# EAGLE schematic main (EAGLE 8.0.0), part 1 of 4

## Sheet 1 of 48: Booth Encoder 0, 1
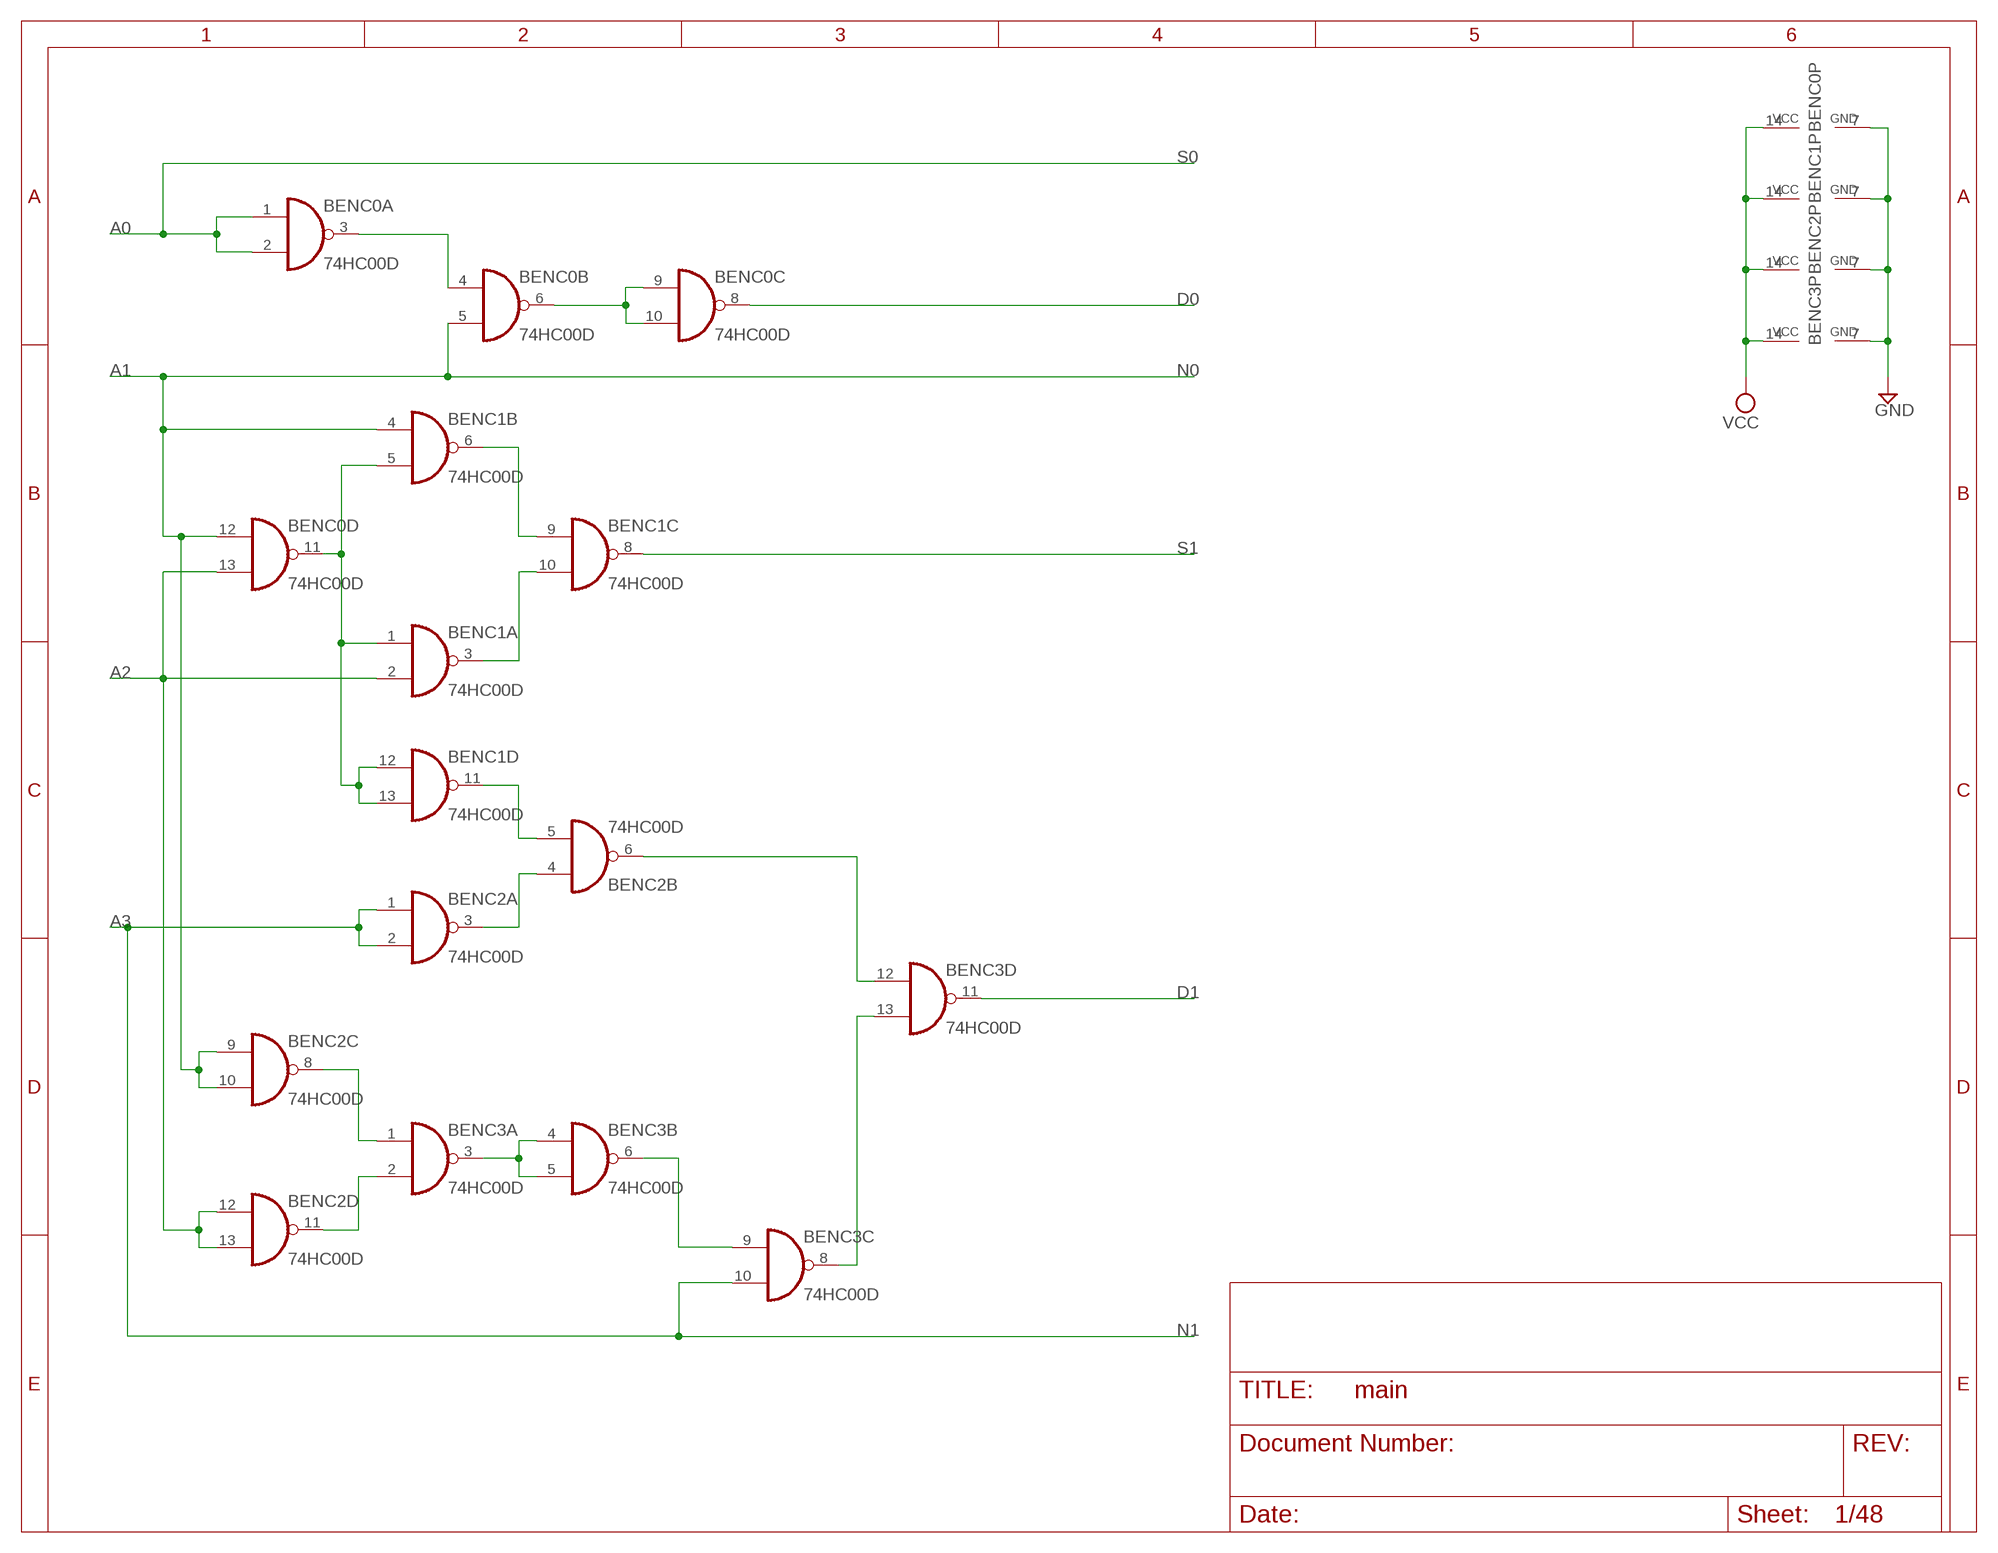
[diagram p0: schematic, sheet 1]

### Parts
BENC0  74HC00D  [SO14]
BENC1  74HC00D  [SO14]
BENC2  74HC00D  [SO14]
BENC3  74HC00D  [SO14]

### Nets
A0: BENC0.1(A:I0) BENC0.2(A:I1) ; also sheet 3,4,11,24,25,26,30,34,41
A1: BENC0.5(B:I1) BENC0.12(D:I0) BENC1.4(B:I0) BENC2.9(C:I0) BENC2.10(C:I1) ; also sheet 3,4,11,19,24,25,26,30,34,41
A2: BENC0.13(D:I1) BENC1.2(A:I1) BENC2.12(D:I0) BENC2.13(D:I1) ; also sheet 24,25,26,30,34,41
A3: BENC2.1(A:I0) BENC2.2(A:I1) BENC3.10(C:I1) ; also sheet 2,5,6,11,22,24,25,26,30,34,41
D0: BENC0.8(C:O) ; also sheet 3,4
D1: BENC3.11(D:O) ; also sheet 5,6
GND: BENC0.7(P:GND) BENC1.7(P:GND) BENC2.7(P:GND) BENC3.7(P:GND) ; also sheet 2,3,4,5,6,7,8,9,10,11,12,13,14,15,16,17,18,19,20,21,22,23,24,25,26,27,28,29,30,31,32,33,34,37,38,39,40,41,42,43,44,45,46,47
N$1: BENC0.3(A:O) BENC0.4(B:I0)
N$2: BENC0.6(B:O) BENC0.9(C:I0) BENC0.10(C:I1)
N$3: BENC2.6(B:O) BENC3.12(D:I0)
N$5: BENC1.3(A:O) BENC1.10(C:I1)
N$6: BENC1.6(B:O) BENC1.9(C:I0)
N$8: BENC3.8(C:O) BENC3.13(D:I1)
N$11: BENC2.3(A:O) BENC2.4(B:I0)
N$12: BENC1.11(D:O) BENC2.5(B:I1)
N$14: BENC2.11(D:O) BENC3.2(A:I1)
N$15: BENC2.8(C:O) BENC3.1(A:I0)
N$16: BENC3.3(A:O) BENC3.4(B:I0) BENC3.5(B:I1)
N$17: BENC3.6(B:O) BENC3.9(C:I0)
N$19: BENC0.11(D:O) BENC1.1(A:I0) BENC1.5(B:I1) BENC1.12(D:I0) BENC1.13(D:I1)
S1: BENC1.8(C:O) ; also sheet 5,6,11
VCC: BENC0.14(P:VCC) BENC1.14(P:VCC) BENC2.14(P:VCC) BENC3.14(P:VCC) ; also sheet 2,3,4,5,6,7,8,9,10,11,12,13,14,15,16,17,18,19,20,21,22,23,24,25,26,27,28,29,30,31,32,33,34,37,38,39,40,41,42,43,44,45,46,47

### Notes on the sheet
- S0
- N0
- N1

## Sheet 2 of 48: Booth Encoder 2, 3
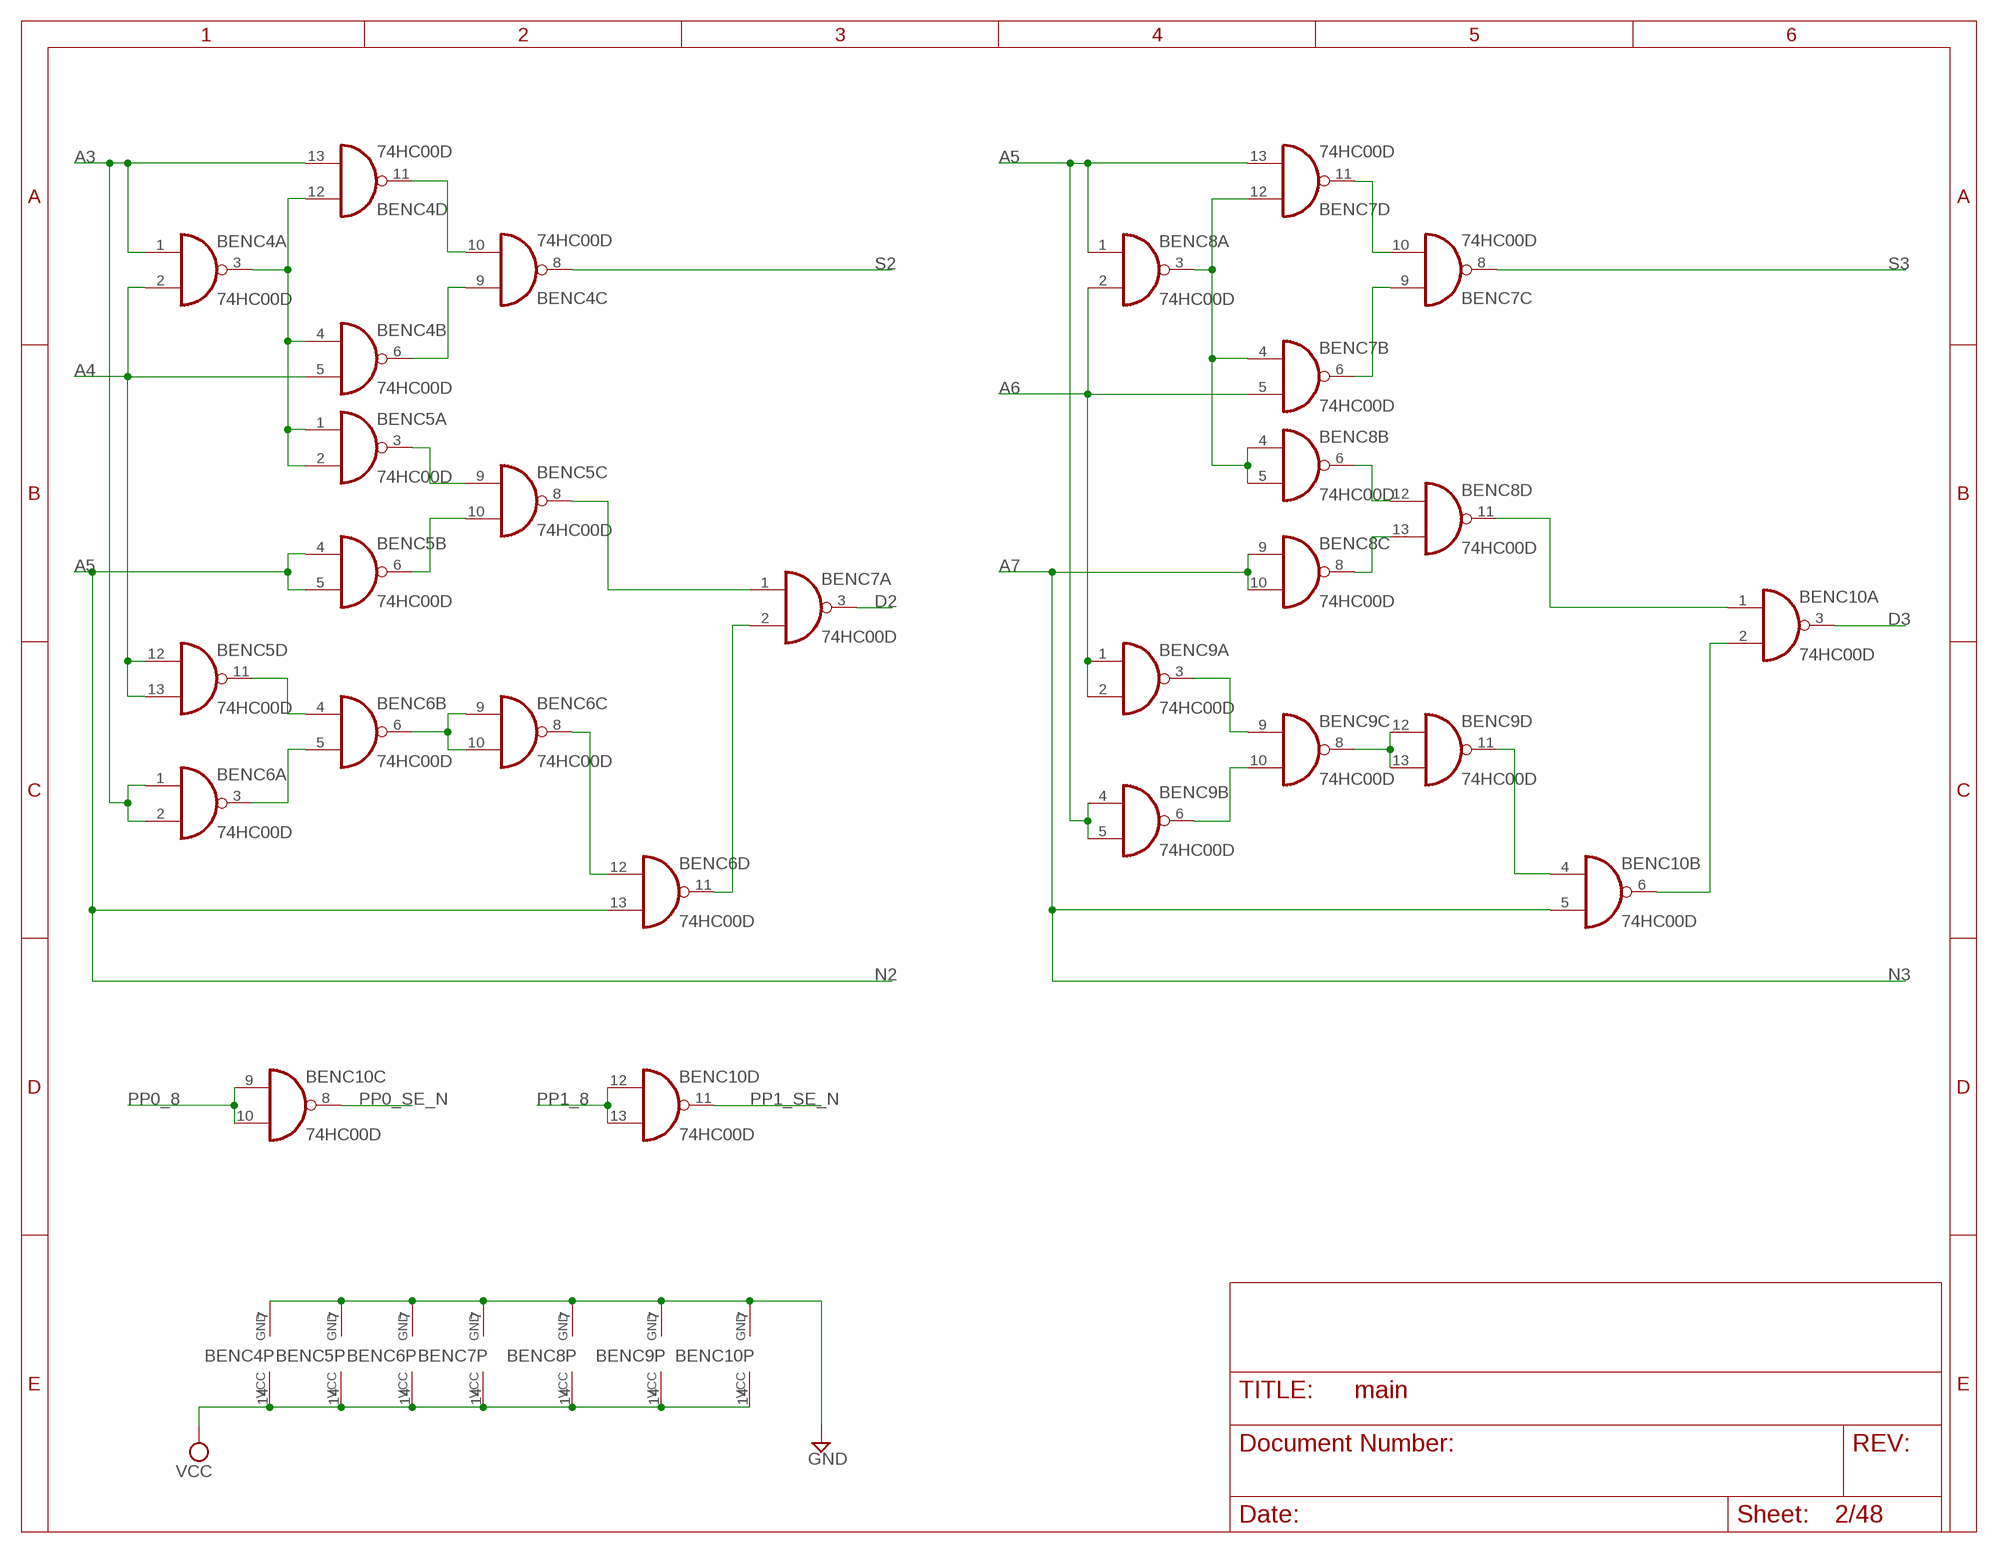
[diagram p1: schematic, sheet 2]

### Parts
BENC4  74HC00D  [SO14]
BENC5  74HC00D  [SO14]
BENC6  74HC00D  [SO14]
BENC7  74HC00D  [SO14]
BENC8  74HC00D  [SO14]
BENC9  74HC00D  [SO14]
BENC10  74HC00D  [SO14]

### Nets
A3: BENC4.1(A:I0) BENC4.13(D:I1) BENC6.1(A:I0) BENC6.2(A:I1) ; also sheet 1,5,6,11,22,24,25,26,30,34,41
A4: BENC4.2(A:I1) BENC4.5(B:I1) BENC5.12(D:I0) BENC5.13(D:I1) ; also sheet 24,25,27,30,34,40
A5: BENC5.4(B:I0) BENC5.5(B:I1) BENC6.13(D:I1) BENC7.13(D:I1) BENC8.1(A:I0) BENC9.4(B:I0) BENC9.5(B:I1) ; also sheet 7,8,11,16,24,25,27,30,34,40
A6: BENC7.5(B:I1) BENC8.2(A:I1) BENC9.1(A:I0) BENC9.2(A:I1) ; also sheet 24,25,27,30,34,40
A7: BENC8.9(C:I0) BENC8.10(C:I1) BENC10.5(B:I1) ; also sheet 9,10,11,15,24,25,27,30,34,40
D2: BENC7.3(A:O) ; also sheet 7,8
D3: BENC10.3(A:O) ; also sheet 9,10
GND: BENC4.7(P:GND) BENC5.7(P:GND) BENC6.7(P:GND) BENC7.7(P:GND) BENC8.7(P:GND) BENC9.7(P:GND) BENC10.7(P:GND) ; also sheet 1,3,4,5,6,7,8,9,10,11,12,13,14,15,16,17,18,19,20,21,22,23,24,25,26,27,28,29,30,31,32,33,34,37,38,39,40,41,42,43,44,45,46,47
N$4: BENC4.3(A:O) BENC4.4(B:I0) BENC4.12(D:I0) BENC5.1(A:I0) BENC5.2(A:I1)
N$7: BENC4.6(B:O) BENC4.9(C:I0)
N$9: BENC4.10(C:I1) BENC4.11(D:O)
N$18: BENC6.11(D:O) BENC7.2(A:I1)
N$20: BENC5.3(A:O) BENC5.9(C:I0)
N$21: BENC5.6(B:O) BENC5.10(C:I1)
N$23: BENC5.8(C:O) BENC7.1(A:I0)
N$24: BENC6.6(B:O) BENC6.9(C:I0) BENC6.10(C:I1)
N$25: BENC6.8(C:O) BENC6.12(D:I0)
N$26: BENC5.11(D:O) BENC6.4(B:I0)
N$27: BENC6.3(A:O) BENC6.5(B:I1)
N$35: BENC7.10(C:I1) BENC7.11(D:O)
N$36: BENC7.6(B:O) BENC7.9(C:I0)
N$39: BENC7.4(B:I0) BENC7.12(D:I0) BENC8.3(A:O) BENC8.4(B:I0) BENC8.5(B:I1)
N$41: BENC8.8(C:O) BENC8.13(D:I1)
N$42: BENC8.6(B:O) BENC8.12(D:I0)
N$43: BENC8.11(D:O) BENC10.1(A:I0)
N$44: BENC10.2(A:I1) BENC10.6(B:O)
N$47: BENC9.11(D:O) BENC10.4(B:I0)
N$48: BENC9.8(C:O) BENC9.12(D:I0) BENC9.13(D:I1)
N$49: BENC9.6(B:O) BENC9.10(C:I1)
N$50: BENC9.3(A:O) BENC9.9(C:I0)
PP0_8: BENC10.9(C:I0) BENC10.10(C:I1) ; also sheet 3,12
PP0_SE_N: BENC10.8(C:O) ; also sheet 12
PP1_8: BENC10.12(D:I0) BENC10.13(D:I1) ; also sheet 5,12
PP1_SE_N: BENC10.11(D:O) ; also sheet 12
S2: BENC4.8(C:O) ; also sheet 7,8,11
S3: BENC7.8(C:O) ; also sheet 9,10,11
VCC: BENC4.14(P:VCC) BENC5.14(P:VCC) BENC6.14(P:VCC) BENC7.14(P:VCC) BENC8.14(P:VCC) BENC9.14(P:VCC) BENC10.14(P:VCC) ; also sheet 1,3,4,5,6,7,8,9,10,11,12,13,14,15,16,17,18,19,20,21,22,23,24,25,26,27,28,29,30,31,32,33,34,37,38,39,40,41,42,43,44,45,46,47

### Notes on the sheet
- N2 | N3

## Sheet 3 of 48: Booth Selector 0, 8-5
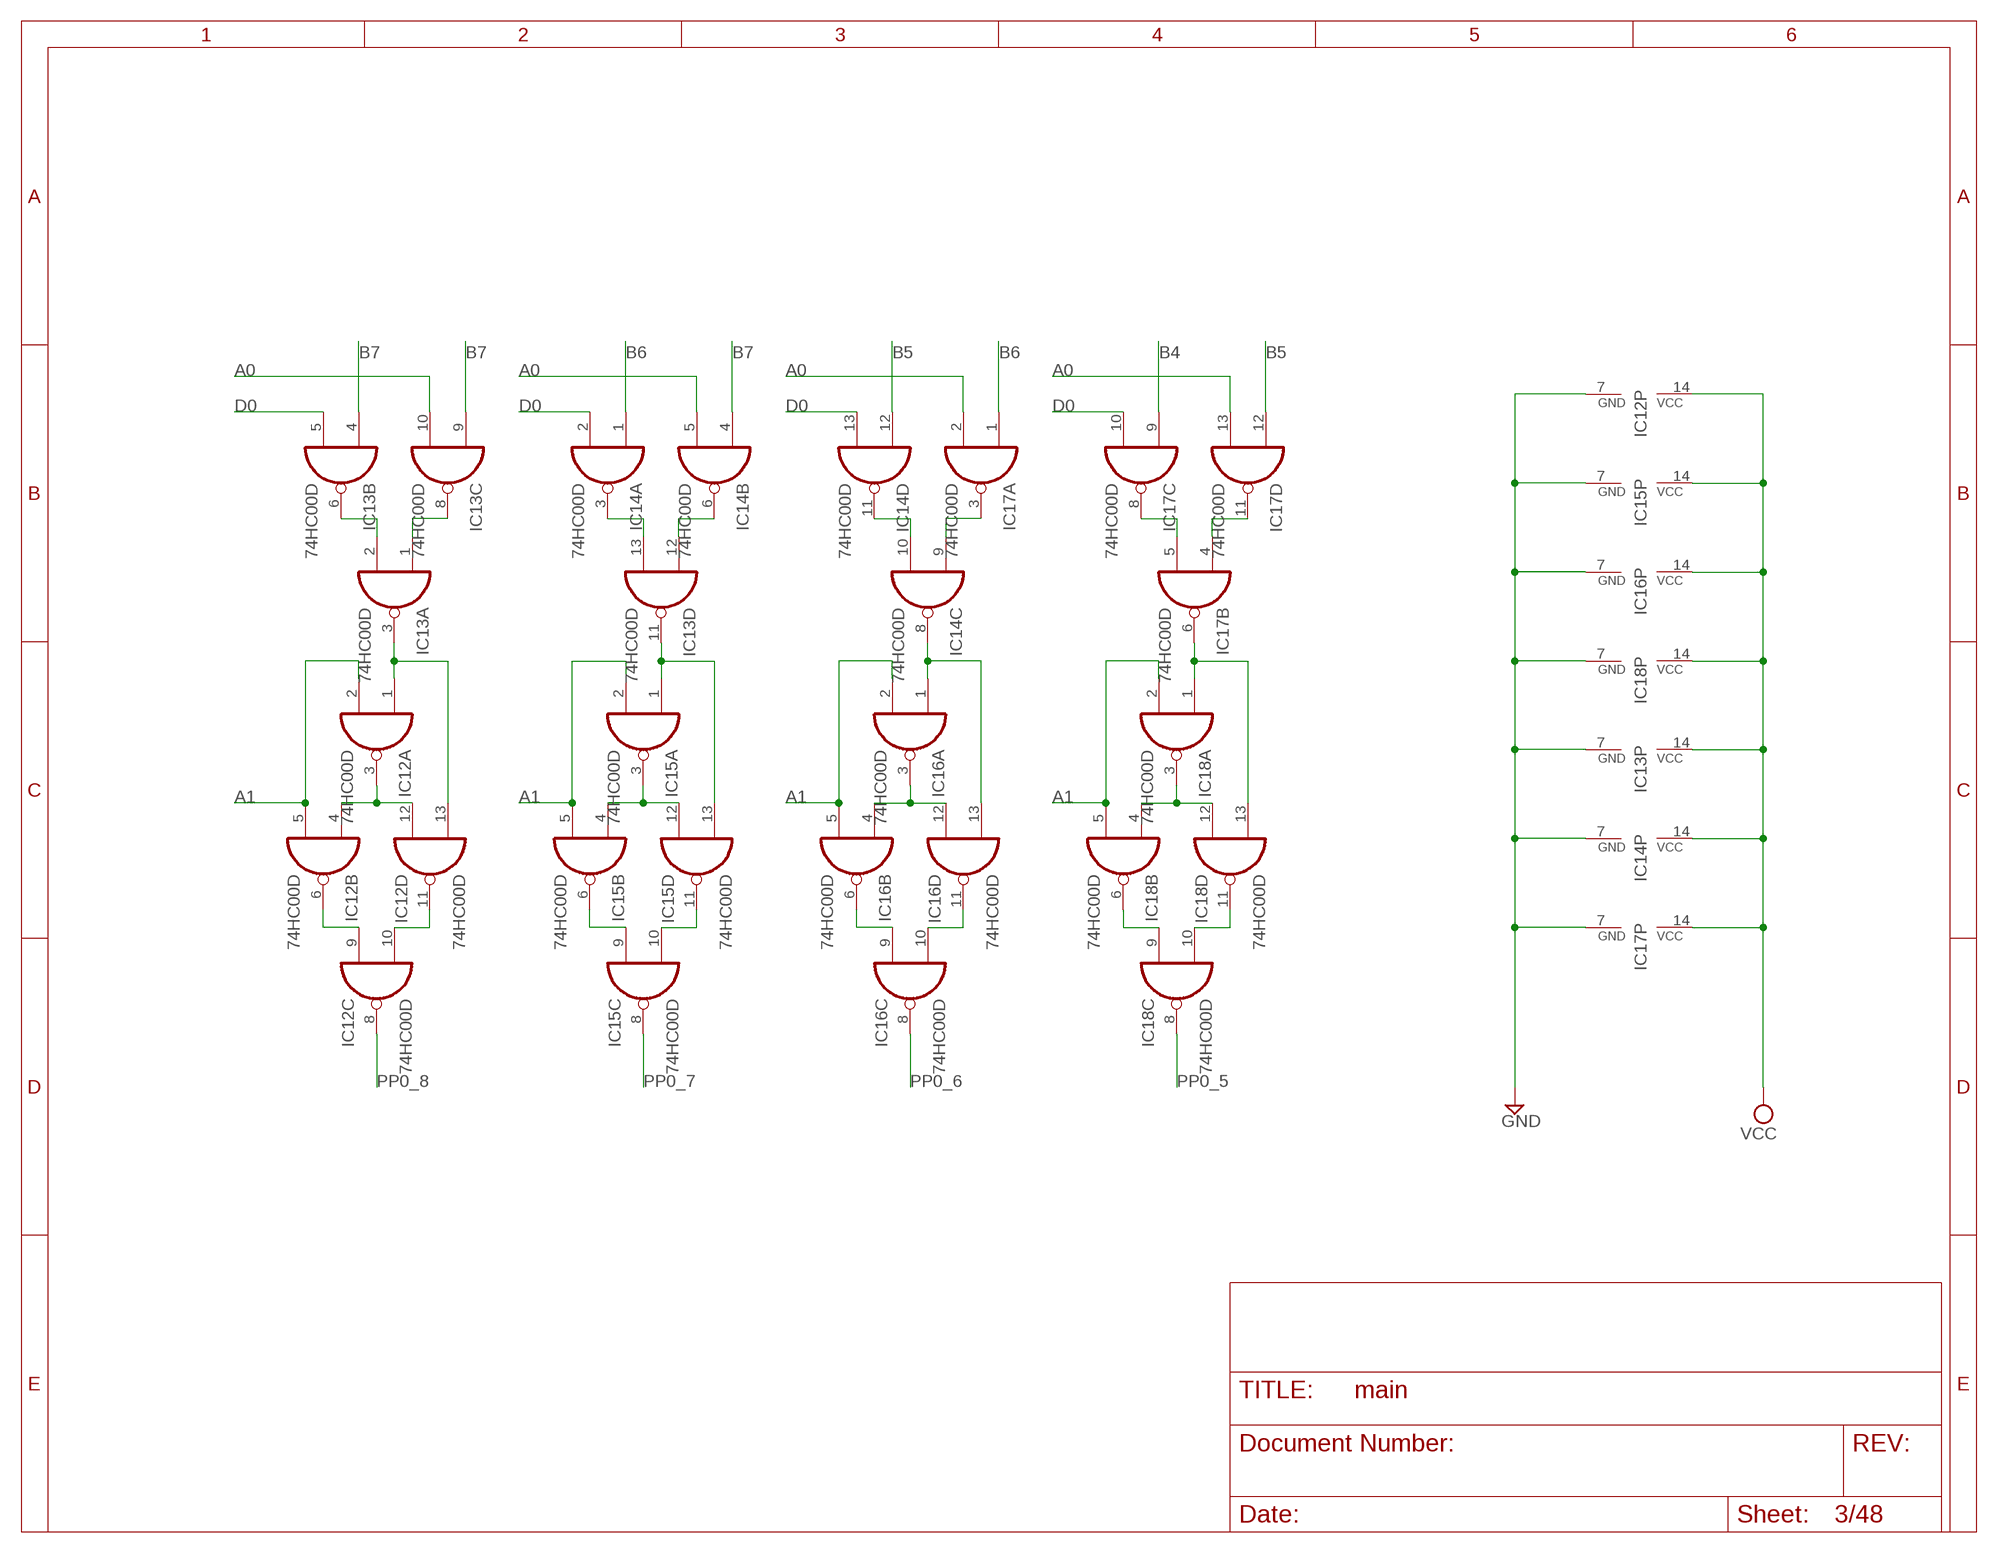
[diagram p2: schematic, sheet 3]

### Parts
IC12  74HC00D  [SO14]
IC13  74HC00D  [SO14]
IC14  74HC00D  [SO14]
IC15  74HC00D  [SO14]
IC16  74HC00D  [SO14]
IC17  74HC00D  [SO14]
IC18  74HC00D  [SO14]

### Nets
A0: IC13.10(C:I1) IC14.5(B:I1) IC17.2(A:I1) IC17.13(D:I1) ; also sheet 1,4,11,24,25,26,30,34,41
A1: IC12.2(A:I1) IC12.5(B:I1) IC15.2(A:I1) IC15.5(B:I1) IC16.2(A:I1) IC16.5(B:I1) IC18.2(A:I1) IC18.5(B:I1) ; also sheet 1,4,11,19,24,25,26,30,34,41
B4: IC17.9(C:I0) ; also sheet 4,5,6,7,8,9,10,24,25,27,34,42
B5: IC14.12(D:I0) IC17.12(D:I0) ; also sheet 5,7,9,24,25,27,34,42
B6: IC14.1(A:I0) IC17.1(A:I0) ; also sheet 5,7,9,24,25,27,34,42
B7: IC13.4(B:I0) IC13.9(C:I0) IC14.4(B:I0) ; also sheet 5,7,9,24,25,27,34,42
D0: IC13.5(B:I1) IC14.2(A:I1) IC14.13(D:I1) IC17.10(C:I1) ; also sheet 1,4
GND: IC12.7(P:GND) IC13.7(P:GND) IC14.7(P:GND) IC15.7(P:GND) IC16.7(P:GND) IC17.7(P:GND) IC18.7(P:GND) ; also sheet 1,2,4,5,6,7,8,9,10,11,12,13,14,15,16,17,18,19,20,21,22,23,24,25,26,27,28,29,30,31,32,33,34,37,38,39,40,41,42,43,44,45,46,47
N$88: IC12.6(B:O) IC12.9(C:I0)
N$89: IC12.10(C:I1) IC12.11(D:O)
N$90: IC12.3(A:O) IC12.4(B:I0) IC12.12(D:I0)
N$91: IC15.6(B:O) IC15.9(C:I0)
N$92: IC15.10(C:I1) IC15.11(D:O)
N$93: IC15.3(A:O) IC15.4(B:I0) IC15.12(D:I0)
N$94: IC16.3(A:O) IC16.4(B:I0) IC16.12(D:I0)
N$95: IC16.10(C:I1) IC16.11(D:O)
N$96: IC16.6(B:O) IC16.9(C:I0)
N$97: IC13.11(D:O) IC15.1(A:I0) IC15.13(D:I1)
N$98: IC13.13(D:I1) IC14.3(A:O)
N$99: IC13.12(D:I0) IC14.6(B:O)
N$100: IC13.1(A:I0) IC13.8(C:O)
N$101: IC13.2(A:I1) IC13.6(B:O)
N$102: IC14.10(C:I1) IC14.11(D:O)
N$103: IC14.9(C:I0) IC17.3(A:O)
N$104: IC17.5(B:I1) IC17.8(C:O)
N$105: IC17.4(B:I0) IC17.11(D:O)
N$106: IC17.6(B:O) IC18.1(A:I0) IC18.13(D:I1)
N$107: IC14.8(C:O) IC16.1(A:I0) IC16.13(D:I1)
N$108: IC12.1(A:I0) IC12.13(D:I1) IC13.3(A:O)
N$109: IC18.3(A:O) IC18.4(B:I0) IC18.12(D:I0)
N$110: IC18.6(B:O) IC18.9(C:I0)
N$111: IC18.10(C:I1) IC18.11(D:O)
PP0_5: IC18.8(C:O) ; also sheet 13
PP0_6: IC16.8(C:O) ; also sheet 13
PP0_7: IC15.8(C:O) ; also sheet 13
PP0_8: IC12.8(C:O) ; also sheet 2,12
VCC: IC12.14(P:VCC) IC13.14(P:VCC) IC14.14(P:VCC) IC15.14(P:VCC) IC16.14(P:VCC) IC17.14(P:VCC) IC18.14(P:VCC) ; also sheet 1,2,4,5,6,7,8,9,10,11,12,13,14,15,16,17,18,19,20,21,22,23,24,25,26,27,28,29,30,31,32,33,34,37,38,39,40,41,42,43,44,45,46,47

## Sheet 4 of 48: Booth Selector 0, 4-1
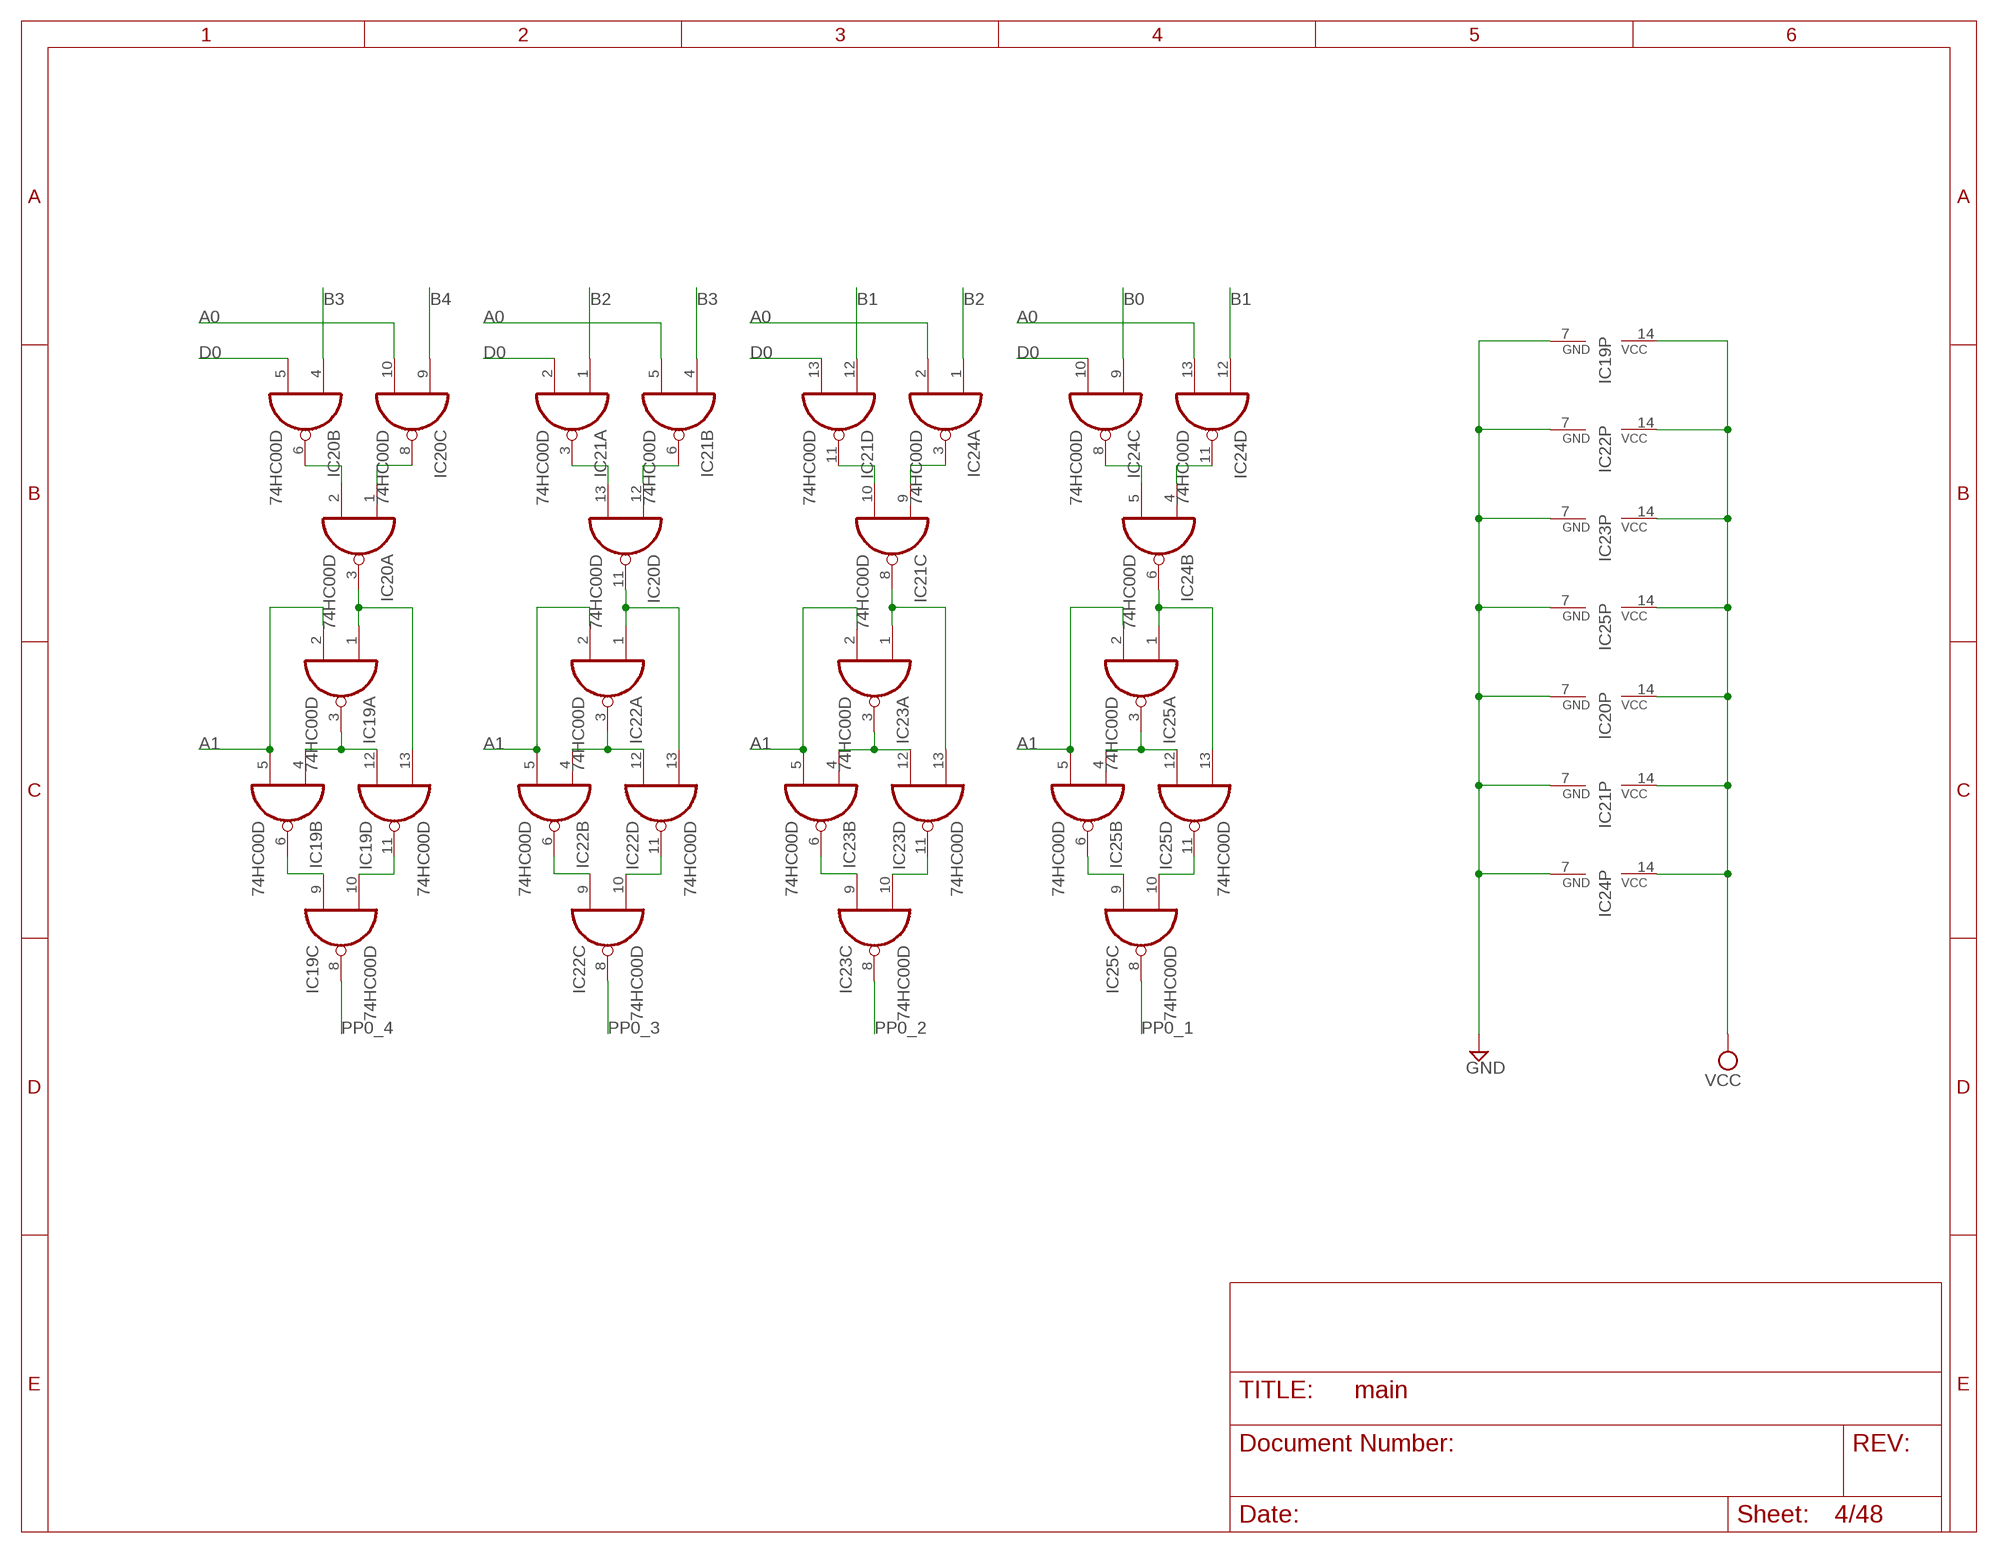
[diagram p3: schematic, sheet 4]

### Parts
IC19  74HC00D  [SO14]
IC20  74HC00D  [SO14]
IC21  74HC00D  [SO14]
IC22  74HC00D  [SO14]
IC23  74HC00D  [SO14]
IC24  74HC00D  [SO14]
IC25  74HC00D  [SO14]

### Nets
A0: IC20.10(C:I1) IC21.5(B:I1) IC24.2(A:I1) IC24.13(D:I1) ; also sheet 1,3,11,24,25,26,30,34,41
A1: IC19.2(A:I1) IC19.5(B:I1) IC22.2(A:I1) IC22.5(B:I1) IC23.2(A:I1) IC23.5(B:I1) IC25.2(A:I1) IC25.5(B:I1) ; also sheet 1,3,11,19,24,25,26,30,34,41
B0: IC24.9(C:I0) ; also sheet 6,8,10,11,24,25,26,34,43
B1: IC21.12(D:I0) IC24.12(D:I0) ; also sheet 6,8,10,24,25,26,34,43
B2: IC21.1(A:I0) IC24.1(A:I0) ; also sheet 6,8,10,24,25,26,34,43
B3: IC20.4(B:I0) IC21.4(B:I0) ; also sheet 6,8,10,24,25,26,34,43
B4: IC20.9(C:I0) ; also sheet 3,5,6,7,8,9,10,24,25,27,34,42
D0: IC20.5(B:I1) IC21.2(A:I1) IC21.13(D:I1) IC24.10(C:I1) ; also sheet 1,3
GND: IC19.7(P:GND) IC20.7(P:GND) IC21.7(P:GND) IC22.7(P:GND) IC23.7(P:GND) IC24.7(P:GND) IC25.7(P:GND) ; also sheet 1,2,3,5,6,7,8,9,10,11,12,13,14,15,16,17,18,19,20,21,22,23,24,25,26,27,28,29,30,31,32,33,34,37,38,39,40,41,42,43,44,45,46,47
N$112: IC19.6(B:O) IC19.9(C:I0)
N$113: IC19.10(C:I1) IC19.11(D:O)
N$114: IC19.3(A:O) IC19.4(B:I0) IC19.12(D:I0)
N$115: IC22.6(B:O) IC22.9(C:I0)
N$116: IC22.10(C:I1) IC22.11(D:O)
N$117: IC22.3(A:O) IC22.4(B:I0) IC22.12(D:I0)
N$118: IC23.3(A:O) IC23.4(B:I0) IC23.12(D:I0)
N$119: IC23.10(C:I1) IC23.11(D:O)
N$120: IC23.6(B:O) IC23.9(C:I0)
N$121: IC20.11(D:O) IC22.1(A:I0) IC22.13(D:I1)
N$122: IC20.13(D:I1) IC21.3(A:O)
N$123: IC20.12(D:I0) IC21.6(B:O)
N$124: IC20.1(A:I0) IC20.8(C:O)
N$125: IC20.2(A:I1) IC20.6(B:O)
N$126: IC21.10(C:I1) IC21.11(D:O)
N$127: IC21.9(C:I0) IC24.3(A:O)
N$128: IC24.5(B:I1) IC24.8(C:O)
N$129: IC24.4(B:I0) IC24.11(D:O)
N$130: IC24.6(B:O) IC25.1(A:I0) IC25.13(D:I1)
N$131: IC21.8(C:O) IC23.1(A:I0) IC23.13(D:I1)
N$132: IC19.1(A:I0) IC19.13(D:I1) IC20.3(A:O)
N$133: IC25.3(A:O) IC25.4(B:I0) IC25.12(D:I0)
N$134: IC25.6(B:O) IC25.9(C:I0)
N$135: IC25.10(C:I1) IC25.11(D:O)
PP0_1: IC25.8(C:O) ; also sheet 19,23
PP0_2: IC23.8(C:O) ; also sheet 16
PP0_3: IC22.8(C:O) ; also sheet 16
PP0_4: IC19.8(C:O) ; also sheet 13
VCC: IC19.14(P:VCC) IC20.14(P:VCC) IC21.14(P:VCC) IC22.14(P:VCC) IC23.14(P:VCC) IC24.14(P:VCC) IC25.14(P:VCC) ; also sheet 1,2,3,5,6,7,8,9,10,11,12,13,14,15,16,17,18,19,20,21,22,23,24,25,26,27,28,29,30,31,32,33,34,37,38,39,40,41,42,43,44,45,46,47

## Sheet 5 of 48: Booth Selector 1, 8-5
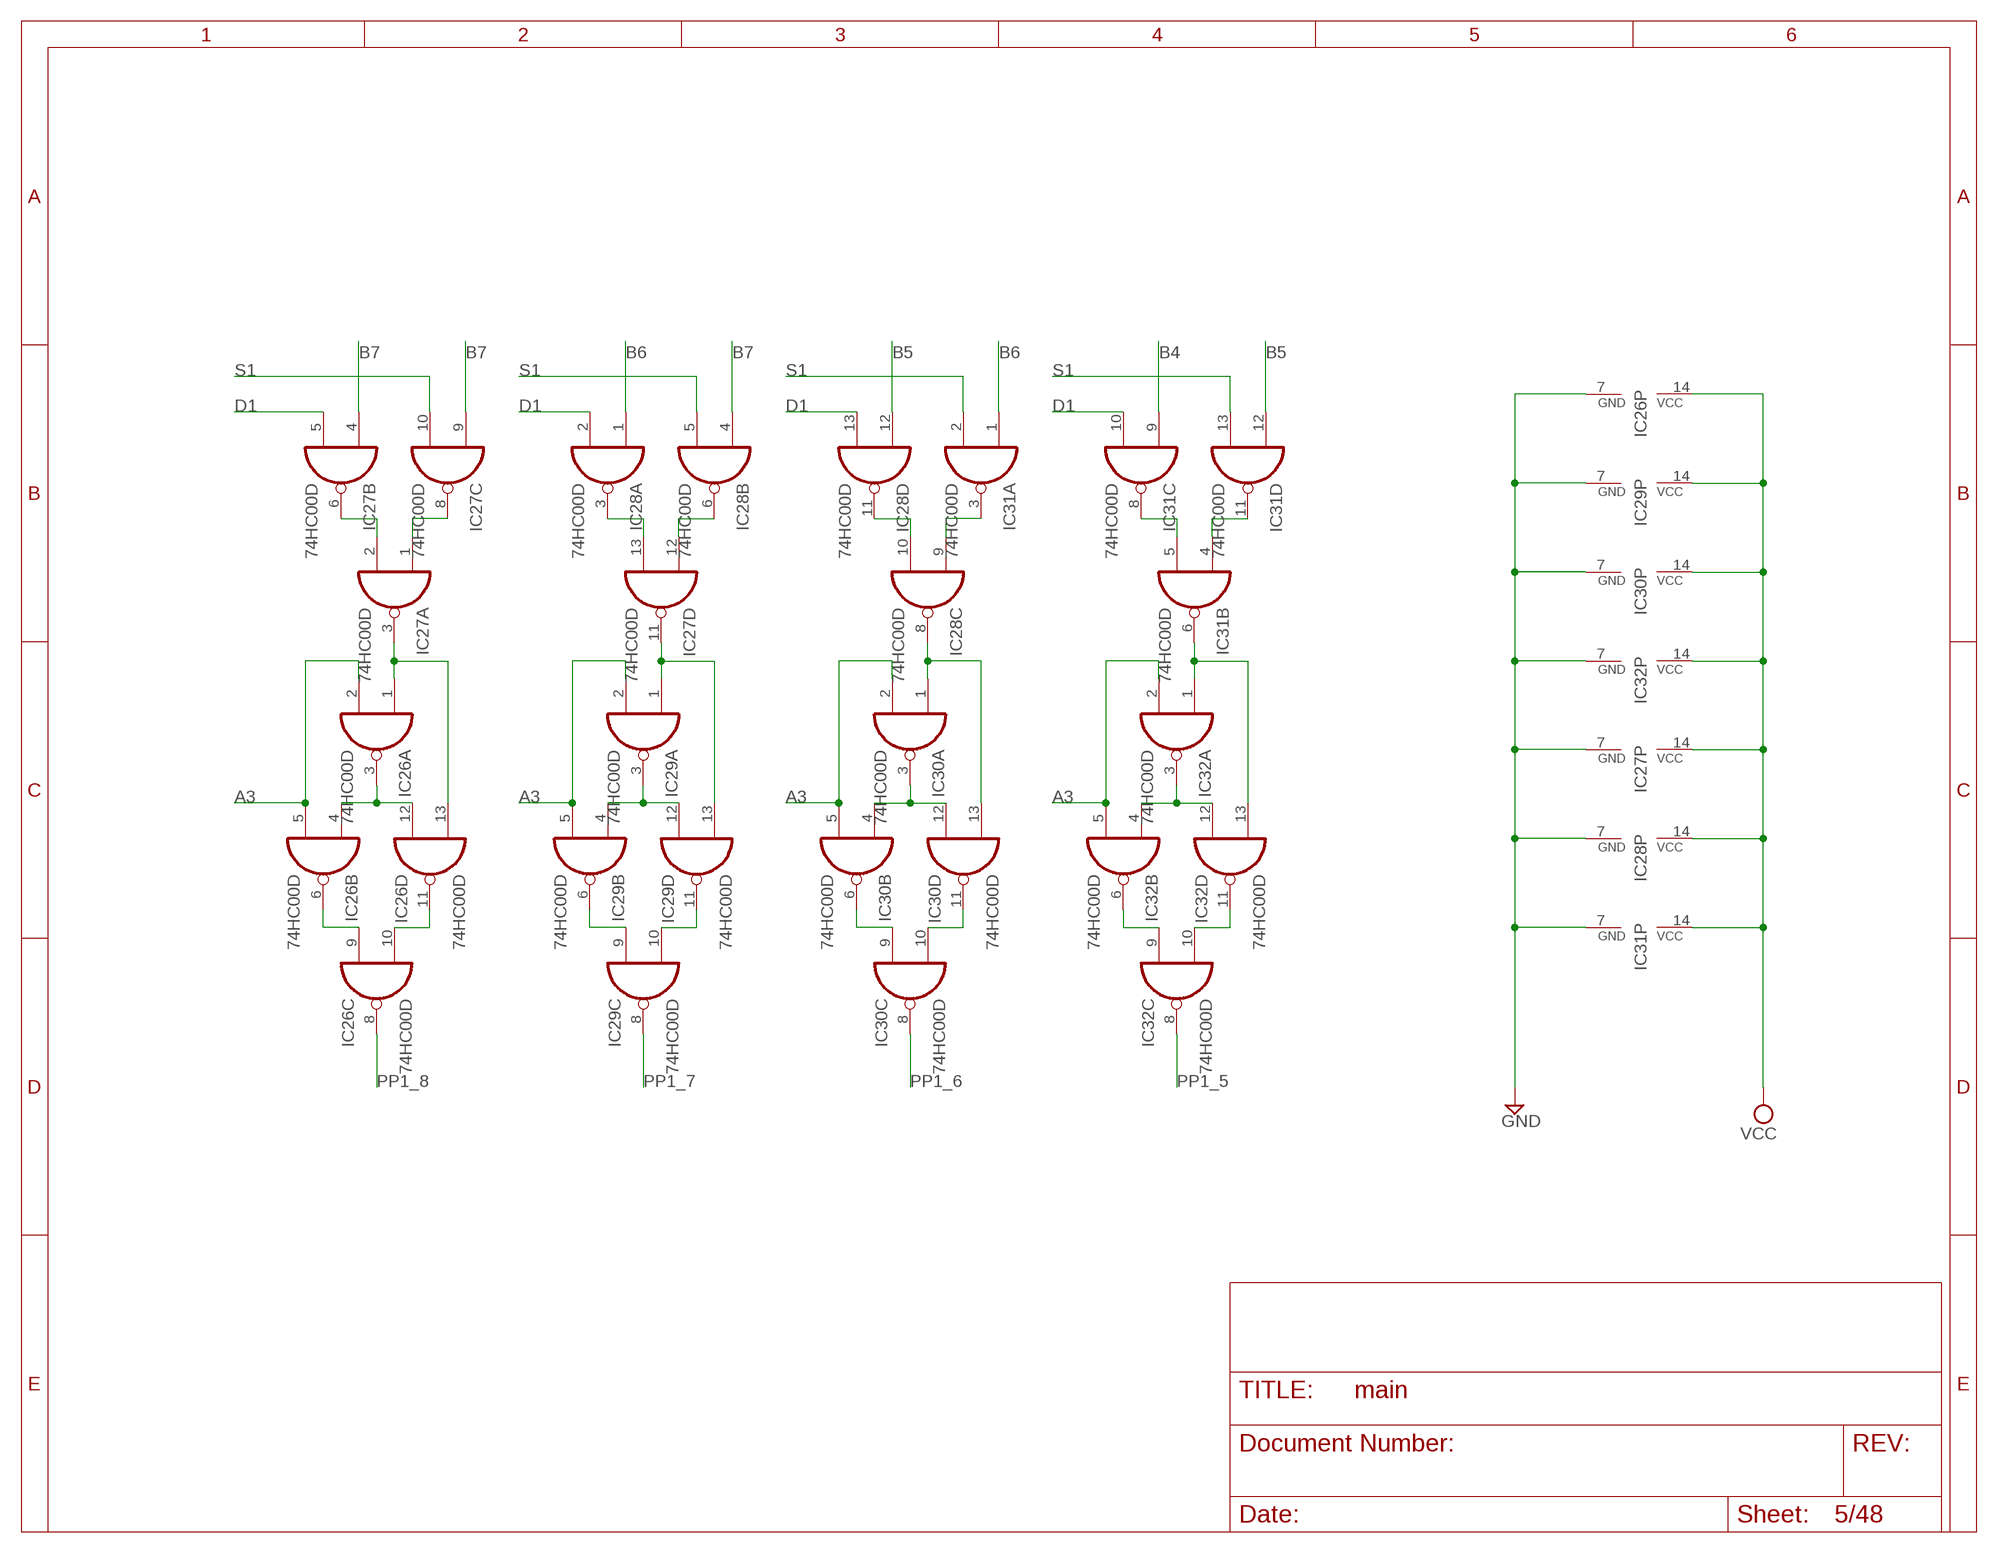
[diagram p4: schematic, sheet 5]

### Parts
IC26  74HC00D  [SO14]
IC27  74HC00D  [SO14]
IC28  74HC00D  [SO14]
IC29  74HC00D  [SO14]
IC30  74HC00D  [SO14]
IC31  74HC00D  [SO14]
IC32  74HC00D  [SO14]

### Nets
A3: IC26.2(A:I1) IC26.5(B:I1) IC29.2(A:I1) IC29.5(B:I1) IC30.2(A:I1) IC30.5(B:I1) IC32.2(A:I1) IC32.5(B:I1) ; also sheet 1,2,6,11,22,24,25,26,30,34,41
B4: IC31.9(C:I0) ; also sheet 3,4,6,7,8,9,10,24,25,27,34,42
B5: IC28.12(D:I0) IC31.12(D:I0) ; also sheet 3,7,9,24,25,27,34,42
B6: IC28.1(A:I0) IC31.1(A:I0) ; also sheet 3,7,9,24,25,27,34,42
B7: IC27.4(B:I0) IC27.9(C:I0) IC28.4(B:I0) ; also sheet 3,7,9,24,25,27,34,42
D1: IC27.5(B:I1) IC28.2(A:I1) IC28.13(D:I1) IC31.10(C:I1) ; also sheet 1,6
GND: IC26.7(P:GND) IC27.7(P:GND) IC28.7(P:GND) IC29.7(P:GND) IC30.7(P:GND) IC31.7(P:GND) IC32.7(P:GND) ; also sheet 1,2,3,4,6,7,8,9,10,11,12,13,14,15,16,17,18,19,20,21,22,23,24,25,26,27,28,29,30,31,32,33,34,37,38,39,40,41,42,43,44,45,46,47
N$22: IC26.6(B:O) IC26.9(C:I0)
N$28: IC26.10(C:I1) IC26.11(D:O)
N$29: IC26.3(A:O) IC26.4(B:I0) IC26.12(D:I0)
N$30: IC29.6(B:O) IC29.9(C:I0)
N$31: IC29.10(C:I1) IC29.11(D:O)
N$34: IC29.3(A:O) IC29.4(B:I0) IC29.12(D:I0)
N$37: IC30.3(A:O) IC30.4(B:I0) IC30.12(D:I0)
N$38: IC30.10(C:I1) IC30.11(D:O)
N$40: IC30.6(B:O) IC30.9(C:I0)
N$45: IC27.11(D:O) IC29.1(A:I0) IC29.13(D:I1)
N$46: IC27.13(D:I1) IC28.3(A:O)
N$51: IC27.12(D:I0) IC28.6(B:O)
N$52: IC27.1(A:I0) IC27.8(C:O)
N$53: IC27.2(A:I1) IC27.6(B:O)
N$54: IC28.10(C:I1) IC28.11(D:O)
N$55: IC28.9(C:I0) IC31.3(A:O)
N$56: IC31.5(B:I1) IC31.8(C:O)
N$57: IC31.4(B:I0) IC31.11(D:O)
N$58: IC31.6(B:O) IC32.1(A:I0) IC32.13(D:I1)
N$59: IC28.8(C:O) IC30.1(A:I0) IC30.13(D:I1)
N$60: IC26.1(A:I0) IC26.13(D:I1) IC27.3(A:O)
N$62: IC32.3(A:O) IC32.4(B:I0) IC32.12(D:I0)
N$63: IC32.6(B:O) IC32.9(C:I0)
N$64: IC32.10(C:I1) IC32.11(D:O)
PP1_5: IC32.8(C:O) ; also sheet 13
PP1_6: IC30.8(C:O) ; also sheet 12
PP1_7: IC29.8(C:O) ; also sheet 12
PP1_8: IC26.8(C:O) ; also sheet 2,12
S1: IC27.10(C:I1) IC28.5(B:I1) IC31.2(A:I1) IC31.13(D:I1) ; also sheet 1,6,11
VCC: IC26.14(P:VCC) IC27.14(P:VCC) IC28.14(P:VCC) IC29.14(P:VCC) IC30.14(P:VCC) IC31.14(P:VCC) IC32.14(P:VCC) ; also sheet 1,2,3,4,6,7,8,9,10,11,12,13,14,15,16,17,18,19,20,21,22,23,24,25,26,27,28,29,30,31,32,33,34,37,38,39,40,41,42,43,44,45,46,47

## Sheet 6 of 48: Booth Selector 1, 4-1
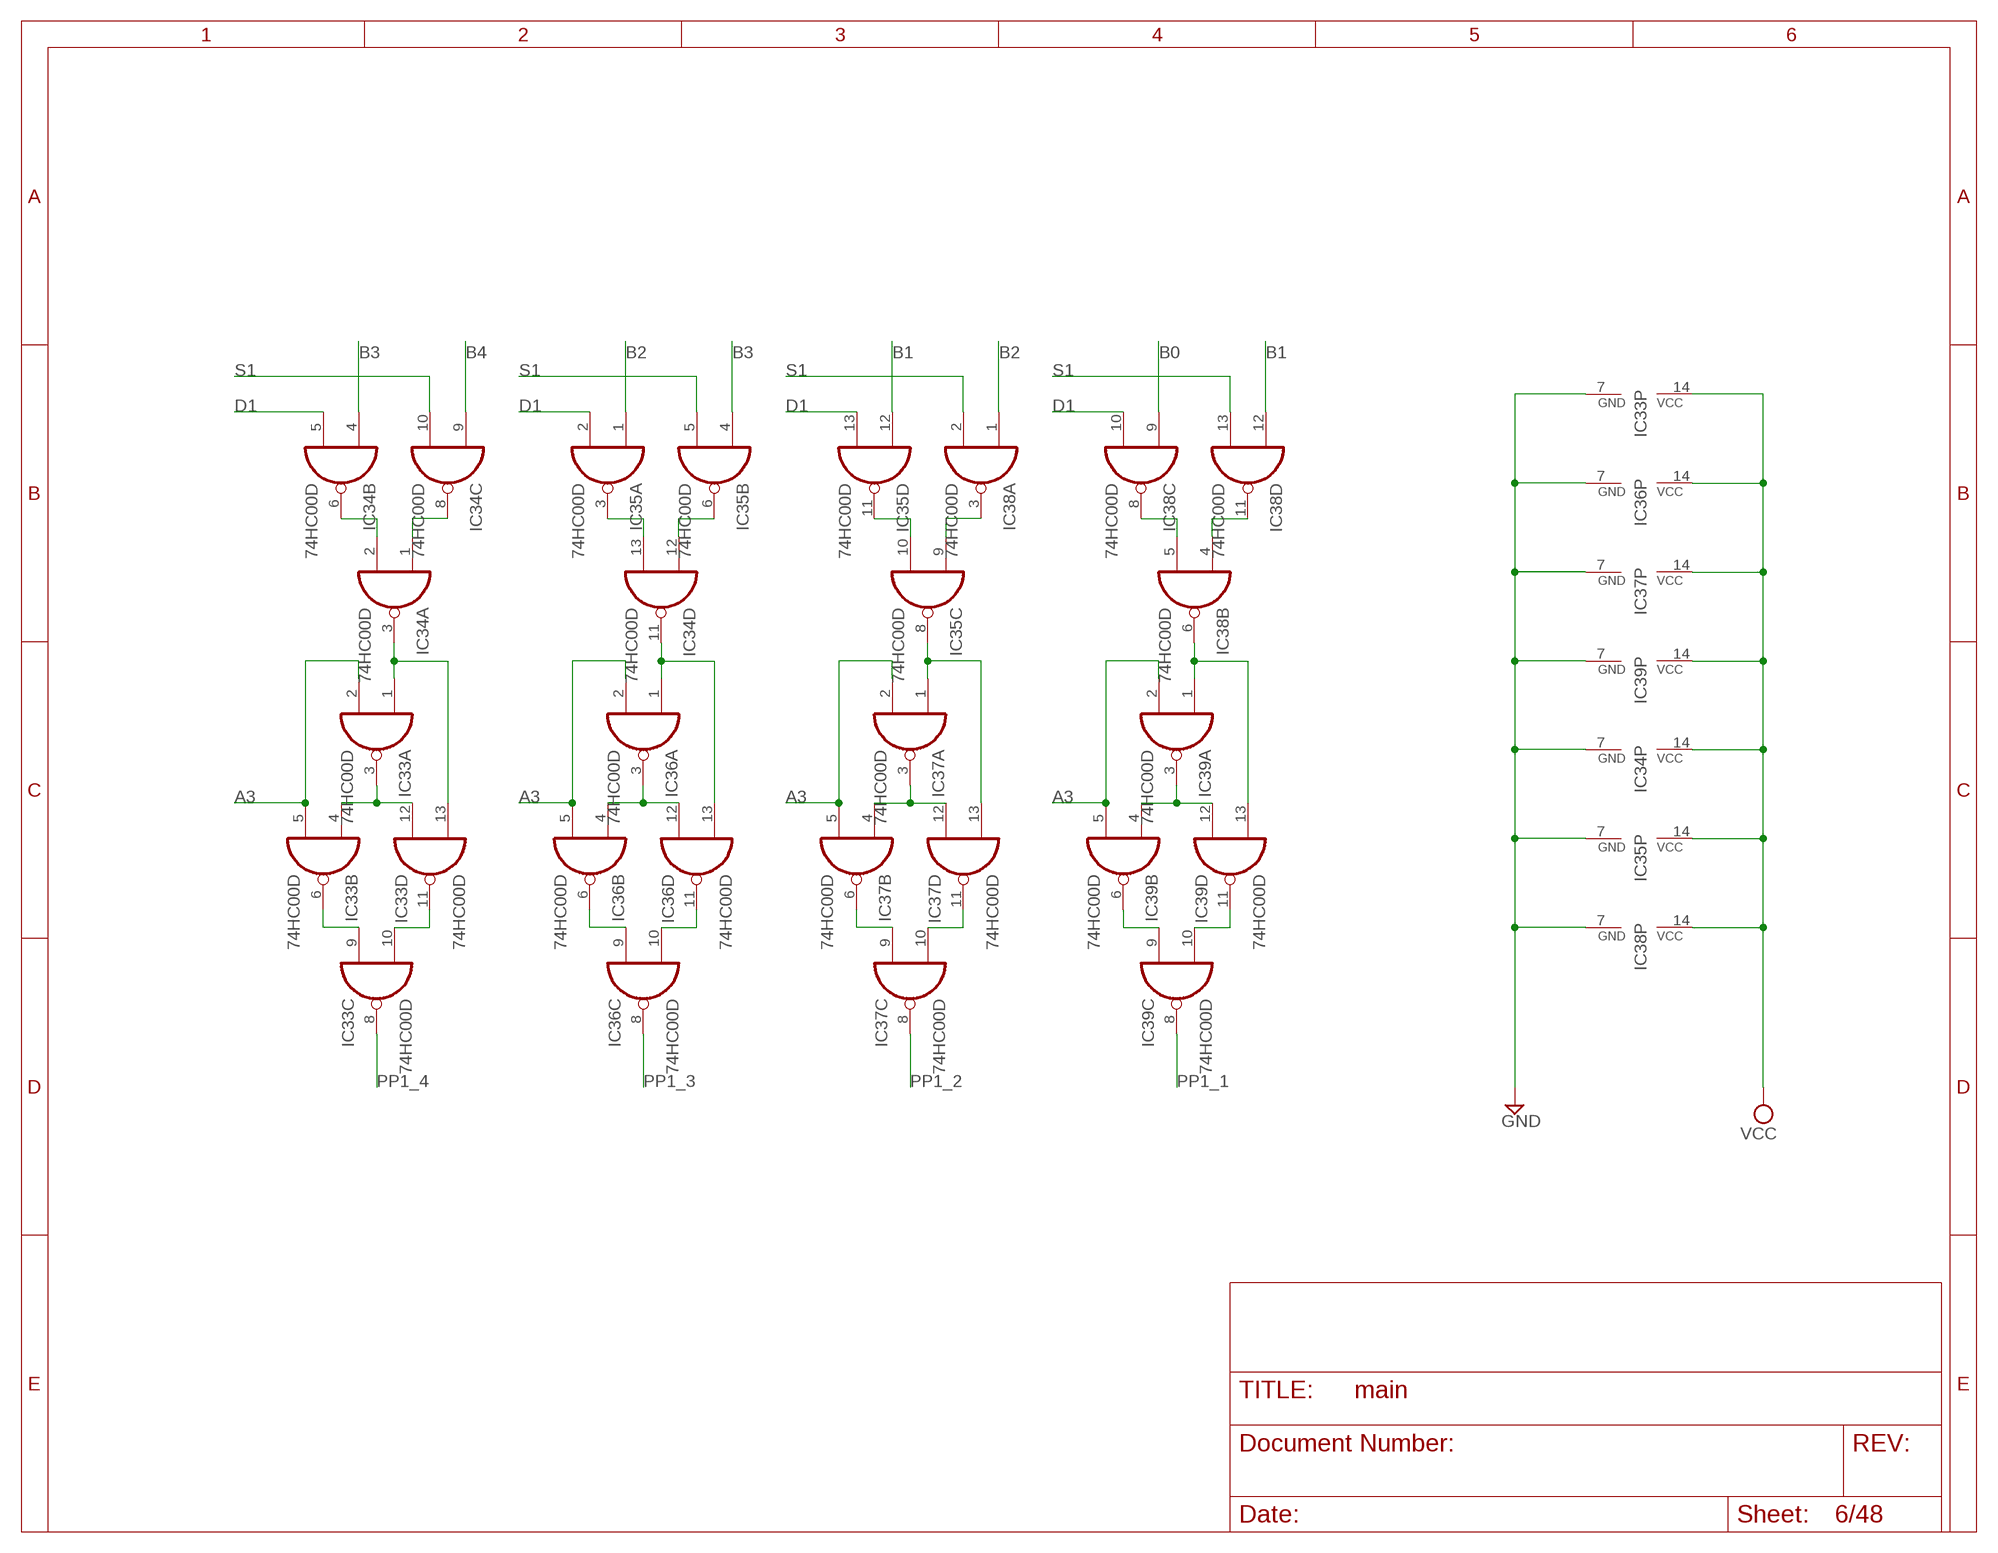
[diagram p5: schematic, sheet 6]

### Parts
IC33  74HC00D  [SO14]
IC34  74HC00D  [SO14]
IC35  74HC00D  [SO14]
IC36  74HC00D  [SO14]
IC37  74HC00D  [SO14]
IC38  74HC00D  [SO14]
IC39  74HC00D  [SO14]

### Nets
A3: IC33.2(A:I1) IC33.5(B:I1) IC36.2(A:I1) IC36.5(B:I1) IC37.2(A:I1) IC37.5(B:I1) IC39.2(A:I1) IC39.5(B:I1) ; also sheet 1,2,5,11,22,24,25,26,30,34,41
B0: IC38.9(C:I0) ; also sheet 4,8,10,11,24,25,26,34,43
B1: IC35.12(D:I0) IC38.12(D:I0) ; also sheet 4,8,10,24,25,26,34,43
B2: IC35.1(A:I0) IC38.1(A:I0) ; also sheet 4,8,10,24,25,26,34,43
B3: IC34.4(B:I0) IC35.4(B:I0) ; also sheet 4,8,10,24,25,26,34,43
B4: IC34.9(C:I0) ; also sheet 3,4,5,7,8,9,10,24,25,27,34,42
D1: IC34.5(B:I1) IC35.2(A:I1) IC35.13(D:I1) IC38.10(C:I1) ; also sheet 1,5
GND: IC33.7(P:GND) IC34.7(P:GND) IC35.7(P:GND) IC36.7(P:GND) IC37.7(P:GND) IC38.7(P:GND) IC39.7(P:GND) ; also sheet 1,2,3,4,5,7,8,9,10,11,12,13,14,15,16,17,18,19,20,21,22,23,24,25,26,27,28,29,30,31,32,33,34,37,38,39,40,41,42,43,44,45,46,47
N$61: IC33.6(B:O) IC33.9(C:I0)
N$65: IC33.10(C:I1) IC33.11(D:O)
N$66: IC33.3(A:O) IC33.4(B:I0) IC33.12(D:I0)
N$67: IC36.6(B:O) IC36.9(C:I0)
N$68: IC36.10(C:I1) IC36.11(D:O)
N$69: IC36.3(A:O) IC36.4(B:I0) IC36.12(D:I0)
N$70: IC37.3(A:O) IC37.4(B:I0) IC37.12(D:I0)
N$71: IC37.10(C:I1) IC37.11(D:O)
N$72: IC37.6(B:O) IC37.9(C:I0)
N$73: IC34.11(D:O) IC36.1(A:I0) IC36.13(D:I1)
N$74: IC34.13(D:I1) IC35.3(A:O)
N$75: IC34.12(D:I0) IC35.6(B:O)
N$76: IC34.1(A:I0) IC34.8(C:O)
N$77: IC34.2(A:I1) IC34.6(B:O)
N$78: IC35.10(C:I1) IC35.11(D:O)
N$79: IC35.9(C:I0) IC38.3(A:O)
N$80: IC38.5(B:I1) IC38.8(C:O)
N$81: IC38.4(B:I0) IC38.11(D:O)
N$82: IC38.6(B:O) IC39.1(A:I0) IC39.13(D:I1)
N$83: IC35.8(C:O) IC37.1(A:I0) IC37.13(D:I1)
N$84: IC33.1(A:I0) IC33.13(D:I1) IC34.3(A:O)
N$85: IC39.3(A:O) IC39.4(B:I0) IC39.12(D:I0)
N$86: IC39.6(B:O) IC39.9(C:I0)
N$87: IC39.10(C:I1) IC39.11(D:O)
PP1_1: IC39.8(C:O) ; also sheet 16
PP1_2: IC37.8(C:O) ; also sheet 13
PP1_3: IC36.8(C:O) ; also sheet 13
PP1_4: IC33.8(C:O) ; also sheet 13
S1: IC34.10(C:I1) IC35.5(B:I1) IC38.2(A:I1) IC38.13(D:I1) ; also sheet 1,5,11
VCC: IC33.14(P:VCC) IC34.14(P:VCC) IC35.14(P:VCC) IC36.14(P:VCC) IC37.14(P:VCC) IC38.14(P:VCC) IC39.14(P:VCC) ; also sheet 1,2,3,4,5,7,8,9,10,11,12,13,14,15,16,17,18,19,20,21,22,23,24,25,26,27,28,29,30,31,32,33,34,37,38,39,40,41,42,43,44,45,46,47

## Sheet 7 of 48: Booth Selector 2, 8-5
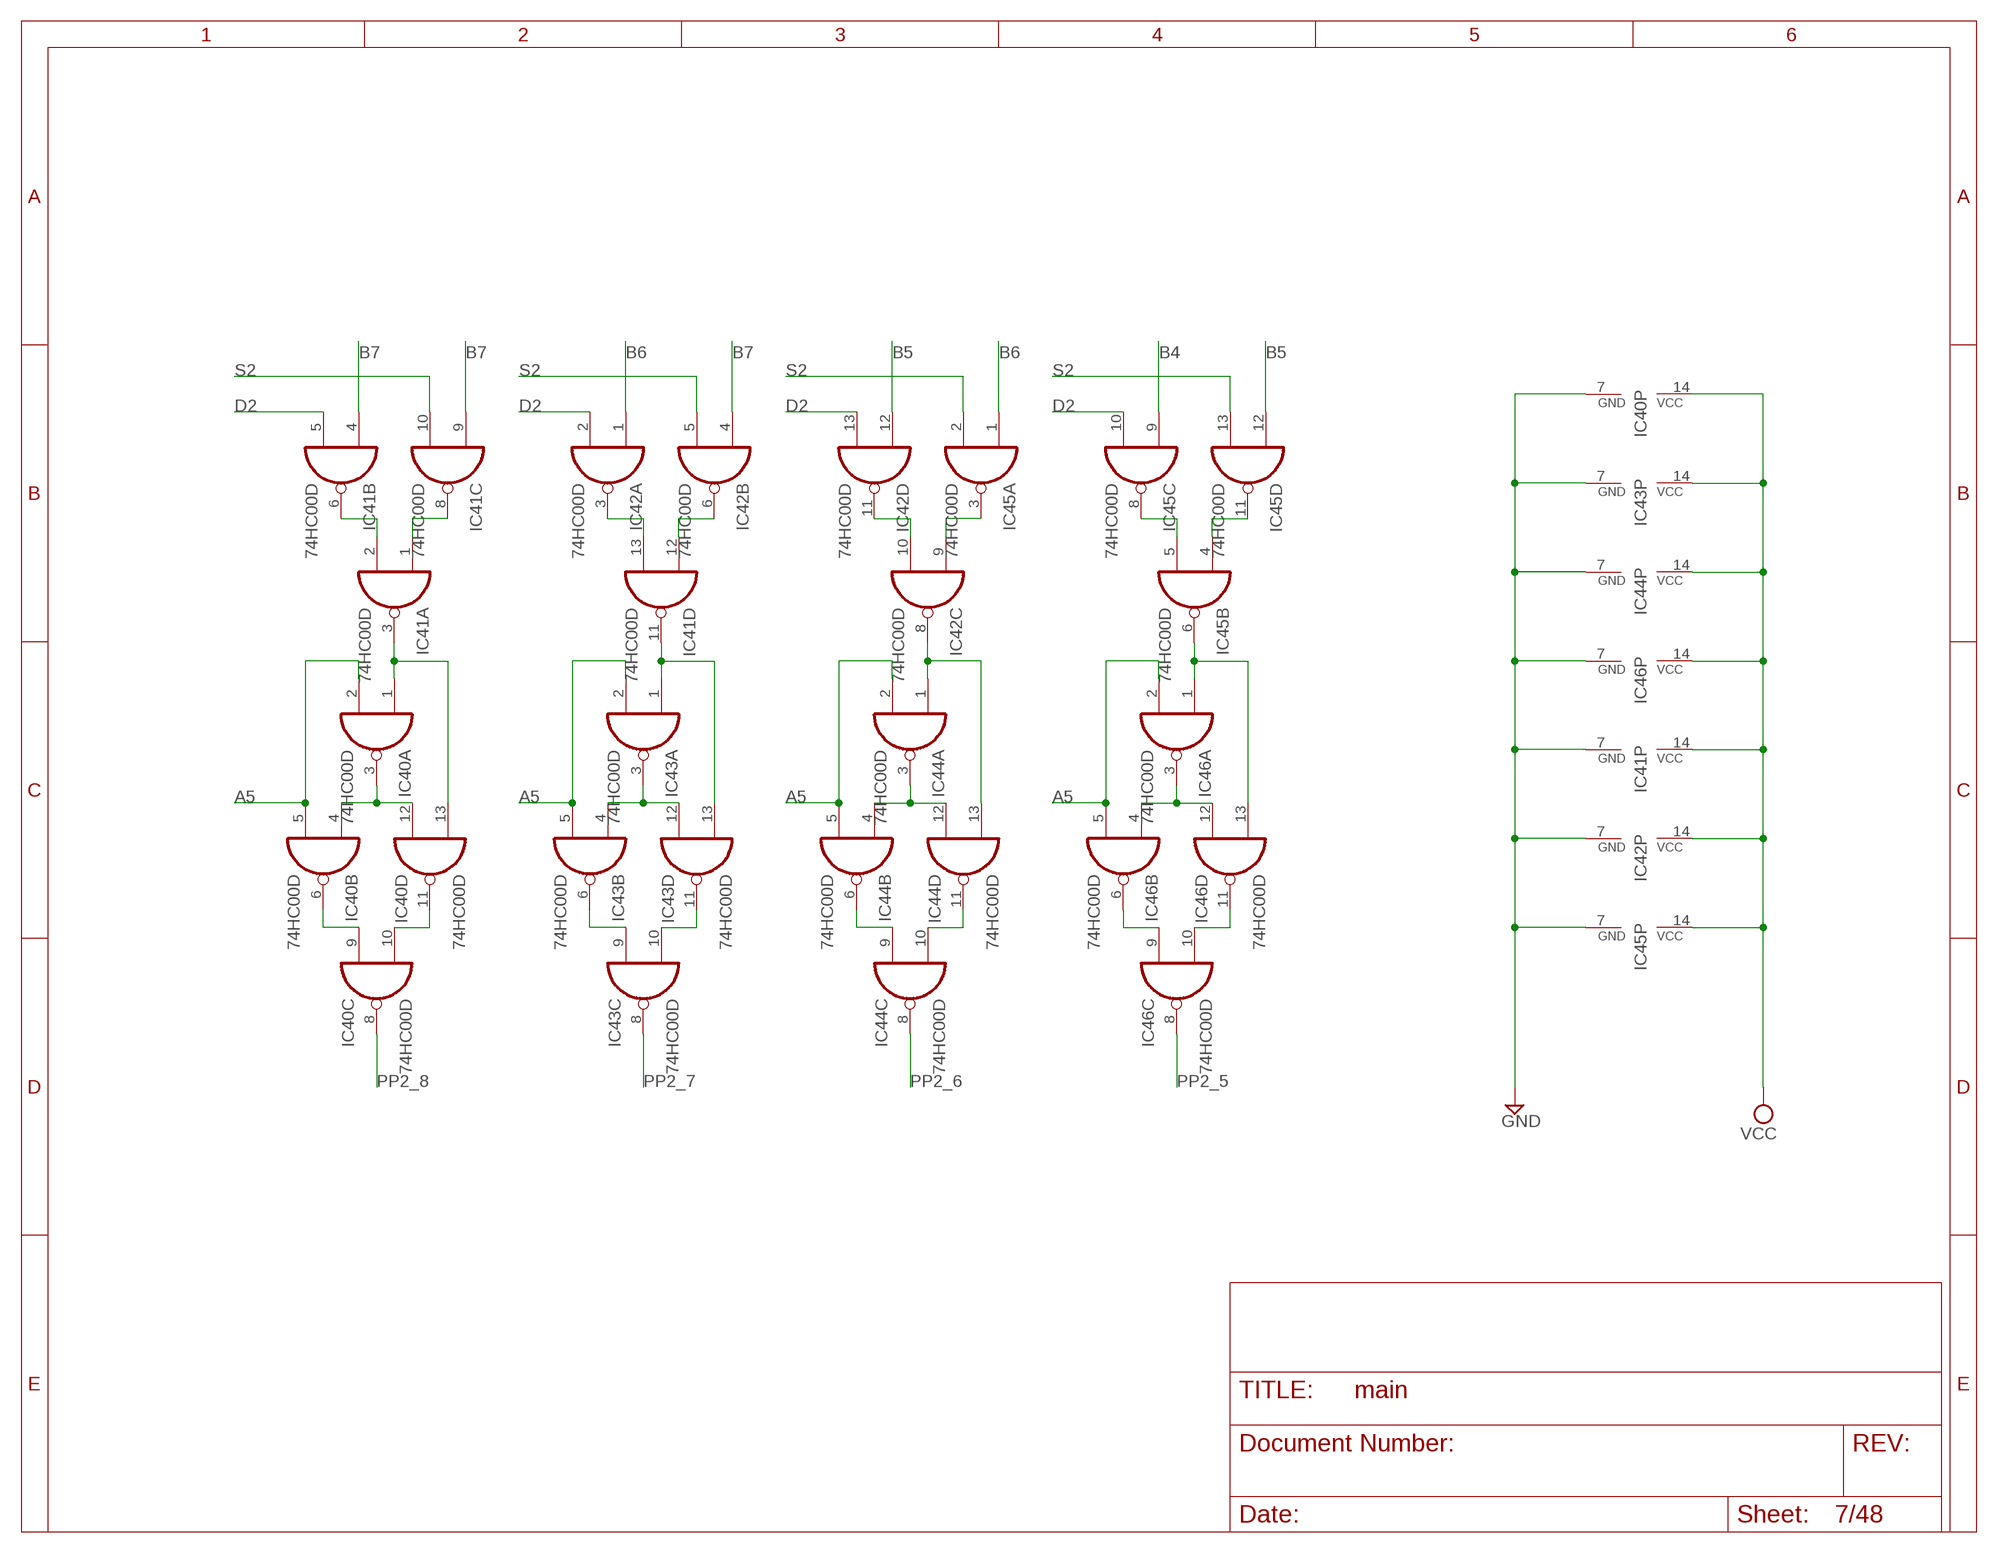
[diagram p6: schematic, sheet 7]

### Parts
IC40  74HC00D  [SO14]
IC41  74HC00D  [SO14]
IC42  74HC00D  [SO14]
IC43  74HC00D  [SO14]
IC44  74HC00D  [SO14]
IC45  74HC00D  [SO14]
IC46  74HC00D  [SO14]

### Nets
A5: IC40.2(A:I1) IC40.5(B:I1) IC43.2(A:I1) IC43.5(B:I1) IC44.2(A:I1) IC44.5(B:I1) IC46.2(A:I1) IC46.5(B:I1) ; also sheet 2,8,11,16,24,25,27,30,34,40
B4: IC45.9(C:I0) ; also sheet 3,4,5,6,8,9,10,24,25,27,34,42
B5: IC42.12(D:I0) IC45.12(D:I0) ; also sheet 3,5,9,24,25,27,34,42
B6: IC42.1(A:I0) IC45.1(A:I0) ; also sheet 3,5,9,24,25,27,34,42
B7: IC41.4(B:I0) IC41.9(C:I0) IC42.4(B:I0) ; also sheet 3,5,9,24,25,27,34,42
D2: IC41.5(B:I1) IC42.2(A:I1) IC42.13(D:I1) IC45.10(C:I1) ; also sheet 2,8
GND: IC40.7(P:GND) IC41.7(P:GND) IC42.7(P:GND) IC43.7(P:GND) IC44.7(P:GND) IC45.7(P:GND) IC46.7(P:GND) ; also sheet 1,2,3,4,5,6,8,9,10,11,12,13,14,15,16,17,18,19,20,21,22,23,24,25,26,27,28,29,30,31,32,33,34,37,38,39,40,41,42,43,44,45,46,47
N$10: IC40.6(B:O) IC40.9(C:I0)
N$13: IC40.10(C:I1) IC40.11(D:O)
N$32: IC40.3(A:O) IC40.4(B:I0) IC40.12(D:I0)
N$33: IC43.6(B:O) IC43.9(C:I0)
N$136: IC43.10(C:I1) IC43.11(D:O)
N$137: IC43.3(A:O) IC43.4(B:I0) IC43.12(D:I0)
N$138: IC44.3(A:O) IC44.4(B:I0) IC44.12(D:I0)
N$139: IC44.10(C:I1) IC44.11(D:O)
N$140: IC44.6(B:O) IC44.9(C:I0)
N$141: IC41.11(D:O) IC43.1(A:I0) IC43.13(D:I1)
N$142: IC41.13(D:I1) IC42.3(A:O)
N$143: IC41.12(D:I0) IC42.6(B:O)
N$144: IC41.1(A:I0) IC41.8(C:O)
N$145: IC41.2(A:I1) IC41.6(B:O)
N$146: IC42.10(C:I1) IC42.11(D:O)
N$147: IC42.9(C:I0) IC45.3(A:O)
N$148: IC45.5(B:I1) IC45.8(C:O)
N$149: IC45.4(B:I0) IC45.11(D:O)
N$150: IC45.6(B:O) IC46.1(A:I0) IC46.13(D:I1)
N$151: IC42.8(C:O) IC44.1(A:I0) IC44.13(D:I1)
N$152: IC40.1(A:I0) IC40.13(D:I1) IC41.3(A:O)
N$153: IC46.3(A:O) IC46.4(B:I0) IC46.12(D:I0)
N$154: IC46.6(B:O) IC46.9(C:I0)
N$155: IC46.10(C:I1) IC46.11(D:O)
PP2_5: IC46.8(C:O) ; also sheet 12
PP2_6: IC44.8(C:O) ; also sheet 12
PP2_7: IC43.8(C:O) ; also sheet 12
PP2_8: IC40.8(C:O) ; also sheet 12
S2: IC41.10(C:I1) IC42.5(B:I1) IC45.2(A:I1) IC45.13(D:I1) ; also sheet 2,8,11
VCC: IC40.14(P:VCC) IC41.14(P:VCC) IC42.14(P:VCC) IC43.14(P:VCC) IC44.14(P:VCC) IC45.14(P:VCC) IC46.14(P:VCC) ; also sheet 1,2,3,4,5,6,8,9,10,11,12,13,14,15,16,17,18,19,20,21,22,23,24,25,26,27,28,29,30,31,32,33,34,37,38,39,40,41,42,43,44,45,46,47

## Sheet 8 of 48: Booth Selector 2, 4-1
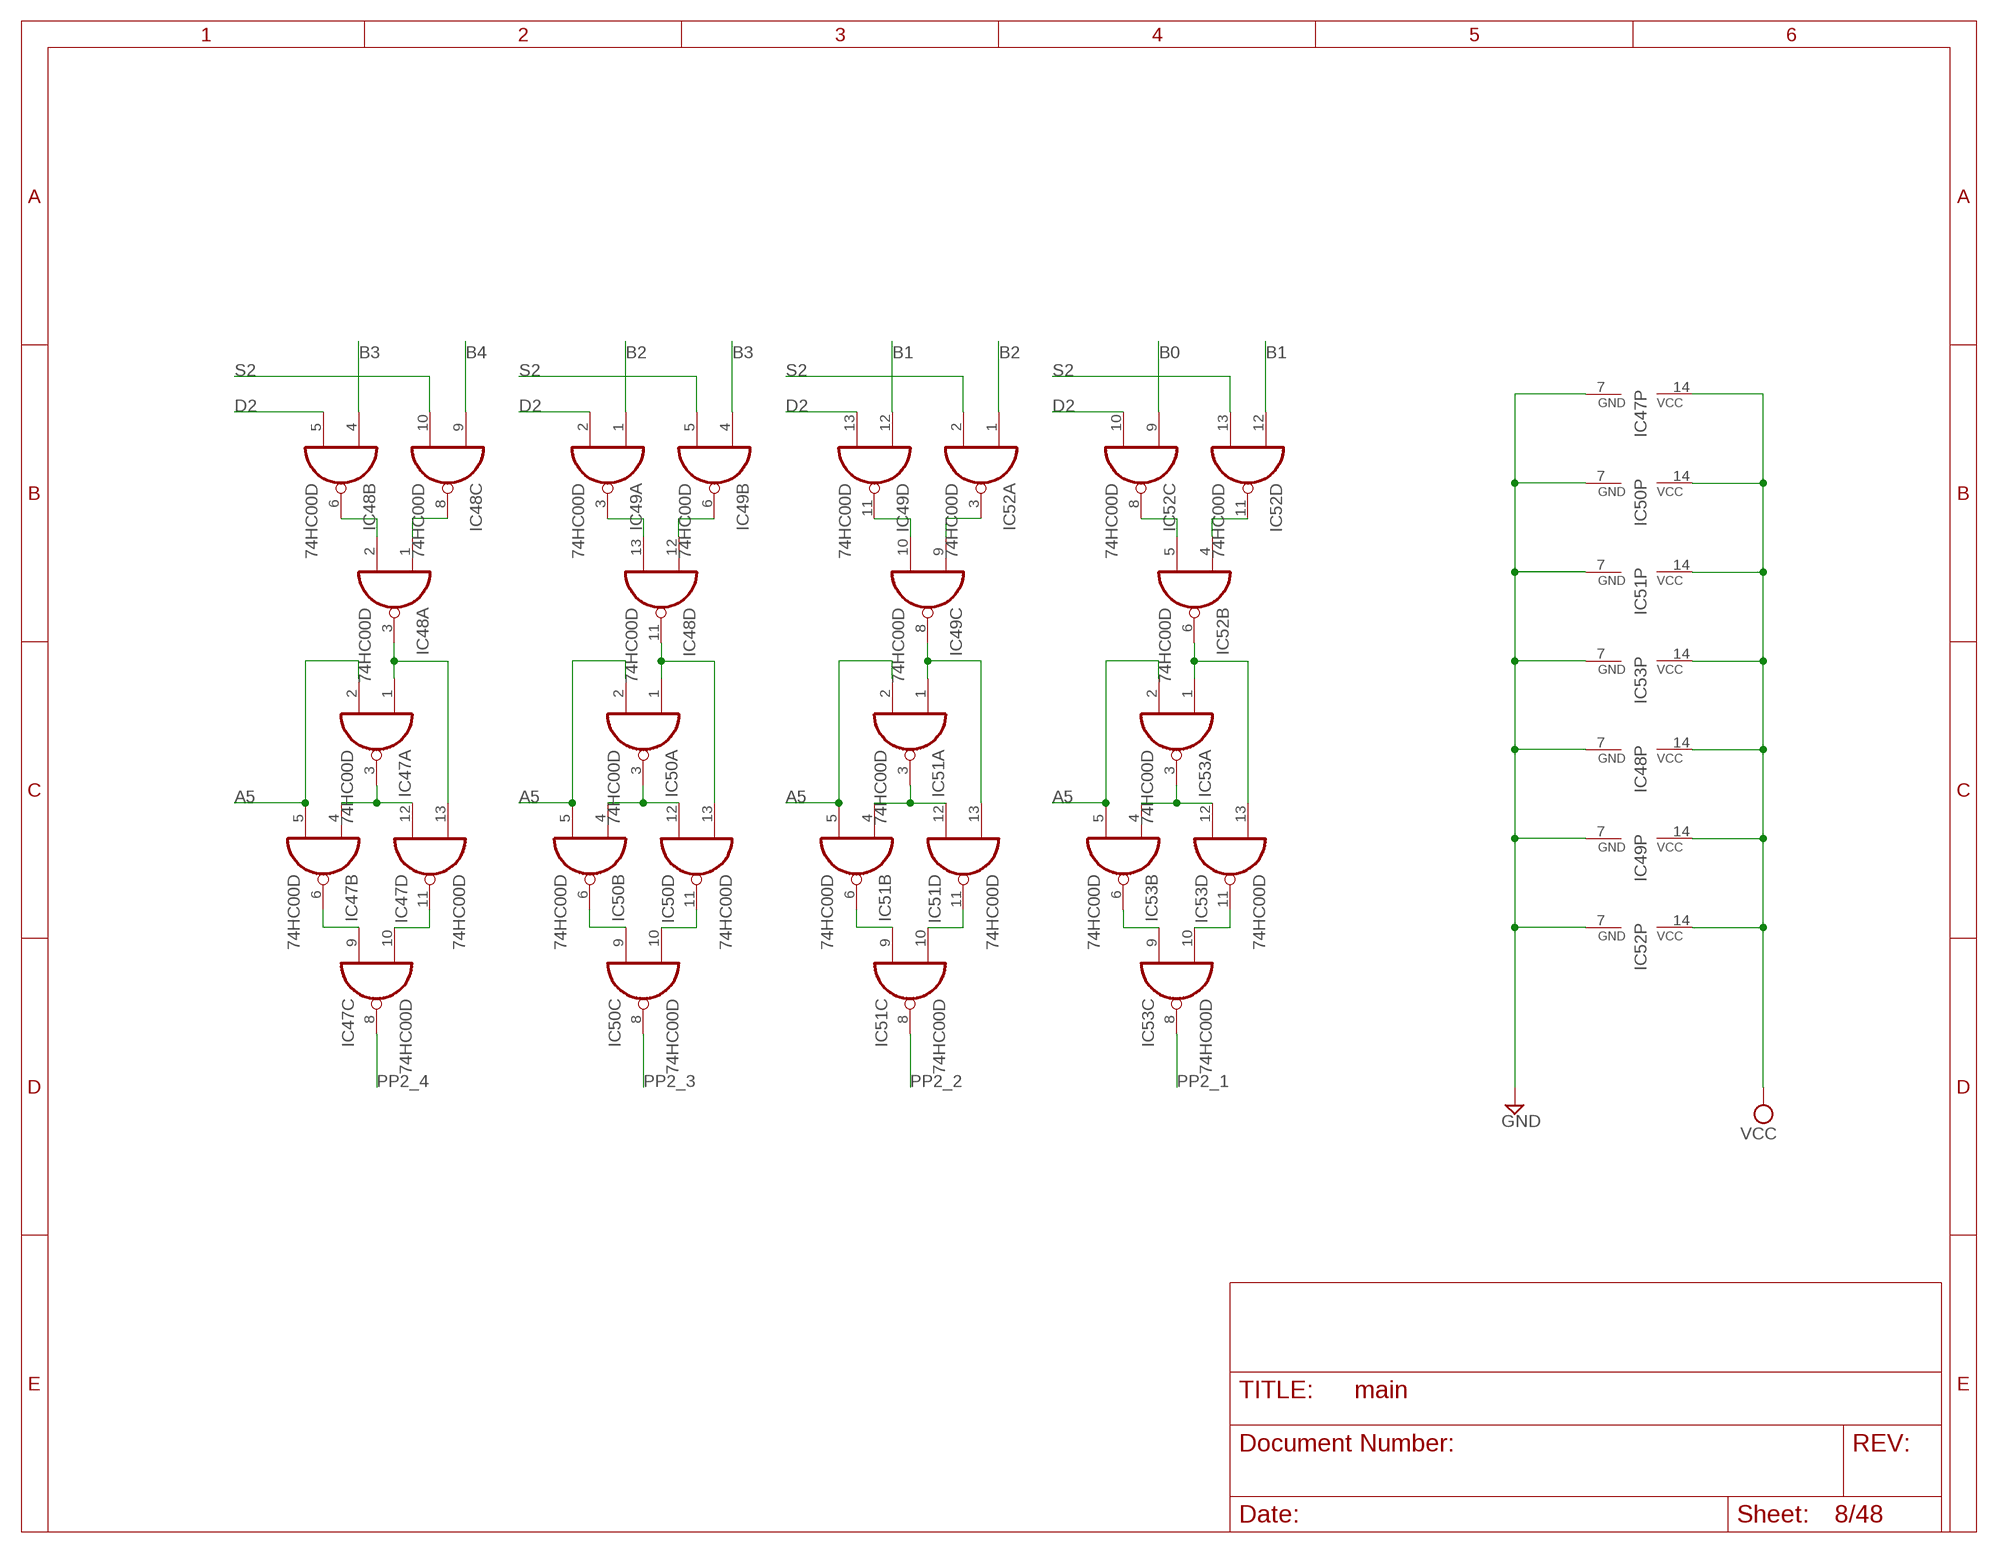
[diagram p7: schematic, sheet 8]

### Parts
IC47  74HC00D  [SO14]
IC48  74HC00D  [SO14]
IC49  74HC00D  [SO14]
IC50  74HC00D  [SO14]
IC51  74HC00D  [SO14]
IC52  74HC00D  [SO14]
IC53  74HC00D  [SO14]

### Nets
A5: IC47.2(A:I1) IC47.5(B:I1) IC50.2(A:I1) IC50.5(B:I1) IC51.2(A:I1) IC51.5(B:I1) IC53.2(A:I1) IC53.5(B:I1) ; also sheet 2,7,11,16,24,25,27,30,34,40
B0: IC52.9(C:I0) ; also sheet 4,6,10,11,24,25,26,34,43
B1: IC49.12(D:I0) IC52.12(D:I0) ; also sheet 4,6,10,24,25,26,34,43
B2: IC49.1(A:I0) IC52.1(A:I0) ; also sheet 4,6,10,24,25,26,34,43
B3: IC48.4(B:I0) IC49.4(B:I0) ; also sheet 4,6,10,24,25,26,34,43
B4: IC48.9(C:I0) ; also sheet 3,4,5,6,7,9,10,24,25,27,34,42
D2: IC48.5(B:I1) IC49.2(A:I1) IC49.13(D:I1) IC52.10(C:I1) ; also sheet 2,7
GND: IC47.7(P:GND) IC48.7(P:GND) IC49.7(P:GND) IC50.7(P:GND) IC51.7(P:GND) IC52.7(P:GND) IC53.7(P:GND) ; also sheet 1,2,3,4,5,6,7,9,10,11,12,13,14,15,16,17,18,19,20,21,22,23,24,25,26,27,28,29,30,31,32,33,34,37,38,39,40,41,42,43,44,45,46,47
N$156: IC47.6(B:O) IC47.9(C:I0)
N$157: IC47.10(C:I1) IC47.11(D:O)
N$158: IC47.3(A:O) IC47.4(B:I0) IC47.12(D:I0)
N$159: IC50.6(B:O) IC50.9(C:I0)
N$160: IC50.10(C:I1) IC50.11(D:O)
N$161: IC50.3(A:O) IC50.4(B:I0) IC50.12(D:I0)
N$162: IC51.3(A:O) IC51.4(B:I0) IC51.12(D:I0)
N$163: IC51.10(C:I1) IC51.11(D:O)
N$164: IC51.6(B:O) IC51.9(C:I0)
N$165: IC48.11(D:O) IC50.1(A:I0) IC50.13(D:I1)
N$166: IC48.13(D:I1) IC49.3(A:O)
N$167: IC48.12(D:I0) IC49.6(B:O)
N$168: IC48.1(A:I0) IC48.8(C:O)
N$169: IC48.2(A:I1) IC48.6(B:O)
N$170: IC49.10(C:I1) IC49.11(D:O)
N$171: IC49.9(C:I0) IC52.3(A:O)
N$172: IC52.5(B:I1) IC52.8(C:O)
N$173: IC52.4(B:I0) IC52.11(D:O)
N$174: IC52.6(B:O) IC53.1(A:I0) IC53.13(D:I1)
N$175: IC49.8(C:O) IC51.1(A:I0) IC51.13(D:I1)
N$176: IC47.1(A:I0) IC47.13(D:I1) IC48.3(A:O)
N$177: IC53.3(A:O) IC53.4(B:I0) IC53.12(D:I0)
N$178: IC53.6(B:O) IC53.9(C:I0)
N$179: IC53.10(C:I1) IC53.11(D:O)
PP2_1: IC53.8(C:O) ; also sheet 16
PP2_2: IC51.8(C:O) ; also sheet 13
PP2_3: IC50.8(C:O) ; also sheet 13
PP2_4: IC47.8(C:O) ; also sheet 12
S2: IC48.10(C:I1) IC49.5(B:I1) IC52.2(A:I1) IC52.13(D:I1) ; also sheet 2,7,11
VCC: IC47.14(P:VCC) IC48.14(P:VCC) IC49.14(P:VCC) IC50.14(P:VCC) IC51.14(P:VCC) IC52.14(P:VCC) IC53.14(P:VCC) ; also sheet 1,2,3,4,5,6,7,9,10,11,12,13,14,15,16,17,18,19,20,21,22,23,24,25,26,27,28,29,30,31,32,33,34,37,38,39,40,41,42,43,44,45,46,47

## Sheet 9 of 48: Booth Selector 3, 8-5
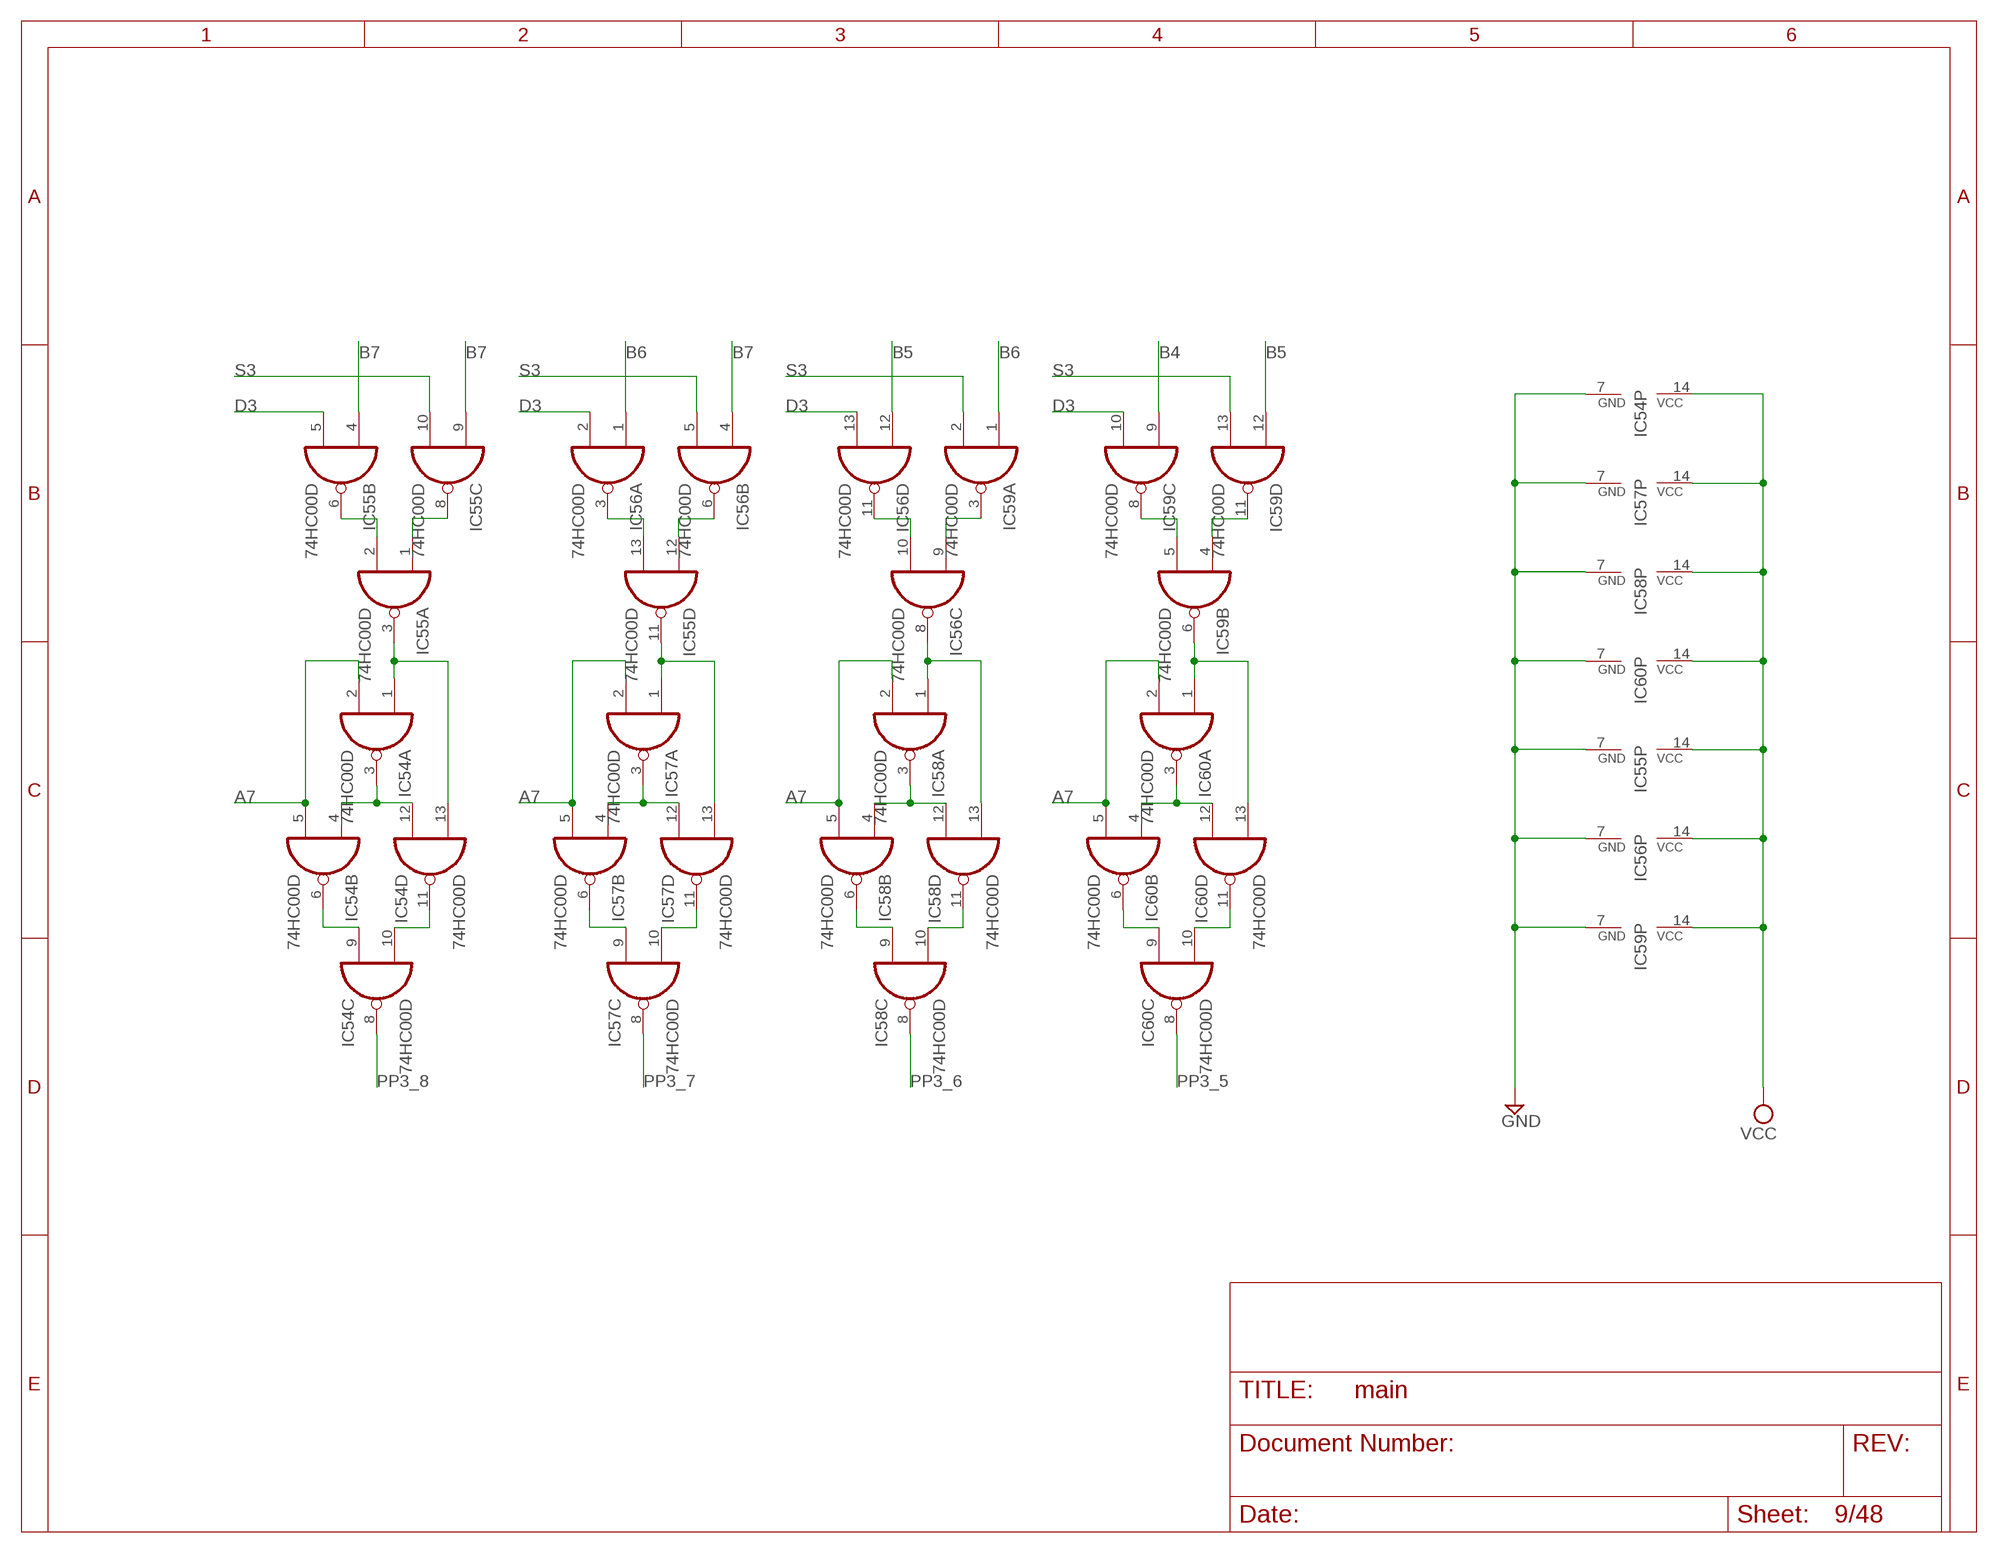
[diagram p8: schematic, sheet 9]

### Parts
IC54  74HC00D  [SO14]
IC55  74HC00D  [SO14]
IC56  74HC00D  [SO14]
IC57  74HC00D  [SO14]
IC58  74HC00D  [SO14]
IC59  74HC00D  [SO14]
IC60  74HC00D  [SO14]

### Nets
A7: IC54.2(A:I1) IC54.5(B:I1) IC57.2(A:I1) IC57.5(B:I1) IC58.2(A:I1) IC58.5(B:I1) IC60.2(A:I1) IC60.5(B:I1) ; also sheet 2,10,11,15,24,25,27,30,34,40
B4: IC59.9(C:I0) ; also sheet 3,4,5,6,7,8,10,24,25,27,34,42
B5: IC56.12(D:I0) IC59.12(D:I0) ; also sheet 3,5,7,24,25,27,34,42
B6: IC56.1(A:I0) IC59.1(A:I0) ; also sheet 3,5,7,24,25,27,34,42
B7: IC55.4(B:I0) IC55.9(C:I0) IC56.4(B:I0) ; also sheet 3,5,7,24,25,27,34,42
D3: IC55.5(B:I1) IC56.2(A:I1) IC56.13(D:I1) IC59.10(C:I1) ; also sheet 2,10
GND: IC54.7(P:GND) IC55.7(P:GND) IC56.7(P:GND) IC57.7(P:GND) IC58.7(P:GND) IC59.7(P:GND) IC60.7(P:GND) ; also sheet 1,2,3,4,5,6,7,8,10,11,12,13,14,15,16,17,18,19,20,21,22,23,24,25,26,27,28,29,30,31,32,33,34,37,38,39,40,41,42,43,44,45,46,47
N$180: IC54.6(B:O) IC54.9(C:I0)
N$181: IC54.10(C:I1) IC54.11(D:O)
N$182: IC54.3(A:O) IC54.4(B:I0) IC54.12(D:I0)
N$183: IC57.6(B:O) IC57.9(C:I0)
N$184: IC57.10(C:I1) IC57.11(D:O)
N$185: IC57.3(A:O) IC57.4(B:I0) IC57.12(D:I0)
N$186: IC58.3(A:O) IC58.4(B:I0) IC58.12(D:I0)
N$187: IC58.10(C:I1) IC58.11(D:O)
N$188: IC58.6(B:O) IC58.9(C:I0)
N$189: IC55.11(D:O) IC57.1(A:I0) IC57.13(D:I1)
N$190: IC55.13(D:I1) IC56.3(A:O)
N$191: IC55.12(D:I0) IC56.6(B:O)
N$192: IC55.1(A:I0) IC55.8(C:O)
N$193: IC55.2(A:I1) IC55.6(B:O)
N$194: IC56.10(C:I1) IC56.11(D:O)
N$195: IC56.9(C:I0) IC59.3(A:O)
N$196: IC59.5(B:I1) IC59.8(C:O)
N$197: IC59.4(B:I0) IC59.11(D:O)
N$198: IC59.6(B:O) IC60.1(A:I0) IC60.13(D:I1)
N$199: IC56.8(C:O) IC58.1(A:I0) IC58.13(D:I1)
N$200: IC54.1(A:I0) IC54.13(D:I1) IC55.3(A:O)
N$201: IC60.3(A:O) IC60.4(B:I0) IC60.12(D:I0)
N$202: IC60.6(B:O) IC60.9(C:I0)
N$203: IC60.10(C:I1) IC60.11(D:O)
PP3_5: IC60.8(C:O) ; also sheet 14
PP3_6: IC58.8(C:O) ; also sheet 14
PP3_7: IC57.8(C:O) ; also sheet 12,17
PP3_8: IC54.8(C:O) ; also sheet 12
S3: IC55.10(C:I1) IC56.5(B:I1) IC59.2(A:I1) IC59.13(D:I1) ; also sheet 2,10,11
VCC: IC54.14(P:VCC) IC55.14(P:VCC) IC56.14(P:VCC) IC57.14(P:VCC) IC58.14(P:VCC) IC59.14(P:VCC) IC60.14(P:VCC) ; also sheet 1,2,3,4,5,6,7,8,10,11,12,13,14,15,16,17,18,19,20,21,22,23,24,25,26,27,28,29,30,31,32,33,34,37,38,39,40,41,42,43,44,45,46,47

## Sheet 10 of 48: Booth Selector 3, 4-1
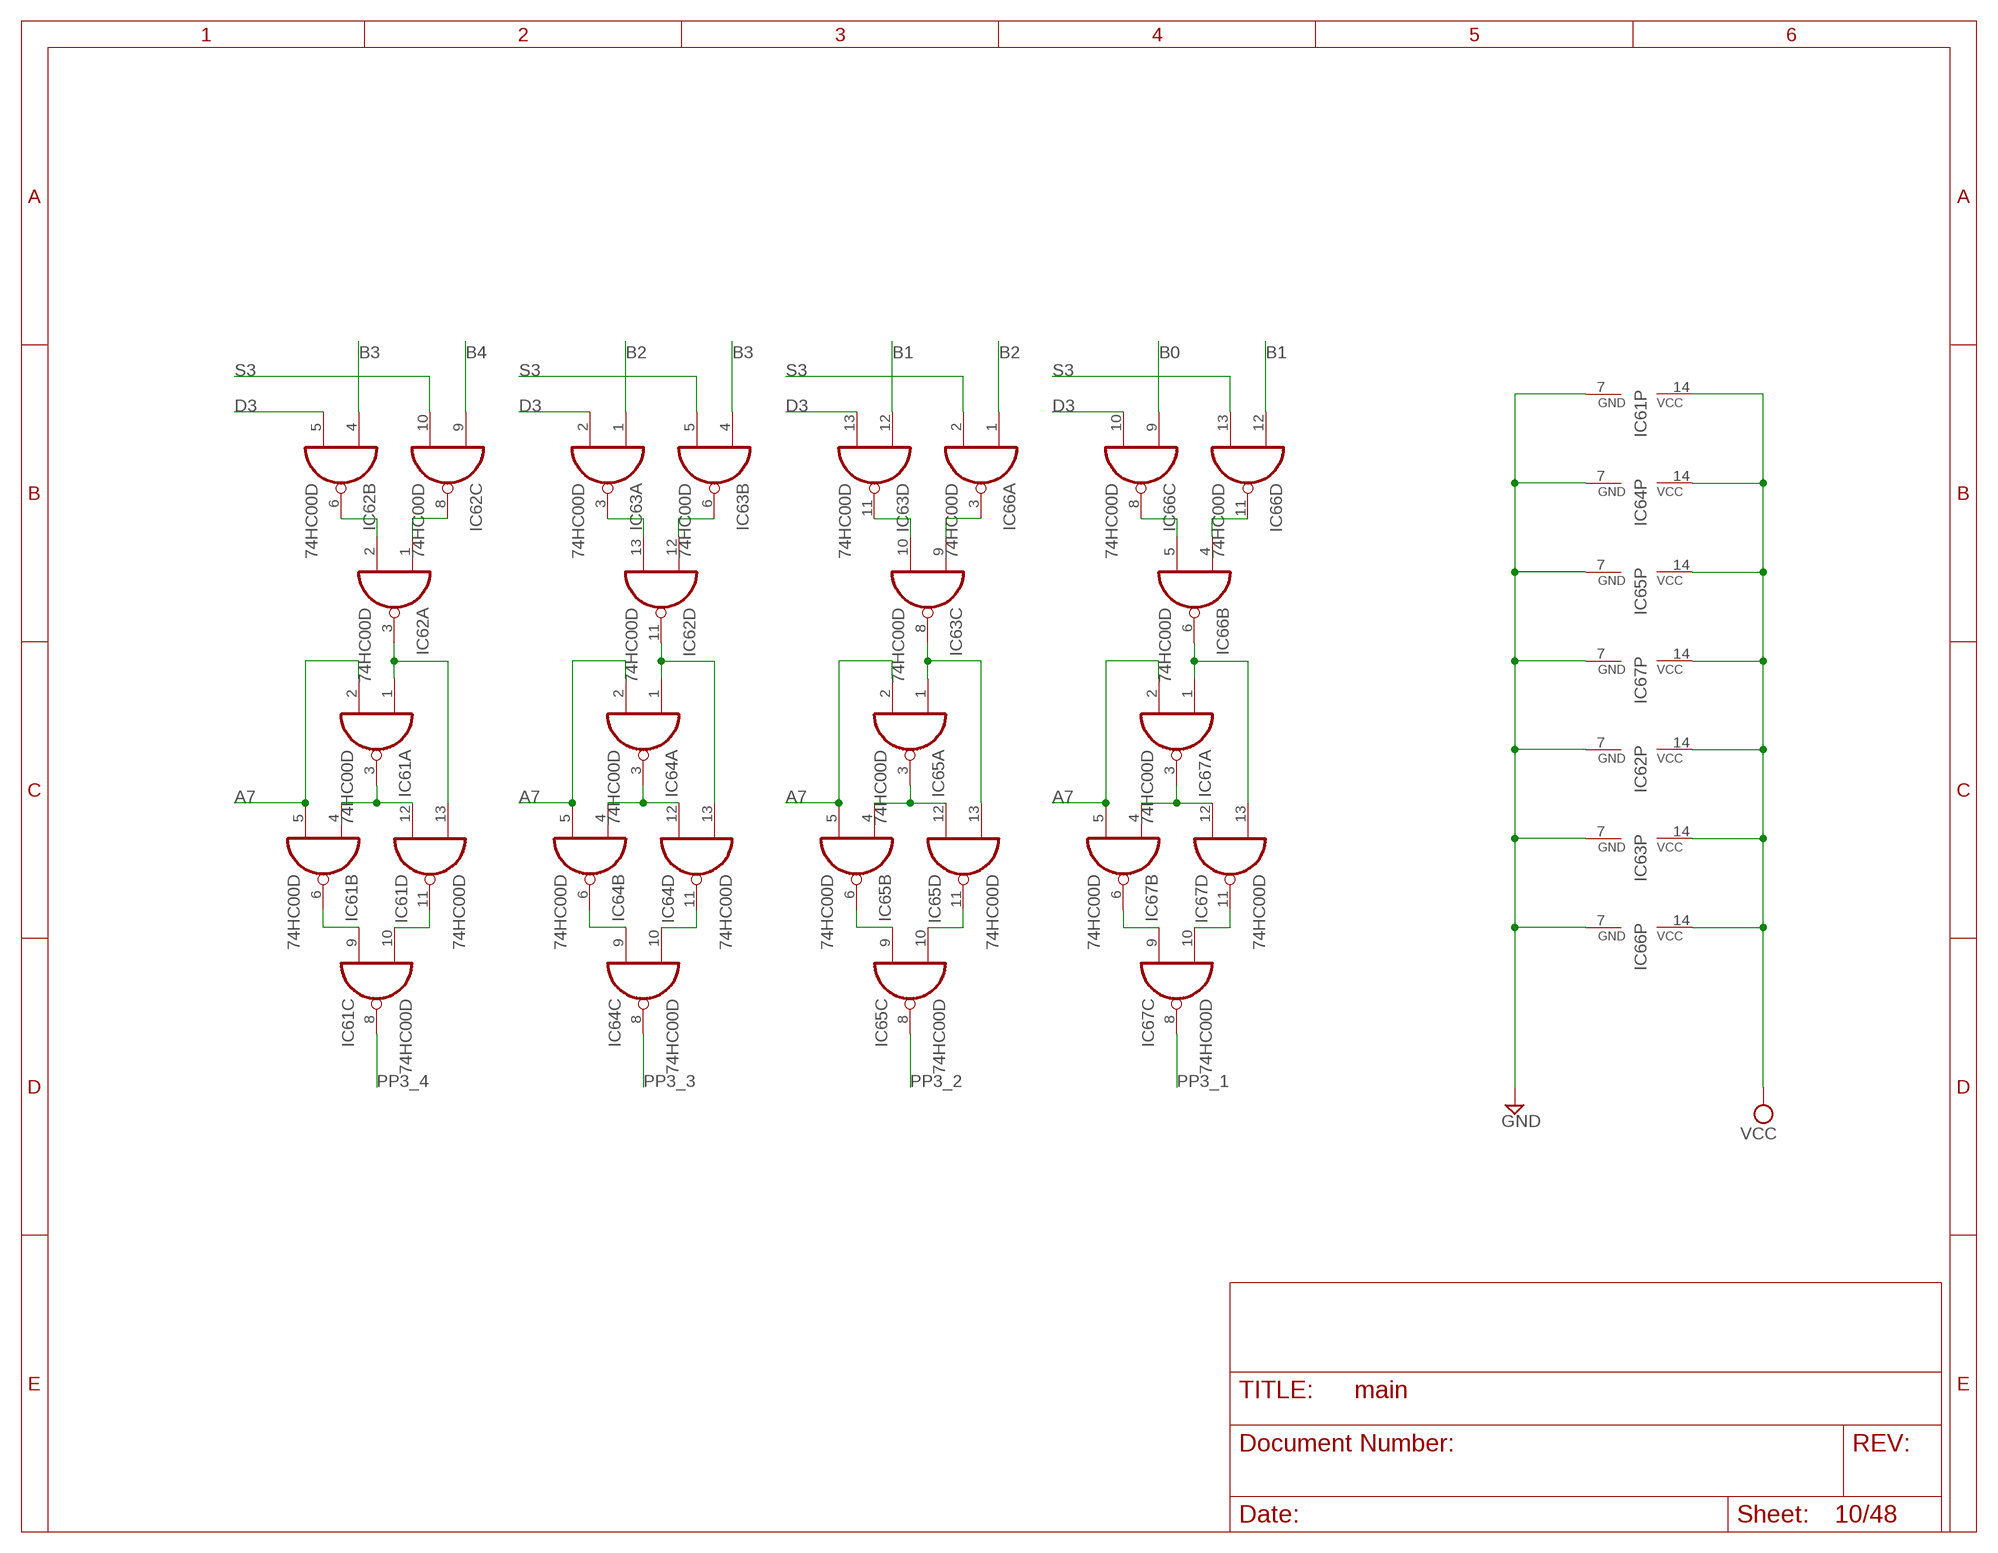
[diagram p9: schematic, sheet 10]

### Parts
IC61  74HC00D  [SO14]
IC62  74HC00D  [SO14]
IC63  74HC00D  [SO14]
IC64  74HC00D  [SO14]
IC65  74HC00D  [SO14]
IC66  74HC00D  [SO14]
IC67  74HC00D  [SO14]

### Nets
A7: IC61.2(A:I1) IC61.5(B:I1) IC64.2(A:I1) IC64.5(B:I1) IC65.2(A:I1) IC65.5(B:I1) IC67.2(A:I1) IC67.5(B:I1) ; also sheet 2,9,11,15,24,25,27,30,34,40
B0: IC66.9(C:I0) ; also sheet 4,6,8,11,24,25,26,34,43
B1: IC63.12(D:I0) IC66.12(D:I0) ; also sheet 4,6,8,24,25,26,34,43
B2: IC63.1(A:I0) IC66.1(A:I0) ; also sheet 4,6,8,24,25,26,34,43
B3: IC62.4(B:I0) IC63.4(B:I0) ; also sheet 4,6,8,24,25,26,34,43
B4: IC62.9(C:I0) ; also sheet 3,4,5,6,7,8,9,24,25,27,34,42
D3: IC62.5(B:I1) IC63.2(A:I1) IC63.13(D:I1) IC66.10(C:I1) ; also sheet 2,9
GND: IC61.7(P:GND) IC62.7(P:GND) IC63.7(P:GND) IC64.7(P:GND) IC65.7(P:GND) IC66.7(P:GND) IC67.7(P:GND) ; also sheet 1,2,3,4,5,6,7,8,9,11,12,13,14,15,16,17,18,19,20,21,22,23,24,25,26,27,28,29,30,31,32,33,34,37,38,39,40,41,42,43,44,45,46,47
N$204: IC61.6(B:O) IC61.9(C:I0)
N$205: IC61.10(C:I1) IC61.11(D:O)
N$206: IC61.3(A:O) IC61.4(B:I0) IC61.12(D:I0)
N$207: IC64.6(B:O) IC64.9(C:I0)
N$208: IC64.10(C:I1) IC64.11(D:O)
N$209: IC64.3(A:O) IC64.4(B:I0) IC64.12(D:I0)
N$210: IC65.3(A:O) IC65.4(B:I0) IC65.12(D:I0)
N$211: IC65.10(C:I1) IC65.11(D:O)
N$212: IC65.6(B:O) IC65.9(C:I0)
N$213: IC62.11(D:O) IC64.1(A:I0) IC64.13(D:I1)
N$214: IC62.13(D:I1) IC63.3(A:O)
N$215: IC62.12(D:I0) IC63.6(B:O)
N$216: IC62.1(A:I0) IC62.8(C:O)
N$217: IC62.2(A:I1) IC62.6(B:O)
N$218: IC63.10(C:I1) IC63.11(D:O)
N$219: IC63.9(C:I0) IC66.3(A:O)
N$220: IC66.5(B:I1) IC66.8(C:O)
N$221: IC66.4(B:I0) IC66.11(D:O)
N$222: IC66.6(B:O) IC67.1(A:I0) IC67.13(D:I1)
N$223: IC63.8(C:O) IC65.1(A:I0) IC65.13(D:I1)
N$224: IC61.1(A:I0) IC61.13(D:I1) IC62.3(A:O)
N$225: IC67.3(A:O) IC67.4(B:I0) IC67.12(D:I0)
N$226: IC67.6(B:O) IC67.9(C:I0)
N$227: IC67.10(C:I1) IC67.11(D:O)
PP3_1: IC67.8(C:O) ; also sheet 15
PP3_2: IC65.8(C:O) ; also sheet 15
PP3_3: IC64.8(C:O) ; also sheet 15
PP3_4: IC61.8(C:O) ; also sheet 14
S3: IC62.10(C:I1) IC63.5(B:I1) IC66.2(A:I1) IC66.13(D:I1) ; also sheet 2,9,11
VCC: IC61.14(P:VCC) IC62.14(P:VCC) IC63.14(P:VCC) IC64.14(P:VCC) IC65.14(P:VCC) IC66.14(P:VCC) IC67.14(P:VCC) ; also sheet 1,2,3,4,5,6,7,8,9,11,12,13,14,15,16,17,18,19,20,21,22,23,24,25,26,27,28,29,30,31,32,33,34,37,38,39,40,41,42,43,44,45,46,47

## Sheet 11 of 48: Booth Selectors 0-3, 0
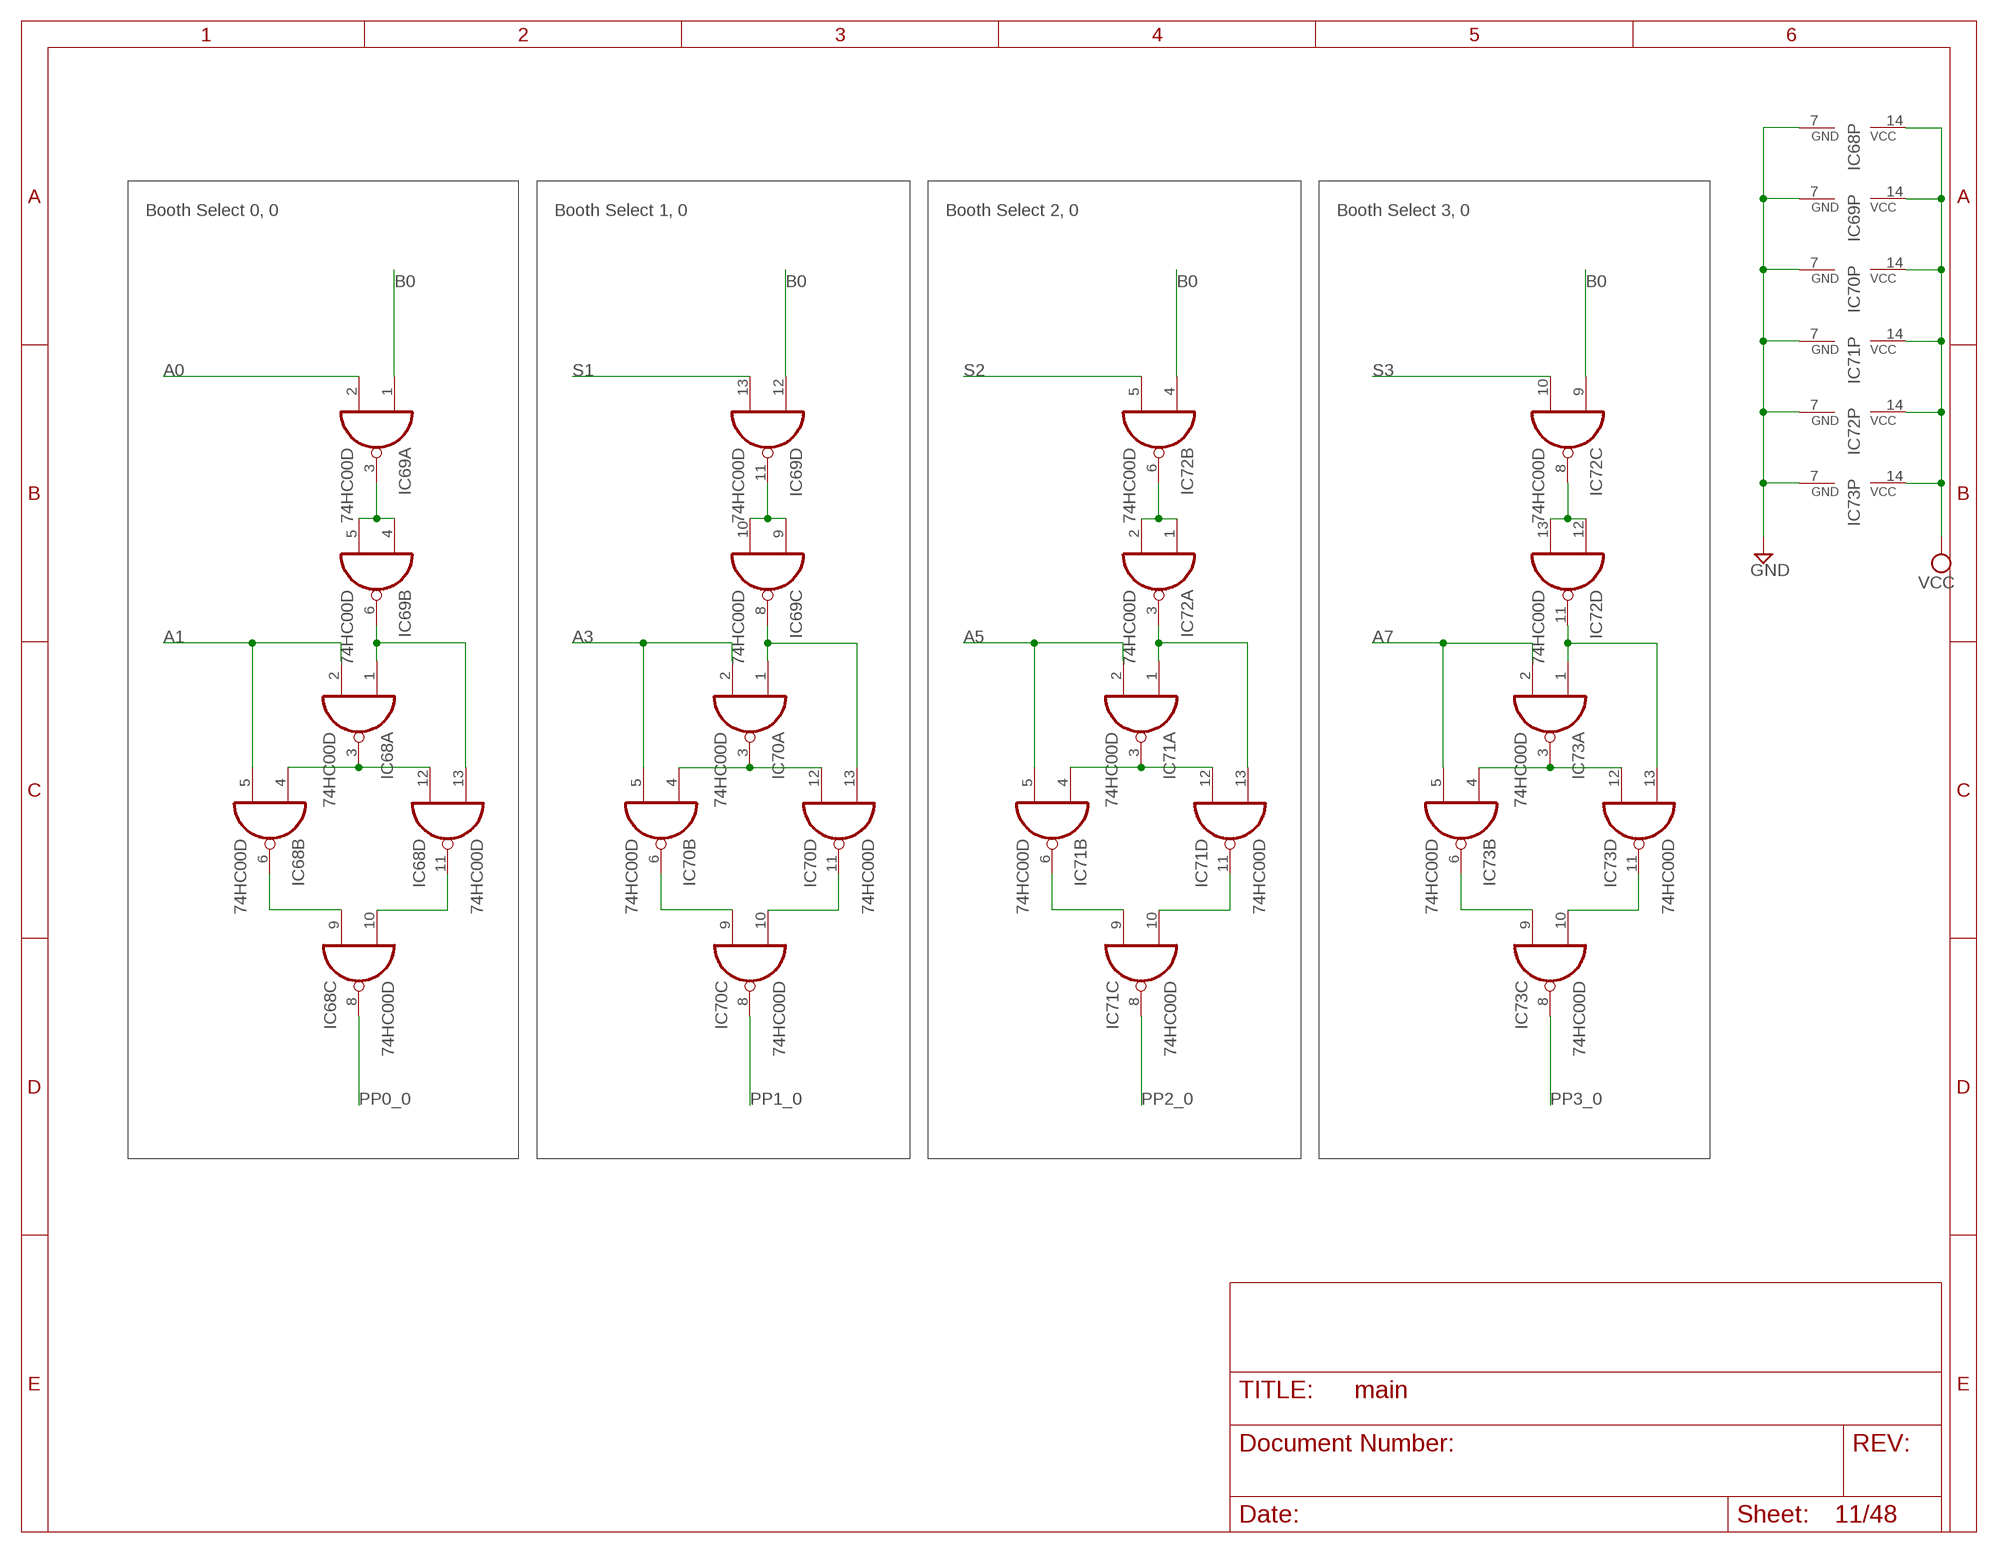
[diagram p10: schematic, sheet 11]

### Parts
IC68  74HC00D  [SO14]
IC69  74HC00D  [SO14]
IC70  74HC00D  [SO14]
IC71  74HC00D  [SO14]
IC72  74HC00D  [SO14]
IC73  74HC00D  [SO14]

### Nets
A0: IC69.2(A:I1) ; also sheet 1,3,4,24,25,26,30,34,41
A1: IC68.2(A:I1) IC68.5(B:I1) ; also sheet 1,3,4,19,24,25,26,30,34,41
A3: IC70.2(A:I1) IC70.5(B:I1) ; also sheet 1,2,5,6,22,24,25,26,30,34,41
A5: IC71.2(A:I1) IC71.5(B:I1) ; also sheet 2,7,8,16,24,25,27,30,34,40
A7: IC73.2(A:I1) IC73.5(B:I1) ; also sheet 2,9,10,15,24,25,27,30,34,40
B0: IC69.1(A:I0) IC69.12(D:I0) IC72.4(B:I0) IC72.9(C:I0) ; also sheet 4,6,8,10,24,25,26,34,43
GND: IC68.7(P:GND) IC69.7(P:GND) IC70.7(P:GND) IC71.7(P:GND) IC72.7(P:GND) IC73.7(P:GND) ; also sheet 1,2,3,4,5,6,7,8,9,10,12,13,14,15,16,17,18,19,20,21,22,23,24,25,26,27,28,29,30,31,32,33,34,37,38,39,40,41,42,43,44,45,46,47
N$228: IC68.6(B:O) IC68.9(C:I0)
N$229: IC68.10(C:I1) IC68.11(D:O)
N$230: IC68.3(A:O) IC68.4(B:I0) IC68.12(D:I0)
N$231: IC70.3(A:O) IC70.4(B:I0) IC70.12(D:I0)
N$232: IC70.10(C:I1) IC70.11(D:O)
N$233: IC70.6(B:O) IC70.9(C:I0)
N$234: IC69.8(C:O) IC70.1(A:I0) IC70.13(D:I1)
N$235: IC69.9(C:I0) IC69.10(C:I1) IC69.11(D:O)
N$236: IC72.1(A:I0) IC72.2(A:I1) IC72.6(B:O)
N$237: IC72.8(C:O) IC72.12(D:I0) IC72.13(D:I1)
N$238: IC73.3(A:O) IC73.4(B:I0) IC73.12(D:I0)
N$239: IC71.3(A:O) IC71.4(B:I0) IC71.12(D:I0)
N$240: IC71.6(B:O) IC71.9(C:I0)
N$241: IC71.10(C:I1) IC71.11(D:O)
N$242: IC73.6(B:O) IC73.9(C:I0)
N$243: IC73.10(C:I1) IC73.11(D:O)
N$244: IC71.1(A:I0) IC71.13(D:I1) IC72.3(A:O)
N$246: IC72.11(D:O) IC73.1(A:I0) IC73.13(D:I1)
N$247: IC68.1(A:I0) IC68.13(D:I1) IC69.6(B:O)
N$248: IC69.3(A:O) IC69.4(B:I0) IC69.5(B:I1)
PP0_0: IC68.8(C:O) ; also sheet 19
PP1_0: IC70.8(C:O) ; also sheet 16
PP2_0: IC71.8(C:O) ; also sheet 16
PP3_0: IC73.8(C:O) ; also sheet 15
S1: IC69.13(D:I1) ; also sheet 1,5,6
S2: IC72.5(B:I1) ; also sheet 2,7,8
S3: IC72.10(C:I1) ; also sheet 2,9,10
VCC: IC68.14(P:VCC) IC69.14(P:VCC) IC70.14(P:VCC) IC71.14(P:VCC) IC72.14(P:VCC) IC73.14(P:VCC) ; also sheet 1,2,3,4,5,6,7,8,9,10,12,13,14,15,16,17,18,19,20,21,22,23,24,25,26,27,28,29,30,31,32,33,34,37,38,39,40,41,42,43,44,45,46,47

### Notes on the sheet
- Booth Select 0, 0 | Booth Select 1, 0 | Booth Select 2, 0 | Booth Select 3, 0

## Sheet 12 of 48: M_STAGE0, 9-5, Sign Extension Inverters, M_STAGE1, 11
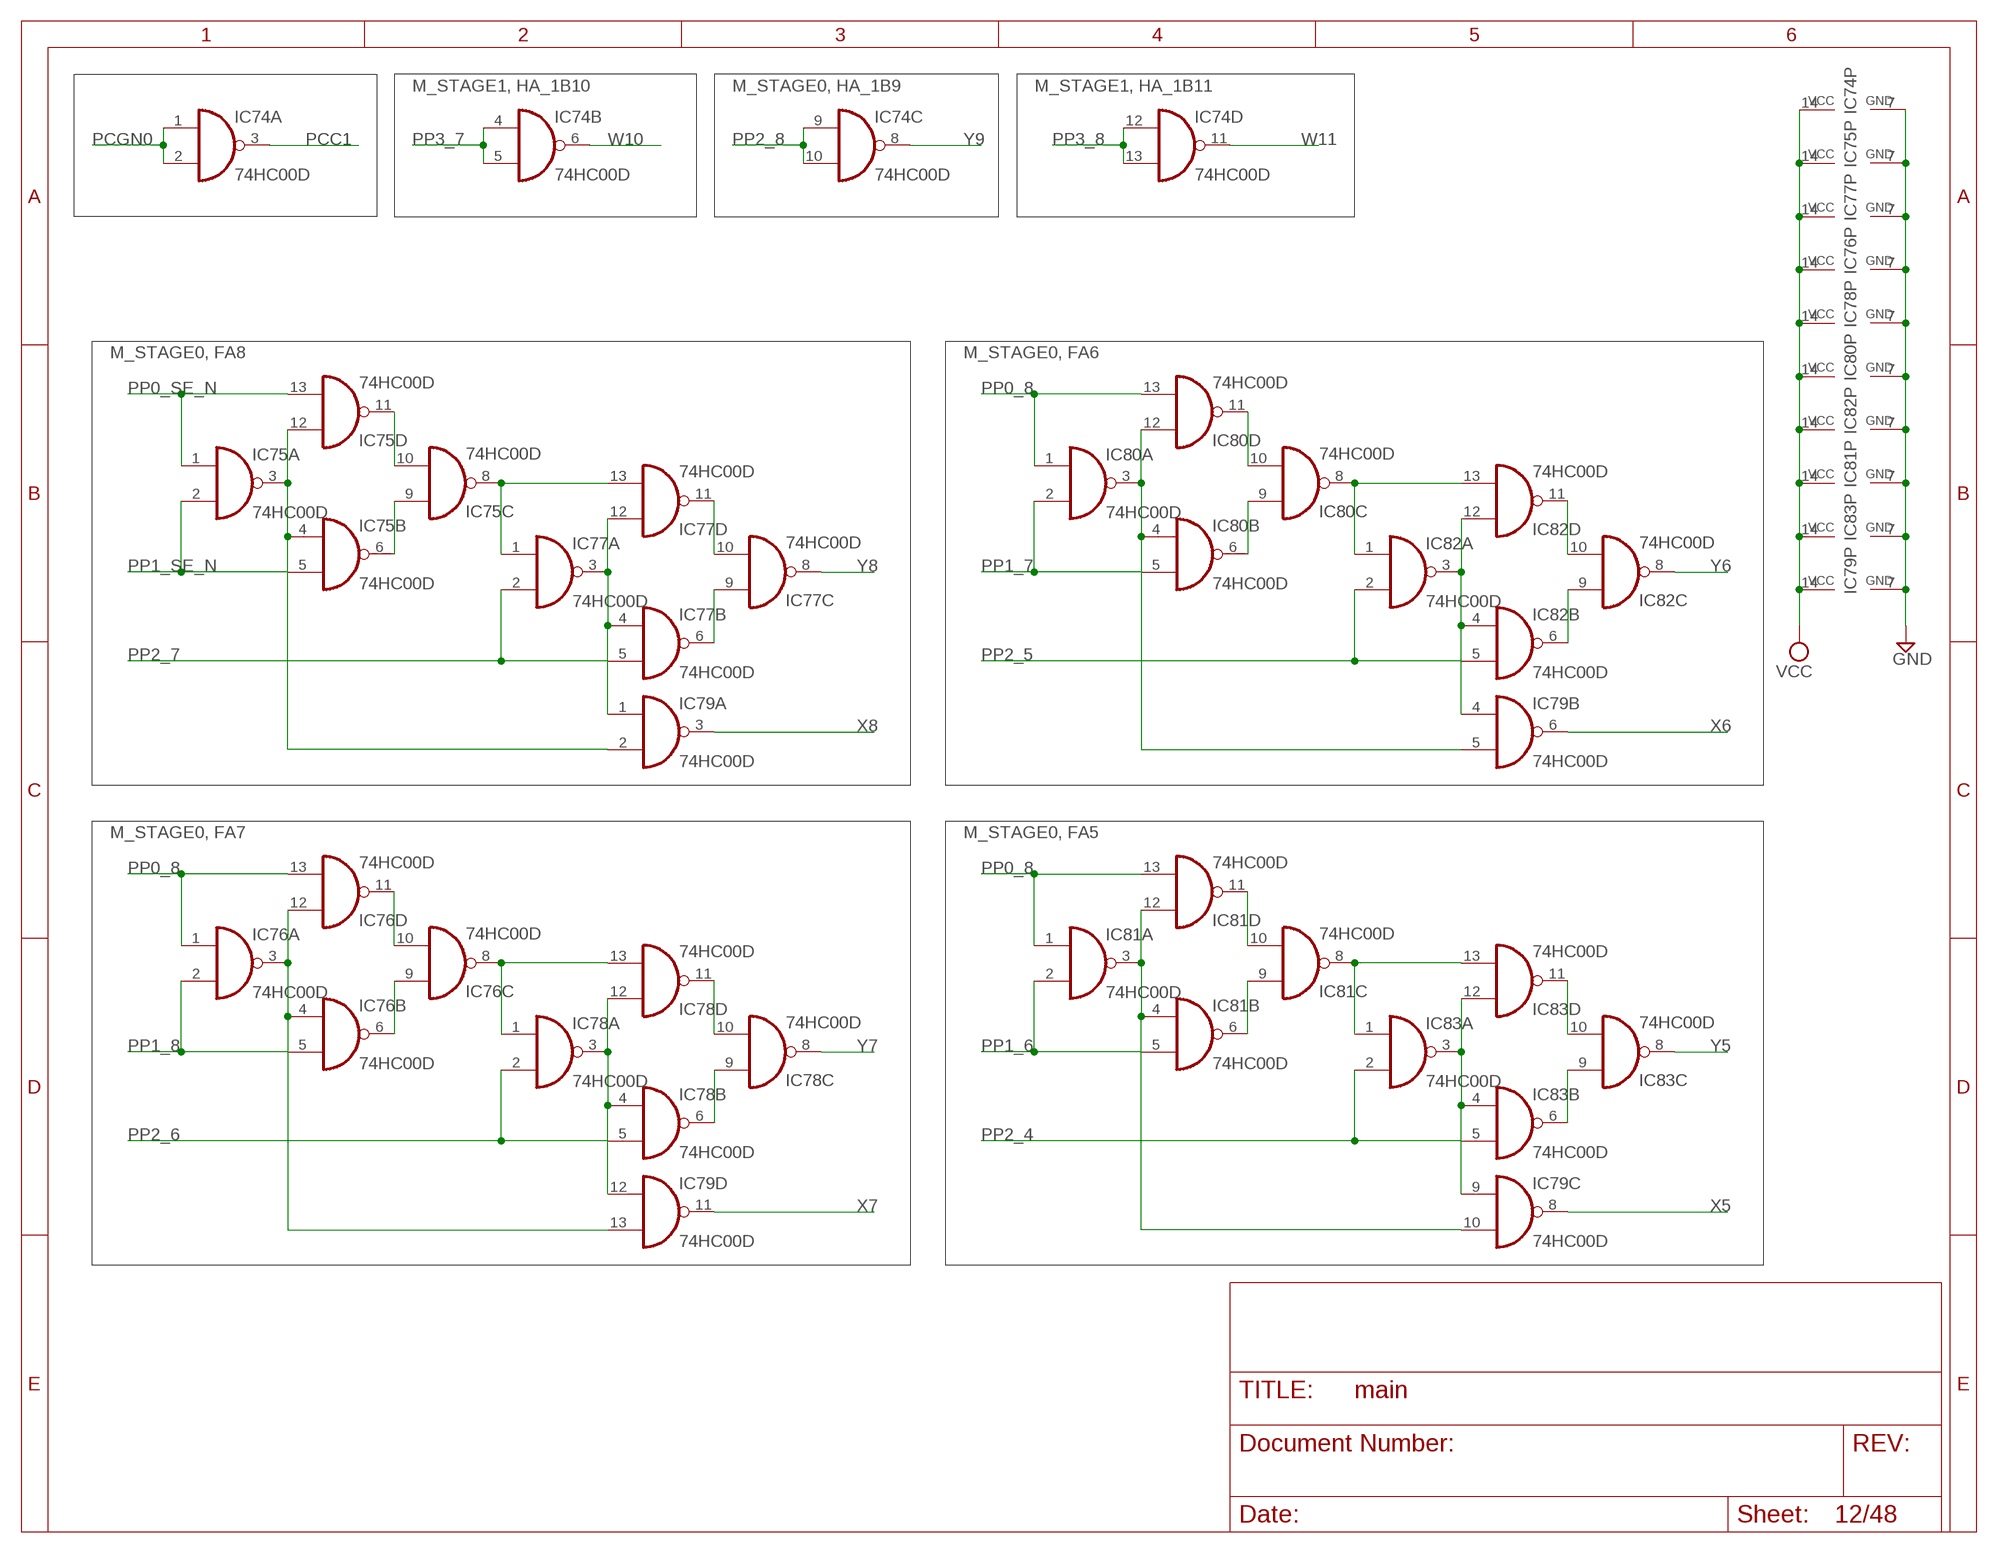
[diagram p11: schematic, sheet 12]

### Parts
IC74  74HC00D  [SO14]
IC75  74HC00D  [SO14]
IC76  74HC00D  [SO14]
IC77  74HC00D  [SO14]
IC78  74HC00D  [SO14]
IC79  74HC00D  [SO14]
IC80  74HC00D  [SO14]
IC81  74HC00D  [SO14]
IC82  74HC00D  [SO14]
IC83  74HC00D  [SO14]

### Nets
GND: IC74.7(P:GND) IC75.7(P:GND) IC76.7(P:GND) IC77.7(P:GND) IC78.7(P:GND) IC79.7(P:GND) IC80.7(P:GND) IC81.7(P:GND) IC82.7(P:GND) IC83.7(P:GND) ; also sheet 1,2,3,4,5,6,7,8,9,10,11,13,14,15,16,17,18,19,20,21,22,23,24,25,26,27,28,29,30,31,32,33,34,37,38,39,40,41,42,43,44,45,46,47
N$245: IC75.3(A:O) IC75.4(B:I0) IC75.12(D:I0) IC79.2(A:I1)
N$249: IC75.10(C:I1) IC75.11(D:O)
N$250: IC75.6(B:O) IC75.9(C:I0)
N$253: IC75.8(C:O) IC77.1(A:I0) IC77.13(D:I1)
N$254: IC77.3(A:O) IC77.4(B:I0) IC77.12(D:I0) IC79.1(A:I0)
N$256: IC77.6(B:O) IC77.9(C:I0)
N$257: IC77.10(C:I1) IC77.11(D:O)
N$268: IC79.5(B:I1) IC80.3(A:O) IC80.4(B:I0) IC80.12(D:I0)
N$269: IC80.10(C:I1) IC80.11(D:O)
N$270: IC80.6(B:O) IC80.9(C:I0)
N$271: IC80.8(C:O) IC82.1(A:I0) IC82.13(D:I1)
N$272: IC79.4(B:I0) IC82.3(A:O) IC82.4(B:I0) IC82.12(D:I0)
N$273: IC82.10(C:I1) IC82.11(D:O)
N$274: IC82.6(B:O) IC82.9(C:I0)
N$280: IC81.8(C:O) IC83.1(A:I0) IC83.13(D:I1)
N$281: IC79.9(C:I0) IC83.3(A:O) IC83.4(B:I0) IC83.12(D:I0)
N$283: IC81.6(B:O) IC81.9(C:I0)
N$284: IC81.10(C:I1) IC81.11(D:O)
N$285: IC79.10(C:I1) IC81.3(A:O) IC81.4(B:I0) IC81.12(D:I0)
N$288: IC83.6(B:O) IC83.9(C:I0)
N$289: IC83.10(C:I1) IC83.11(D:O)
N$294: IC78.6(B:O) IC78.9(C:I0)
N$295: IC78.10(C:I1) IC78.11(D:O)
N$296: IC78.3(A:O) IC78.4(B:I0) IC78.12(D:I0) IC79.12(D:I0)
N$297: IC76.8(C:O) IC78.1(A:I0) IC78.13(D:I1)
N$299: IC76.6(B:O) IC76.9(C:I0)
N$300: IC76.10(C:I1) IC76.11(D:O)
N$301: IC76.3(A:O) IC76.4(B:I0) IC76.12(D:I0) IC79.13(D:I1)
PCC1: IC74.3(A:O) ; also sheet 29,31
PCGN0: IC74.1(A:I0) IC74.2(A:I1) ; also sheet 31
PP0_8: IC76.1(A:I0) IC76.13(D:I1) IC80.1(A:I0) IC80.13(D:I1) IC81.1(A:I0) IC81.13(D:I1) ; also sheet 2,3
PP0_SE_N: IC75.1(A:I0) IC75.13(D:I1) ; also sheet 2
PP1_6: IC81.2(A:I1) IC81.5(B:I1) ; also sheet 5
PP1_7: IC80.2(A:I1) IC80.5(B:I1) ; also sheet 5
PP1_8: IC76.2(A:I1) IC76.5(B:I1) ; also sheet 2,5
PP1_SE_N: IC75.2(A:I1) IC75.5(B:I1) ; also sheet 2
PP2_4: IC83.2(A:I1) IC83.5(B:I1) ; also sheet 8
PP2_5: IC82.2(A:I1) IC82.5(B:I1) ; also sheet 7
PP2_6: IC78.2(A:I1) IC78.5(B:I1) ; also sheet 7
PP2_7: IC77.2(A:I1) IC77.5(B:I1) ; also sheet 7
PP2_8: IC74.9(C:I0) IC74.10(C:I1) ; also sheet 7
PP3_7: IC74.4(B:I0) IC74.5(B:I1) ; also sheet 9,17
PP3_8: IC74.12(D:I0) IC74.13(D:I1) ; also sheet 9
VCC: IC74.14(P:VCC) IC75.14(P:VCC) IC76.14(P:VCC) IC77.14(P:VCC) IC78.14(P:VCC) IC79.14(P:VCC) IC80.14(P:VCC) IC81.14(P:VCC) IC82.14(P:VCC) IC83.14(P:VCC) ; also sheet 1,2,3,4,5,6,7,8,9,10,11,13,14,15,16,17,18,19,20,21,22,23,24,25,26,27,28,29,30,31,32,33,34,37,38,39,40,41,42,43,44,45,46,47
W10: IC74.6(B:O) ; also sheet 17
W11: IC74.11(D:O) ; also sheet 17
X5: IC79.8(C:O) ; also sheet 15
X6: IC79.6(B:O) ; also sheet 14
X7: IC79.11(D:O) ; also sheet 14
X8: IC79.3(A:O) ; also sheet 14
Y5: IC83.8(C:O) ; also sheet 15
Y6: IC82.8(C:O) ; also sheet 15
Y7: IC78.8(C:O) ; also sheet 14
Y8: IC77.8(C:O) ; also sheet 14
Y9: IC74.8(C:O) ; also sheet 14

### Notes on the sheet
- M_STAGE1, HA_1B10 | M_STAGE0, HA_1B9 | M_STAGE1, HA_1B11
- M_STAGE0, FA8 | M_STAGE0, FA6
- M_STAGE0, FA7 | M_STAGE0, FA5

## Sheet 13 of 48: M_STAGE0, 4-1
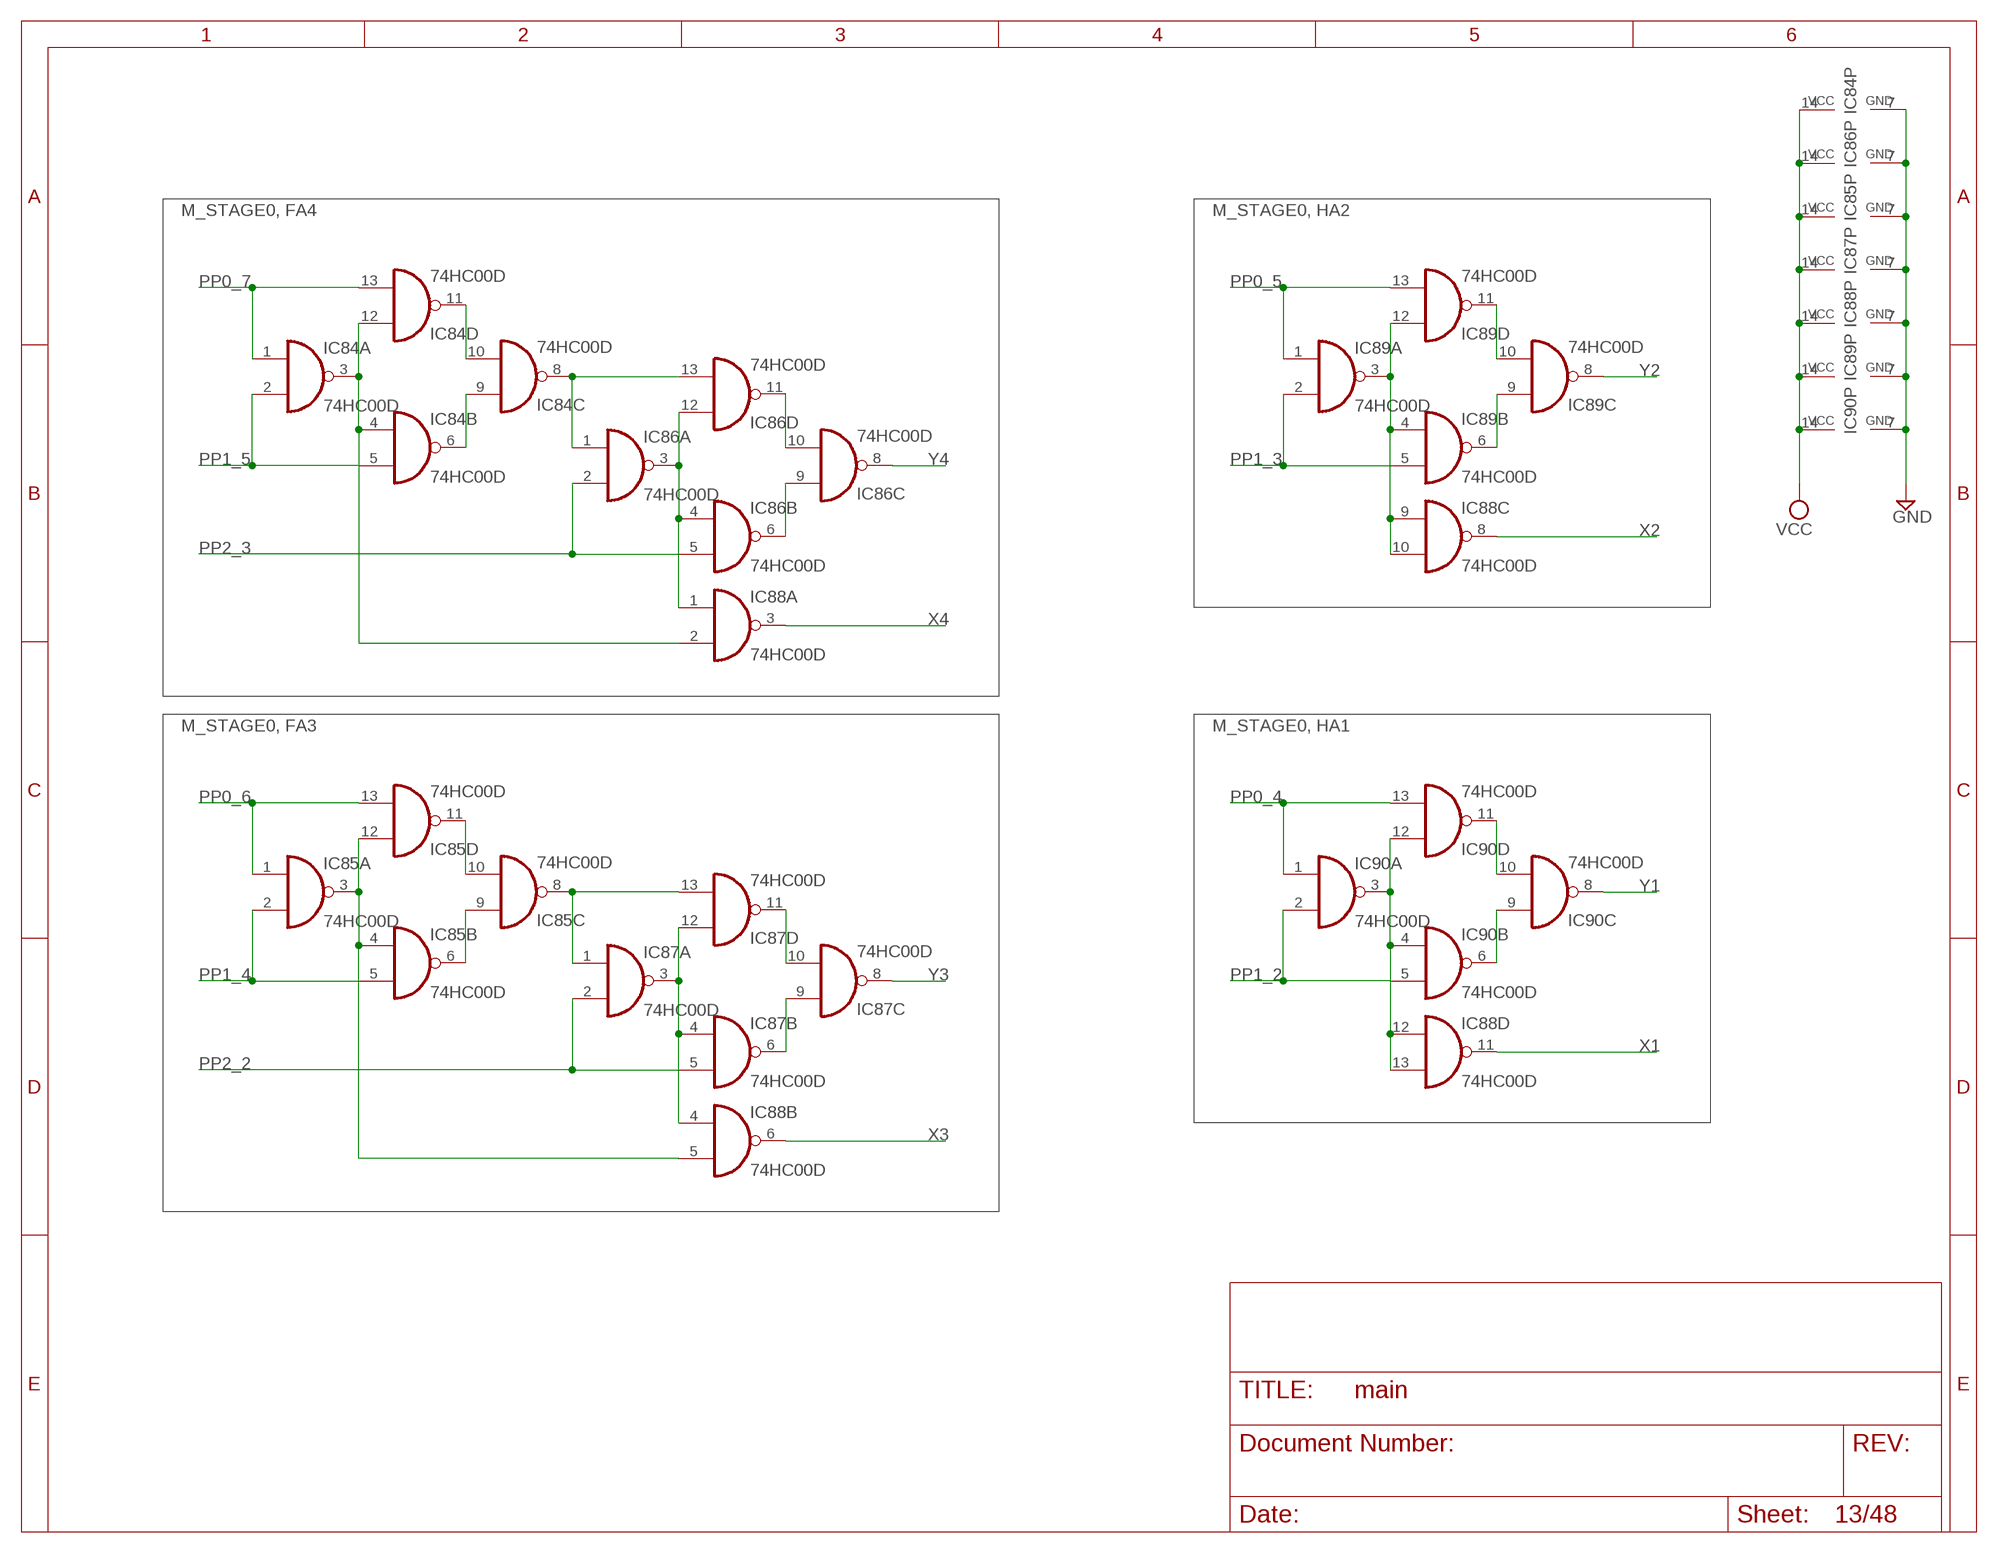
[diagram p12: schematic, sheet 13]

### Parts
IC84  74HC00D  [SO14]
IC85  74HC00D  [SO14]
IC86  74HC00D  [SO14]
IC87  74HC00D  [SO14]
IC88  74HC00D  [SO14]
IC89  74HC00D  [SO14]
IC90  74HC00D  [SO14]

### Nets
GND: IC84.7(P:GND) IC85.7(P:GND) IC86.7(P:GND) IC87.7(P:GND) IC88.7(P:GND) IC89.7(P:GND) IC90.7(P:GND) ; also sheet 1,2,3,4,5,6,7,8,9,10,11,12,14,15,16,17,18,19,20,21,22,23,24,25,26,27,28,29,30,31,32,33,34,37,38,39,40,41,42,43,44,45,46,47
N$251: IC84.3(A:O) IC84.4(B:I0) IC84.12(D:I0) IC88.2(A:I1)
N$252: IC84.10(C:I1) IC84.11(D:O)
N$255: IC84.6(B:O) IC84.9(C:I0)
N$258: IC84.8(C:O) IC86.1(A:I0) IC86.13(D:I1)
N$259: IC86.3(A:O) IC86.4(B:I0) IC86.12(D:I0) IC88.1(A:I0)
N$261: IC86.6(B:O) IC86.9(C:I0)
N$262: IC86.10(C:I1) IC86.11(D:O)
N$267: IC85.3(A:O) IC85.4(B:I0) IC85.12(D:I0) IC88.5(B:I1)
N$275: IC85.6(B:O) IC85.9(C:I0)
N$276: IC85.10(C:I1) IC85.11(D:O)
N$277: IC85.8(C:O) IC87.1(A:I0) IC87.13(D:I1)
N$279: IC87.3(A:O) IC87.4(B:I0) IC87.12(D:I0) IC88.4(B:I0)
N$282: IC87.10(C:I1) IC87.11(D:O)
N$286: IC87.6(B:O) IC87.9(C:I0)
N$298: IC88.12(D:I0) IC88.13(D:I1) IC90.3(A:O) IC90.4(B:I0) IC90.12(D:I0)
N$304: IC90.6(B:O) IC90.9(C:I0)
N$305: IC90.10(C:I1) IC90.11(D:O)
N$309: IC89.6(B:O) IC89.9(C:I0)
N$310: IC89.10(C:I1) IC89.11(D:O)
N$313: IC88.9(C:I0) IC88.10(C:I1) IC89.3(A:O) IC89.4(B:I0) IC89.12(D:I0)
PP0_4: IC90.1(A:I0) IC90.13(D:I1) ; also sheet 4
PP0_5: IC89.1(A:I0) IC89.13(D:I1) ; also sheet 3
PP0_6: IC85.1(A:I0) IC85.13(D:I1) ; also sheet 3
PP0_7: IC84.1(A:I0) IC84.13(D:I1) ; also sheet 3
PP1_2: IC90.2(A:I1) IC90.5(B:I1) ; also sheet 6
PP1_3: IC89.2(A:I1) IC89.5(B:I1) ; also sheet 6
PP1_4: IC85.2(A:I1) IC85.5(B:I1) ; also sheet 6
PP1_5: IC84.2(A:I1) IC84.5(B:I1) ; also sheet 5
PP2_2: IC87.2(A:I1) IC87.5(B:I1) ; also sheet 8
PP2_3: IC86.2(A:I1) IC86.5(B:I1) ; also sheet 8
VCC: IC84.14(P:VCC) IC85.14(P:VCC) IC86.14(P:VCC) IC87.14(P:VCC) IC88.14(P:VCC) IC89.14(P:VCC) IC90.14(P:VCC) ; also sheet 1,2,3,4,5,6,7,8,9,10,11,12,14,15,16,17,18,19,20,21,22,23,24,25,26,27,28,29,30,31,32,33,34,37,38,39,40,41,42,43,44,45,46,47
X1: IC88.11(D:O) ; also sheet 16
X2: IC88.8(C:O) ; also sheet 14
X3: IC88.6(B:O) ; also sheet 15
X4: IC88.3(A:O) ; also sheet 15
Y1: IC90.8(C:O) ; also sheet 16
Y2: IC89.8(C:O) ; also sheet 16
Y3: IC87.8(C:O) ; also sheet 15
Y4: IC86.8(C:O) ; also sheet 15

### Notes on the sheet
- M_STAGE0, FA4 | M_STAGE0, HA2
- M_STAGE0, FA3 | M_STAGE0, HA1

## Sheet 14 of 48: M_STAGE1, 10-7, M_STAGE2, 0
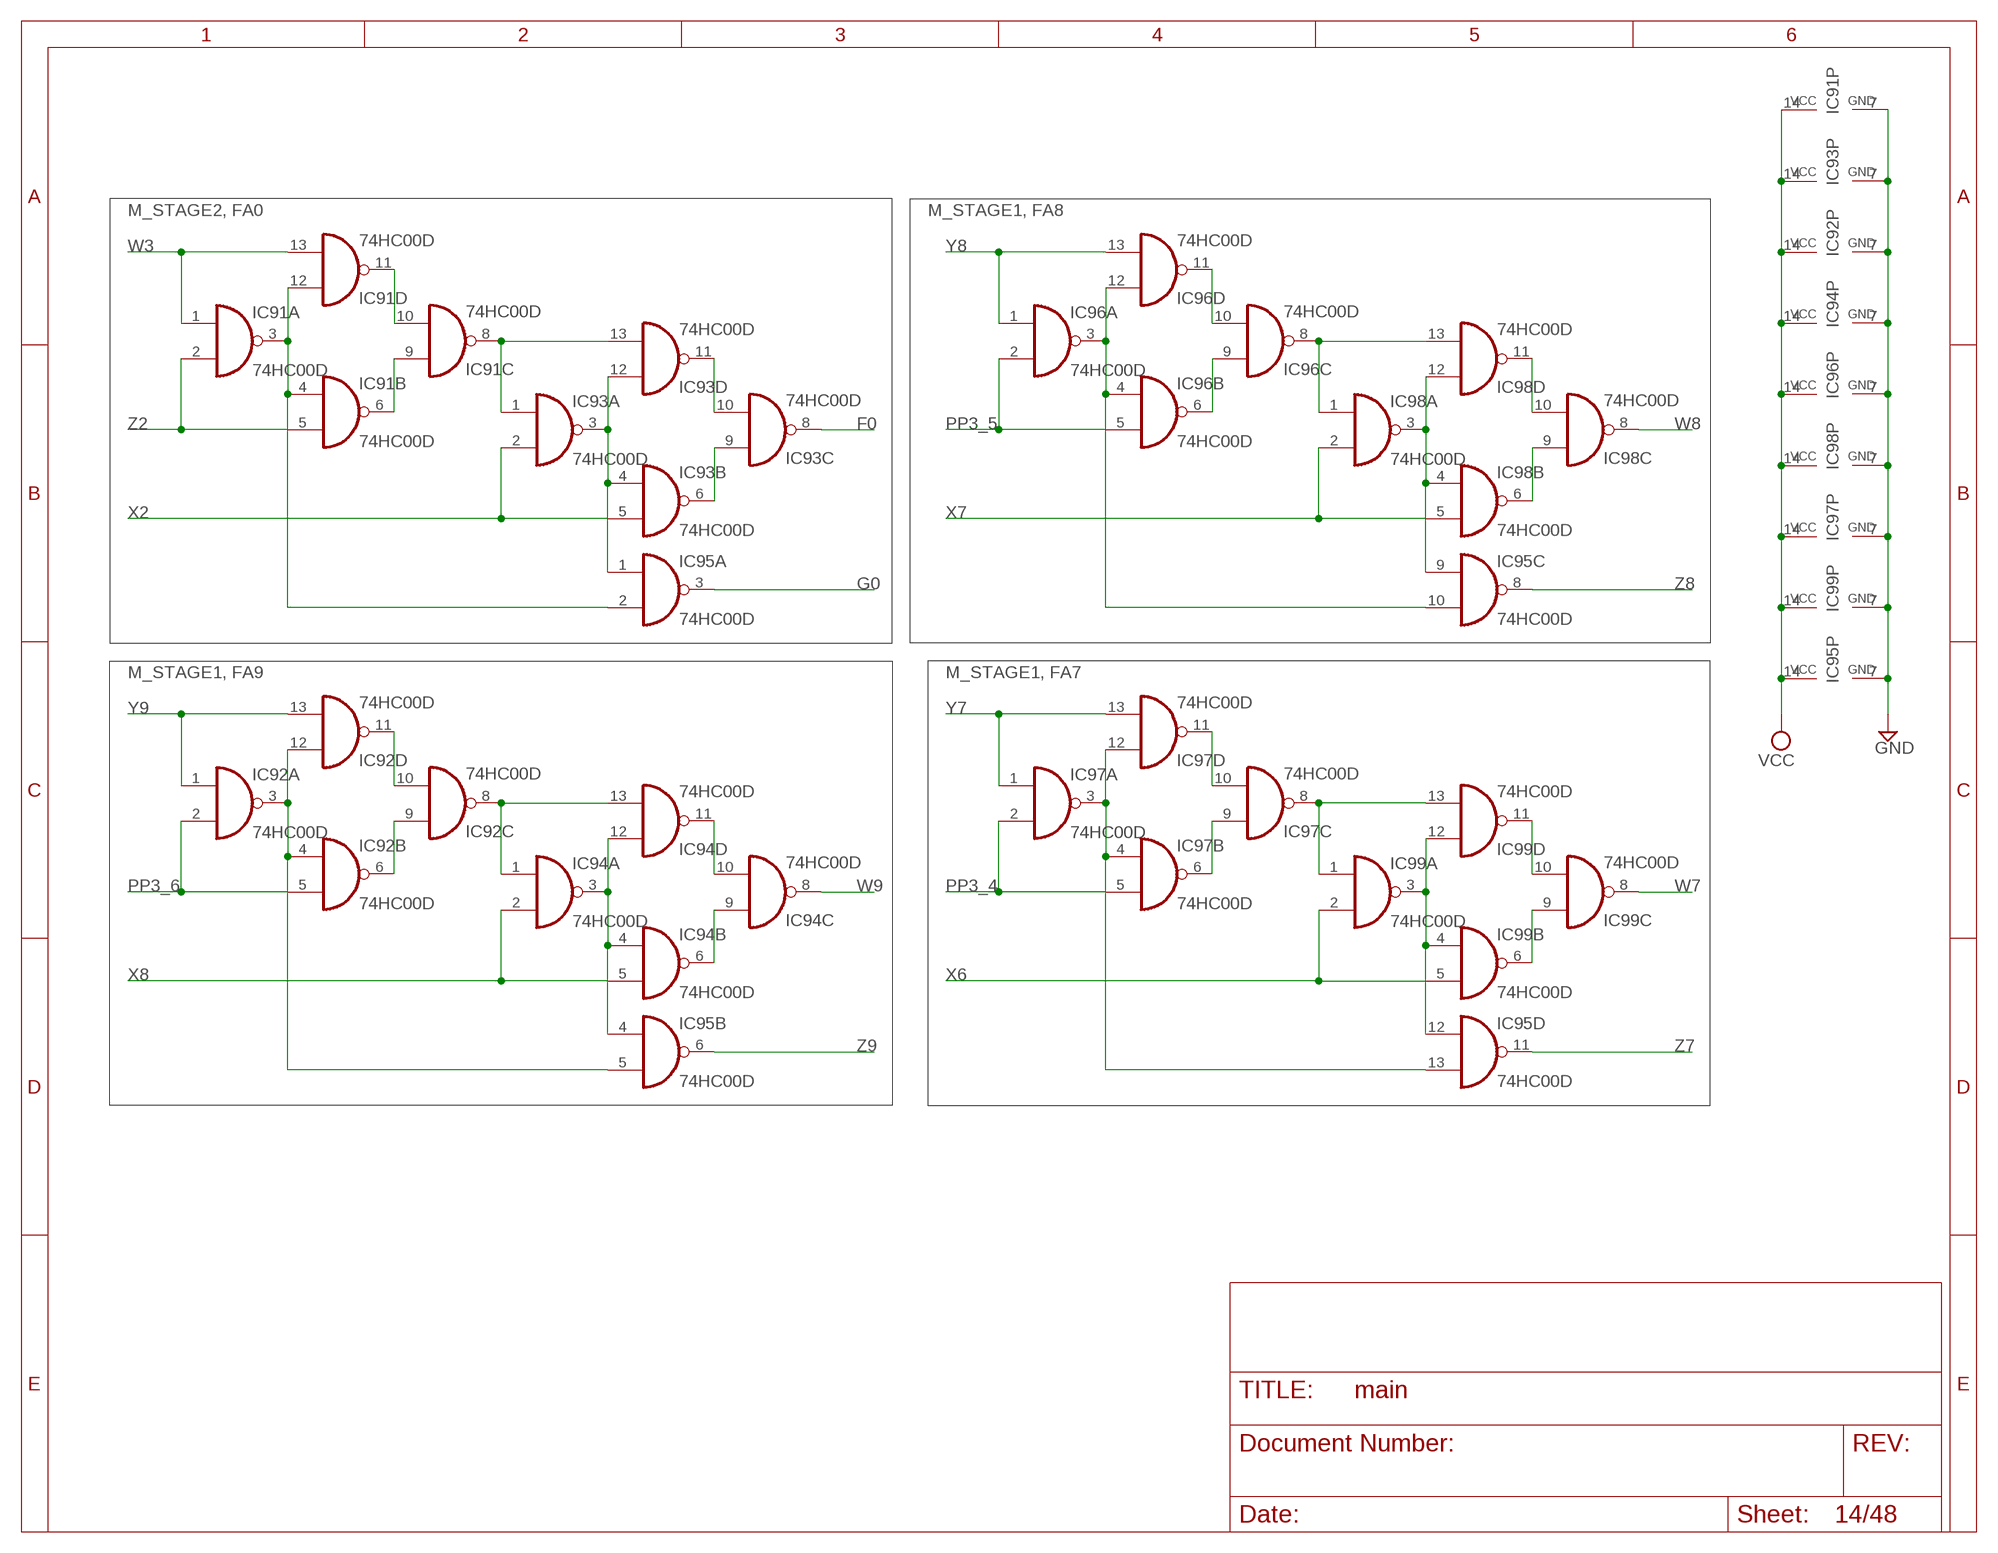
[diagram p13: schematic, sheet 14]

### Parts
IC91  74HC00D  [SO14]
IC92  74HC00D  [SO14]
IC93  74HC00D  [SO14]
IC94  74HC00D  [SO14]
IC95  74HC00D  [SO14]
IC96  74HC00D  [SO14]
IC97  74HC00D  [SO14]
IC98  74HC00D  [SO14]
IC99  74HC00D  [SO14]

### Nets
F0: IC93.8(C:O) ; also sheet 19,23
G0: IC95.3(A:O) ; also sheet 21
GND: IC91.7(P:GND) IC92.7(P:GND) IC93.7(P:GND) IC94.7(P:GND) IC95.7(P:GND) IC96.7(P:GND) IC97.7(P:GND) IC98.7(P:GND) IC99.7(P:GND) ; also sheet 1,2,3,4,5,6,7,8,9,10,11,12,13,15,16,17,18,19,20,21,22,23,24,25,26,27,28,29,30,31,32,33,34,37,38,39,40,41,42,43,44,45,46,47
N$265: IC95.12(D:I0) IC99.3(A:O) IC99.4(B:I0) IC99.12(D:I0)
N$266: IC99.6(B:O) IC99.9(C:I0)
N$291: IC99.10(C:I1) IC99.11(D:O)
N$292: IC97.8(C:O) IC99.1(A:I0) IC99.13(D:I1)
N$306: IC97.6(B:O) IC97.9(C:I0)
N$307: IC97.10(C:I1) IC97.11(D:O)
N$308: IC95.13(D:I1) IC97.3(A:O) IC97.4(B:I0) IC97.12(D:I0)
N$323: IC94.6(B:O) IC94.9(C:I0)
N$327: IC94.10(C:I1) IC94.11(D:O)
N$329: IC94.3(A:O) IC94.4(B:I0) IC94.12(D:I0) IC95.4(B:I0)
N$334: IC92.8(C:O) IC94.1(A:I0) IC94.13(D:I1)
N$335: IC92.6(B:O) IC92.9(C:I0)
N$336: IC92.10(C:I1) IC92.11(D:O)
N$337: IC92.3(A:O) IC92.4(B:I0) IC92.12(D:I0) IC95.5(B:I1)
N$342: IC98.6(B:O) IC98.9(C:I0)
N$343: IC98.10(C:I1) IC98.11(D:O)
N$344: IC95.9(C:I0) IC98.3(A:O) IC98.4(B:I0) IC98.12(D:I0)
N$346: IC96.8(C:O) IC98.1(A:I0) IC98.13(D:I1)
N$349: IC96.6(B:O) IC96.9(C:I0)
N$350: IC96.10(C:I1) IC96.11(D:O)
N$351: IC95.10(C:I1) IC96.3(A:O) IC96.4(B:I0) IC96.12(D:I0)
N$354: IC93.6(B:O) IC93.9(C:I0)
N$355: IC93.10(C:I1) IC93.11(D:O)
N$356: IC93.3(A:O) IC93.4(B:I0) IC93.12(D:I0) IC95.1(A:I0)
N$358: IC91.8(C:O) IC93.1(A:I0) IC93.13(D:I1)
N$359: IC91.6(B:O) IC91.9(C:I0)
N$360: IC91.10(C:I1) IC91.11(D:O)
N$361: IC91.3(A:O) IC91.4(B:I0) IC91.12(D:I0) IC95.2(A:I1)
PP3_4: IC97.2(A:I1) IC97.5(B:I1) ; also sheet 10
PP3_5: IC96.2(A:I1) IC96.5(B:I1) ; also sheet 9
PP3_6: IC92.2(A:I1) IC92.5(B:I1) ; also sheet 9
VCC: IC91.14(P:VCC) IC92.14(P:VCC) IC93.14(P:VCC) IC94.14(P:VCC) IC95.14(P:VCC) IC96.14(P:VCC) IC97.14(P:VCC) IC98.14(P:VCC) IC99.14(P:VCC) ; also sheet 1,2,3,4,5,6,7,8,9,10,11,12,13,15,16,17,18,19,20,21,22,23,24,25,26,27,28,29,30,31,32,33,34,37,38,39,40,41,42,43,44,45,46,47
W3: IC91.1(A:I0) IC91.13(D:I1) ; also sheet 15
W7: IC99.8(C:O) ; also sheet 18
W8: IC98.8(C:O) ; also sheet 17
W9: IC94.8(C:O) ; also sheet 17
X2: IC93.2(A:I1) IC93.5(B:I1) ; also sheet 13
X6: IC99.2(A:I1) IC99.5(B:I1) ; also sheet 12
X7: IC98.2(A:I1) IC98.5(B:I1) ; also sheet 12
X8: IC94.2(A:I1) IC94.5(B:I1) ; also sheet 12
Y7: IC97.1(A:I0) IC97.13(D:I1) ; also sheet 12
Y8: IC96.1(A:I0) IC96.13(D:I1) ; also sheet 12
Y9: IC92.1(A:I0) IC92.13(D:I1) ; also sheet 12
Z2: IC91.2(A:I1) IC91.5(B:I1) ; also sheet 16
Z7: IC95.11(D:O) ; also sheet 17
Z8: IC95.8(C:O) ; also sheet 17
Z9: IC95.6(B:O) ; also sheet 17

### Notes on the sheet
- M_STAGE2, FA0 | M_STAGE1, FA8
- M_STAGE1, FA9 | M_STAGE1, FA7

## Sheet 15 of 48: M_STAGE1, 6-3
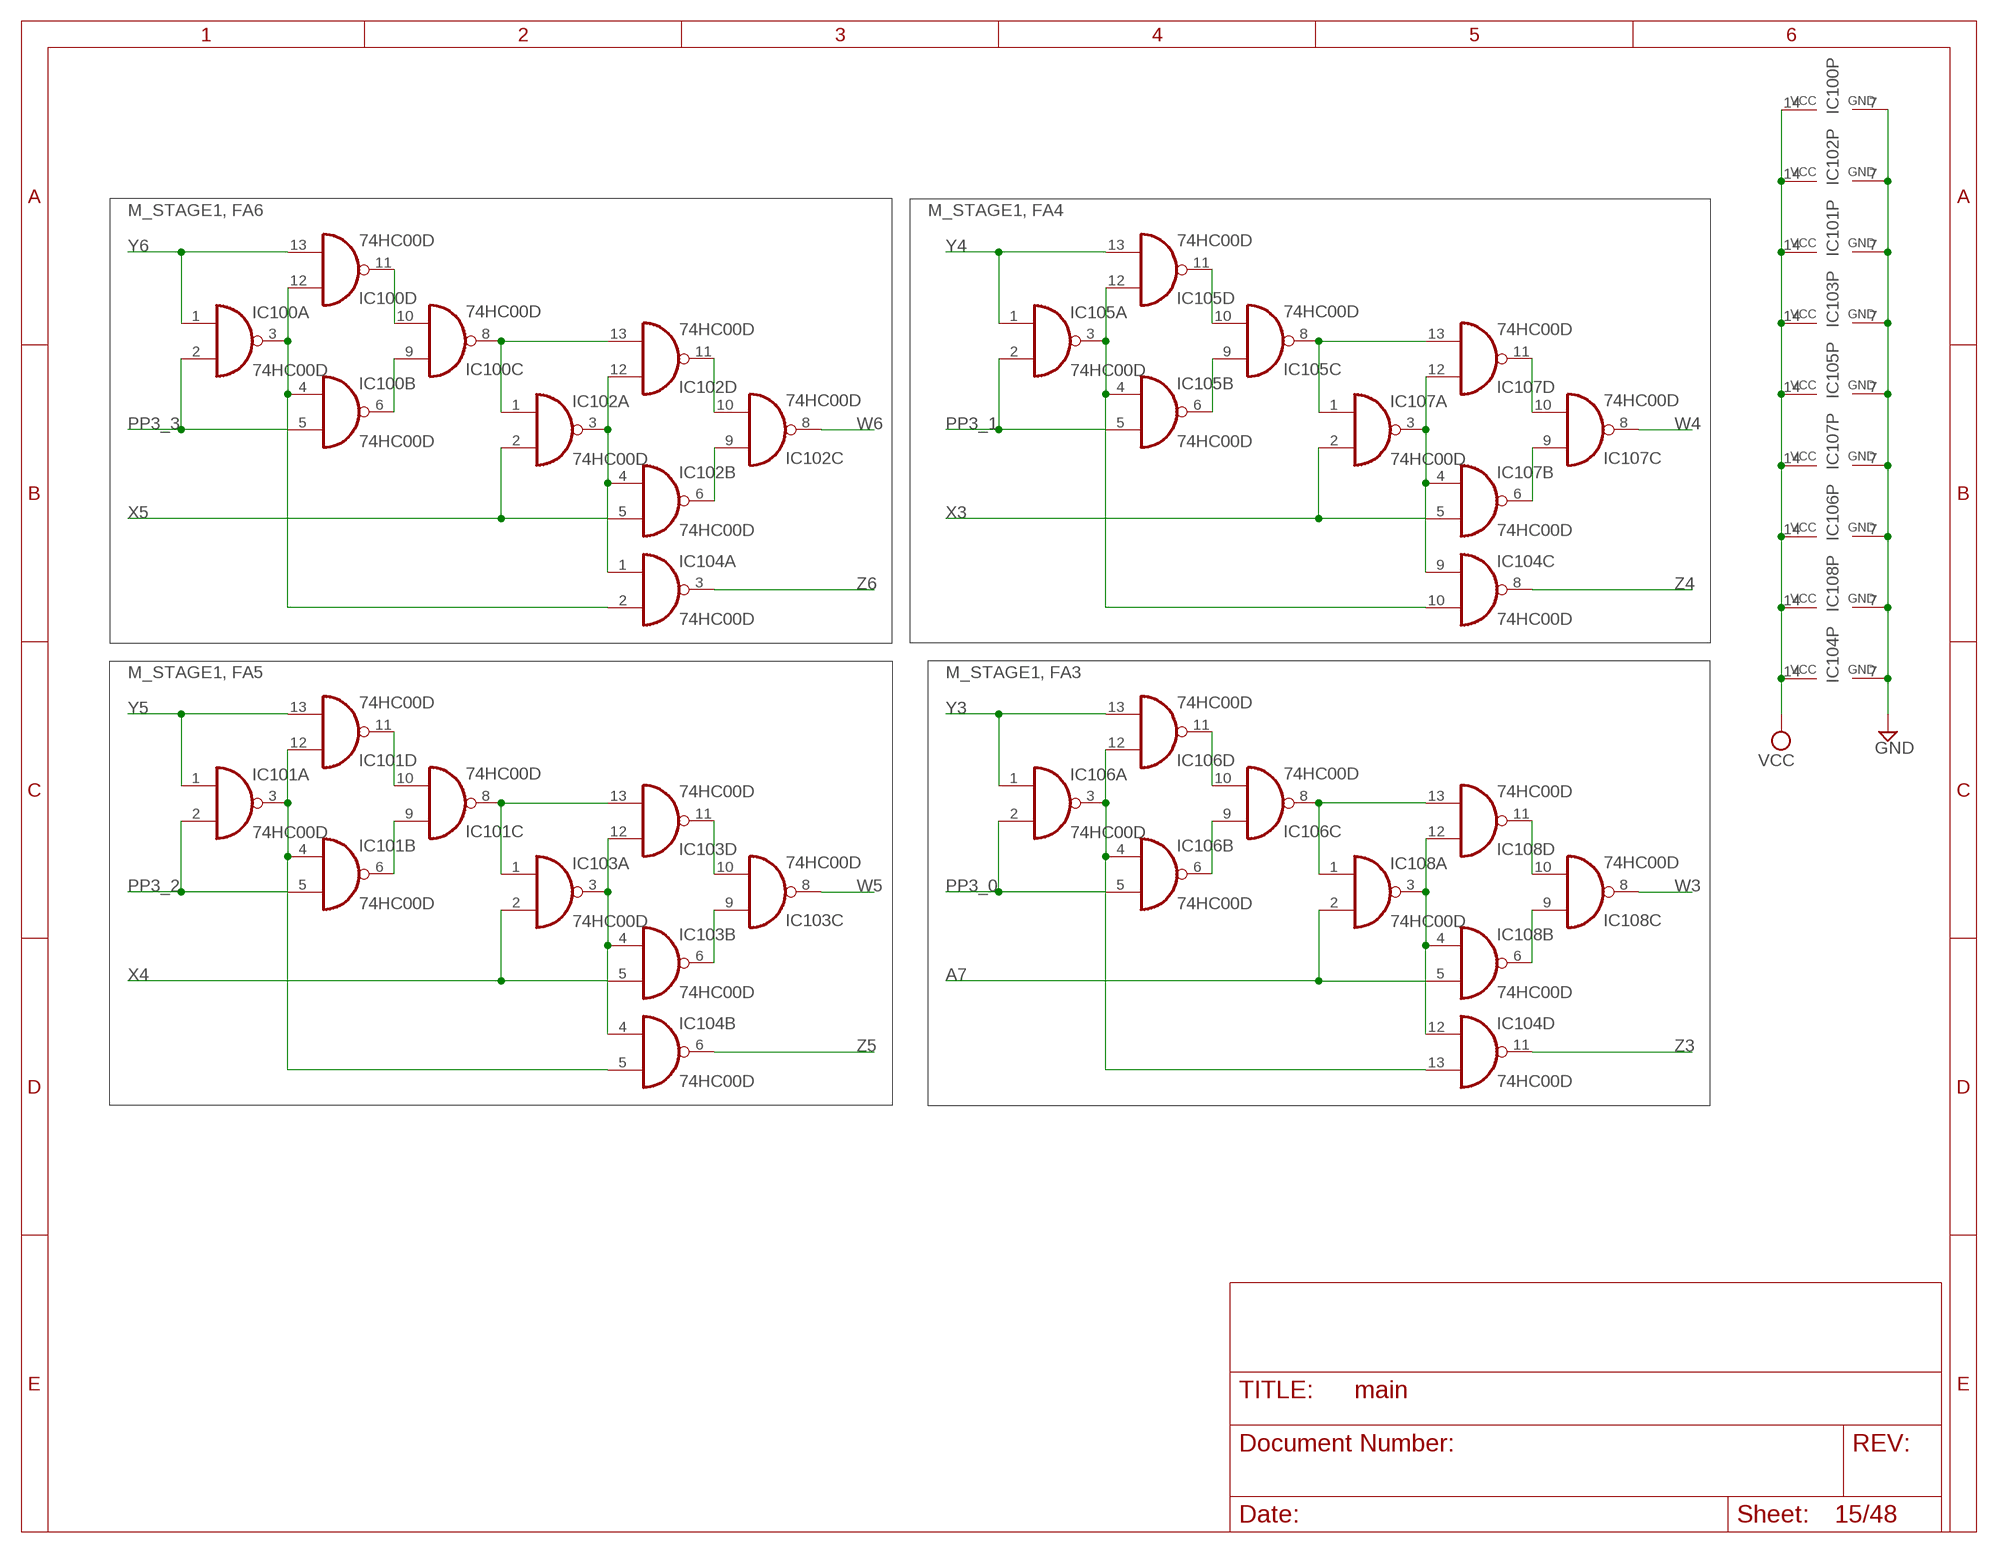
[diagram p14: schematic, sheet 15]

### Parts
IC100  74HC00D  [SO14]
IC101  74HC00D  [SO14]
IC102  74HC00D  [SO14]
IC103  74HC00D  [SO14]
IC104  74HC00D  [SO14]
IC105  74HC00D  [SO14]
IC106  74HC00D  [SO14]
IC107  74HC00D  [SO14]
IC108  74HC00D  [SO14]

### Nets
A7: IC108.2(A:I1) IC108.5(B:I1) ; also sheet 2,9,10,11,24,25,27,30,34,40
GND: IC100.7(P:GND) IC101.7(P:GND) IC102.7(P:GND) IC103.7(P:GND) IC104.7(P:GND) IC105.7(P:GND) IC106.7(P:GND) IC107.7(P:GND) IC108.7(P:GND) ; also sheet 1,2,3,4,5,6,7,8,9,10,11,12,13,14,16,17,18,19,20,21,22,23,24,25,26,27,28,29,30,31,32,33,34,37,38,39,40,41,42,43,44,45,46,47
N$303: IC104.12(D:I0) IC108.3(A:O) IC108.4(B:I0) IC108.12(D:I0)
N$312: IC108.6(B:O) IC108.9(C:I0)
N$314: IC108.10(C:I1) IC108.11(D:O)
N$316: IC106.8(C:O) IC108.1(A:I0) IC108.13(D:I1)
N$320: IC106.6(B:O) IC106.9(C:I0)
N$321: IC106.10(C:I1) IC106.11(D:O)
N$322: IC104.13(D:I1) IC106.3(A:O) IC106.4(B:I0) IC106.12(D:I0)
N$330: IC103.6(B:O) IC103.9(C:I0)
N$338: IC103.10(C:I1) IC103.11(D:O)
N$339: IC103.3(A:O) IC103.4(B:I0) IC103.12(D:I0) IC104.4(B:I0)
N$345: IC101.8(C:O) IC103.1(A:I0) IC103.13(D:I1)
N$347: IC101.6(B:O) IC101.9(C:I0)
N$348: IC101.10(C:I1) IC101.11(D:O)
N$352: IC101.3(A:O) IC101.4(B:I0) IC101.12(D:I0) IC104.5(B:I1)
N$362: IC107.6(B:O) IC107.9(C:I0)
N$363: IC107.10(C:I1) IC107.11(D:O)
N$364: IC104.9(C:I0) IC107.3(A:O) IC107.4(B:I0) IC107.12(D:I0)
N$365: IC105.8(C:O) IC107.1(A:I0) IC107.13(D:I1)
N$366: IC105.6(B:O) IC105.9(C:I0)
N$367: IC105.10(C:I1) IC105.11(D:O)
N$368: IC104.10(C:I1) IC105.3(A:O) IC105.4(B:I0) IC105.12(D:I0)
N$369: IC102.6(B:O) IC102.9(C:I0)
N$370: IC102.10(C:I1) IC102.11(D:O)
N$371: IC102.3(A:O) IC102.4(B:I0) IC102.12(D:I0) IC104.1(A:I0)
N$372: IC100.8(C:O) IC102.1(A:I0) IC102.13(D:I1)
N$373: IC100.6(B:O) IC100.9(C:I0)
N$374: IC100.10(C:I1) IC100.11(D:O)
N$375: IC100.3(A:O) IC100.4(B:I0) IC100.12(D:I0) IC104.2(A:I1)
PP3_0: IC106.2(A:I1) IC106.5(B:I1) ; also sheet 11
PP3_1: IC105.2(A:I1) IC105.5(B:I1) ; also sheet 10
PP3_2: IC101.2(A:I1) IC101.5(B:I1) ; also sheet 10
PP3_3: IC100.2(A:I1) IC100.5(B:I1) ; also sheet 10
VCC: IC100.14(P:VCC) IC101.14(P:VCC) IC102.14(P:VCC) IC103.14(P:VCC) IC104.14(P:VCC) IC105.14(P:VCC) IC106.14(P:VCC) IC107.14(P:VCC) IC108.14(P:VCC) ; also sheet 1,2,3,4,5,6,7,8,9,10,11,12,13,14,16,17,18,19,20,21,22,23,24,25,26,27,28,29,30,31,32,33,34,37,38,39,40,41,42,43,44,45,46,47
W3: IC108.8(C:O) ; also sheet 14
W4: IC107.8(C:O) ; also sheet 18
W5: IC103.8(C:O) ; also sheet 18
W6: IC102.8(C:O) ; also sheet 18
X3: IC107.2(A:I1) IC107.5(B:I1) ; also sheet 13
X4: IC103.2(A:I1) IC103.5(B:I1) ; also sheet 13
X5: IC102.2(A:I1) IC102.5(B:I1) ; also sheet 12
Y3: IC106.1(A:I0) IC106.13(D:I1) ; also sheet 13
Y4: IC105.1(A:I0) IC105.13(D:I1) ; also sheet 13
Y5: IC101.1(A:I0) IC101.13(D:I1) ; also sheet 12
Y6: IC100.1(A:I0) IC100.13(D:I1) ; also sheet 12
Z3: IC104.11(D:O) ; also sheet 18
Z4: IC104.8(C:O) ; also sheet 18
Z5: IC104.6(B:O) ; also sheet 18
Z6: IC104.3(A:O) ; also sheet 18

### Notes on the sheet
- M_STAGE1, FA6 | M_STAGE1, FA4
- M_STAGE1, FA5 | M_STAGE1, FA3

## Sheet 16 of 48: M_STAGE 0, 0, M_STAGE1, 2-1
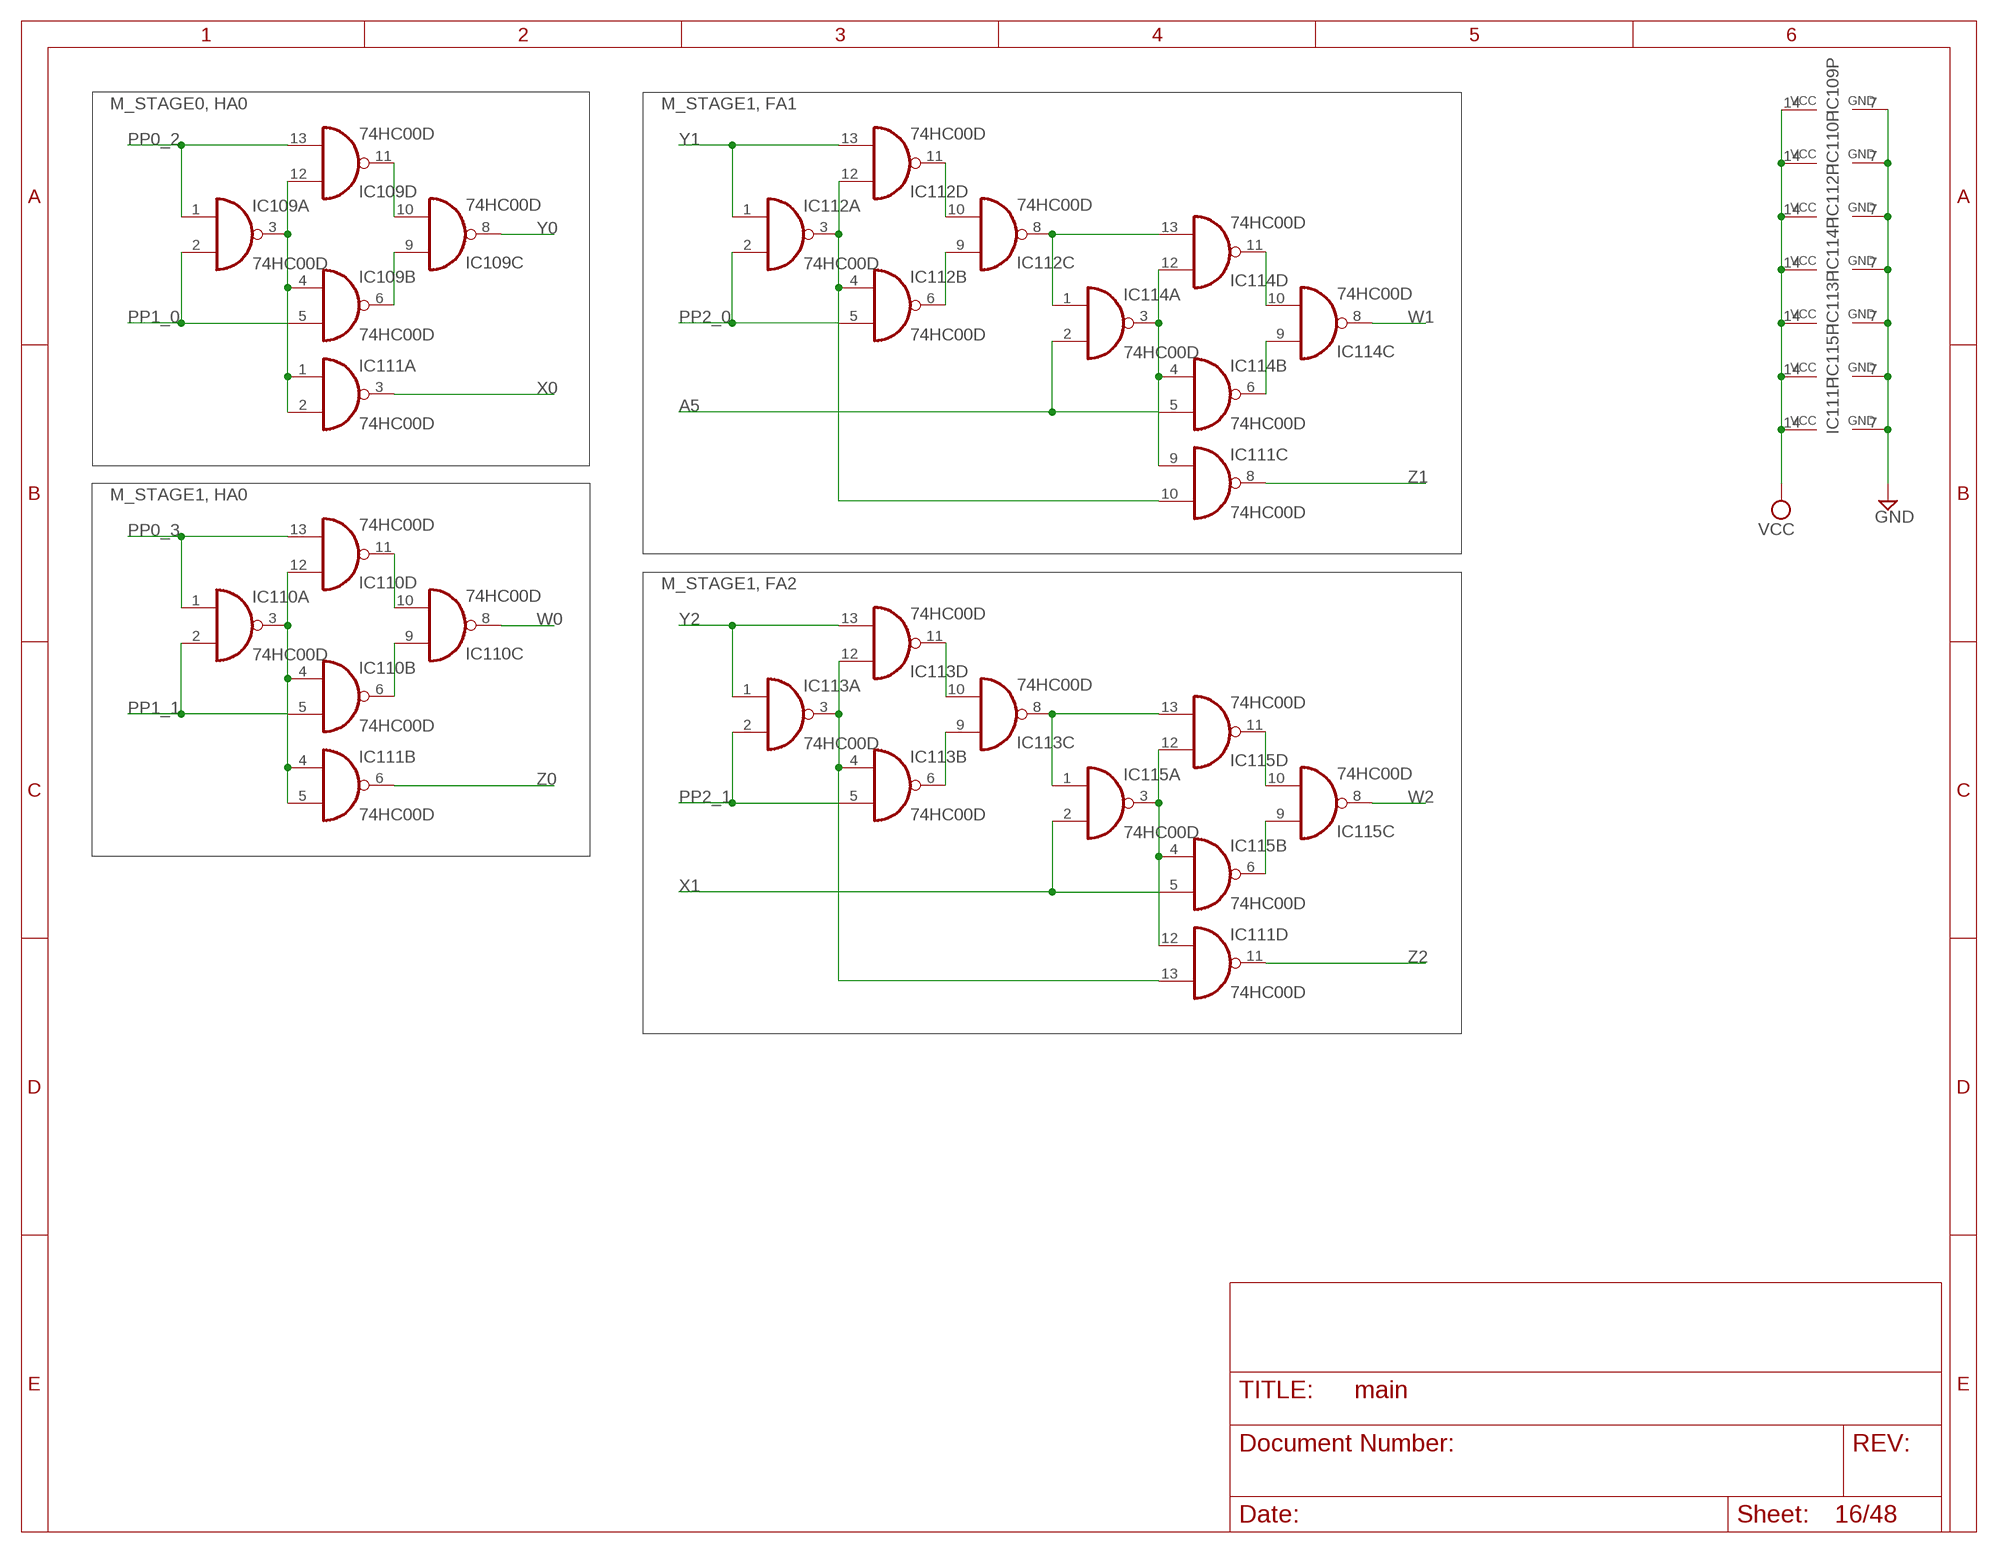
[diagram p15: schematic, sheet 16]

### Parts
IC109  74HC00D  [SO14]
IC110  74HC00D  [SO14]
IC111  74HC00D  [SO14]
IC112  74HC00D  [SO14]
IC113  74HC00D  [SO14]
IC114  74HC00D  [SO14]
IC115  74HC00D  [SO14]

### Nets
A5: IC114.2(A:I1) IC114.5(B:I1) ; also sheet 2,7,8,11,24,25,27,30,34,40
GND: IC109.7(P:GND) IC110.7(P:GND) IC111.7(P:GND) IC112.7(P:GND) IC113.7(P:GND) IC114.7(P:GND) IC115.7(P:GND) ; also sheet 1,2,3,4,5,6,7,8,9,10,11,12,13,14,15,17,18,19,20,21,22,23,24,25,26,27,28,29,30,31,32,33,34,37,38,39,40,41,42,43,44,45,46,47
N$260: IC111.13(D:I1) IC113.3(A:O) IC113.4(B:I0) IC113.12(D:I0)
N$263: IC110.10(C:I1) IC110.11(D:O)
N$264: IC110.6(B:O) IC110.9(C:I0)
N$278: IC110.3(A:O) IC110.4(B:I0) IC110.12(D:I0) IC111.4(B:I0) IC111.5(B:I1)
N$287: IC109.3(A:O) IC109.4(B:I0) IC109.12(D:I0) IC111.1(A:I0) IC111.2(A:I1)
N$290: IC113.6(B:O) IC113.9(C:I0)
N$293: IC109.6(B:O) IC109.9(C:I0)
N$302: IC109.10(C:I1) IC109.11(D:O)
N$311: IC113.10(C:I1) IC113.11(D:O)
N$315: IC113.8(C:O) IC115.1(A:I0) IC115.13(D:I1)
N$317: IC111.12(D:I0) IC115.3(A:O) IC115.4(B:I0) IC115.12(D:I0)
N$318: IC115.6(B:O) IC115.9(C:I0)
N$319: IC115.10(C:I1) IC115.11(D:O)
N$324: IC111.9(C:I0) IC114.3(A:O) IC114.4(B:I0) IC114.12(D:I0)
N$325: IC114.10(C:I1) IC114.11(D:O)
N$326: IC114.6(B:O) IC114.9(C:I0)
N$328: IC112.8(C:O) IC114.1(A:I0) IC114.13(D:I1)
N$331: IC111.10(C:I1) IC112.3(A:O) IC112.4(B:I0) IC112.12(D:I0)
N$332: IC112.6(B:O) IC112.9(C:I0)
N$333: IC112.10(C:I1) IC112.11(D:O)
PP0_2: IC109.1(A:I0) IC109.13(D:I1) ; also sheet 4
PP0_3: IC110.1(A:I0) IC110.13(D:I1) ; also sheet 4
PP1_0: IC109.2(A:I1) IC109.5(B:I1) ; also sheet 11
PP1_1: IC110.2(A:I1) IC110.5(B:I1) ; also sheet 6
PP2_0: IC112.2(A:I1) IC112.5(B:I1) ; also sheet 11
PP2_1: IC113.2(A:I1) IC113.5(B:I1) ; also sheet 8
VCC: IC109.14(P:VCC) IC110.14(P:VCC) IC111.14(P:VCC) IC112.14(P:VCC) IC113.14(P:VCC) IC114.14(P:VCC) IC115.14(P:VCC) ; also sheet 1,2,3,4,5,6,7,8,9,10,11,12,13,14,15,17,18,19,20,21,22,23,24,25,26,27,28,29,30,31,32,33,34,37,38,39,40,41,42,43,44,45,46,47
W0: IC110.8(C:O) ; also sheet 22
W1: IC114.8(C:O) ; also sheet 22
W2: IC115.8(C:O) ; also sheet 22
X0: IC111.3(A:O) ; also sheet 22
X1: IC115.2(A:I1) IC115.5(B:I1) ; also sheet 13
Y0: IC109.8(C:O) ; also sheet 22
Y1: IC112.1(A:I0) IC112.13(D:I1) ; also sheet 13
Y2: IC113.1(A:I0) IC113.13(D:I1) ; also sheet 13
Z0: IC111.6(B:O) ; also sheet 22
Z1: IC111.8(C:O) ; also sheet 22
Z2: IC111.11(D:O) ; also sheet 14

### Notes on the sheet
- M_STAGE0, HA0 | M_STAGE1, FA1
- M_STAGE1, HA0
- M_STAGE1, FA2

## Sheet 17 of 48: M_STAGE2, 8-5
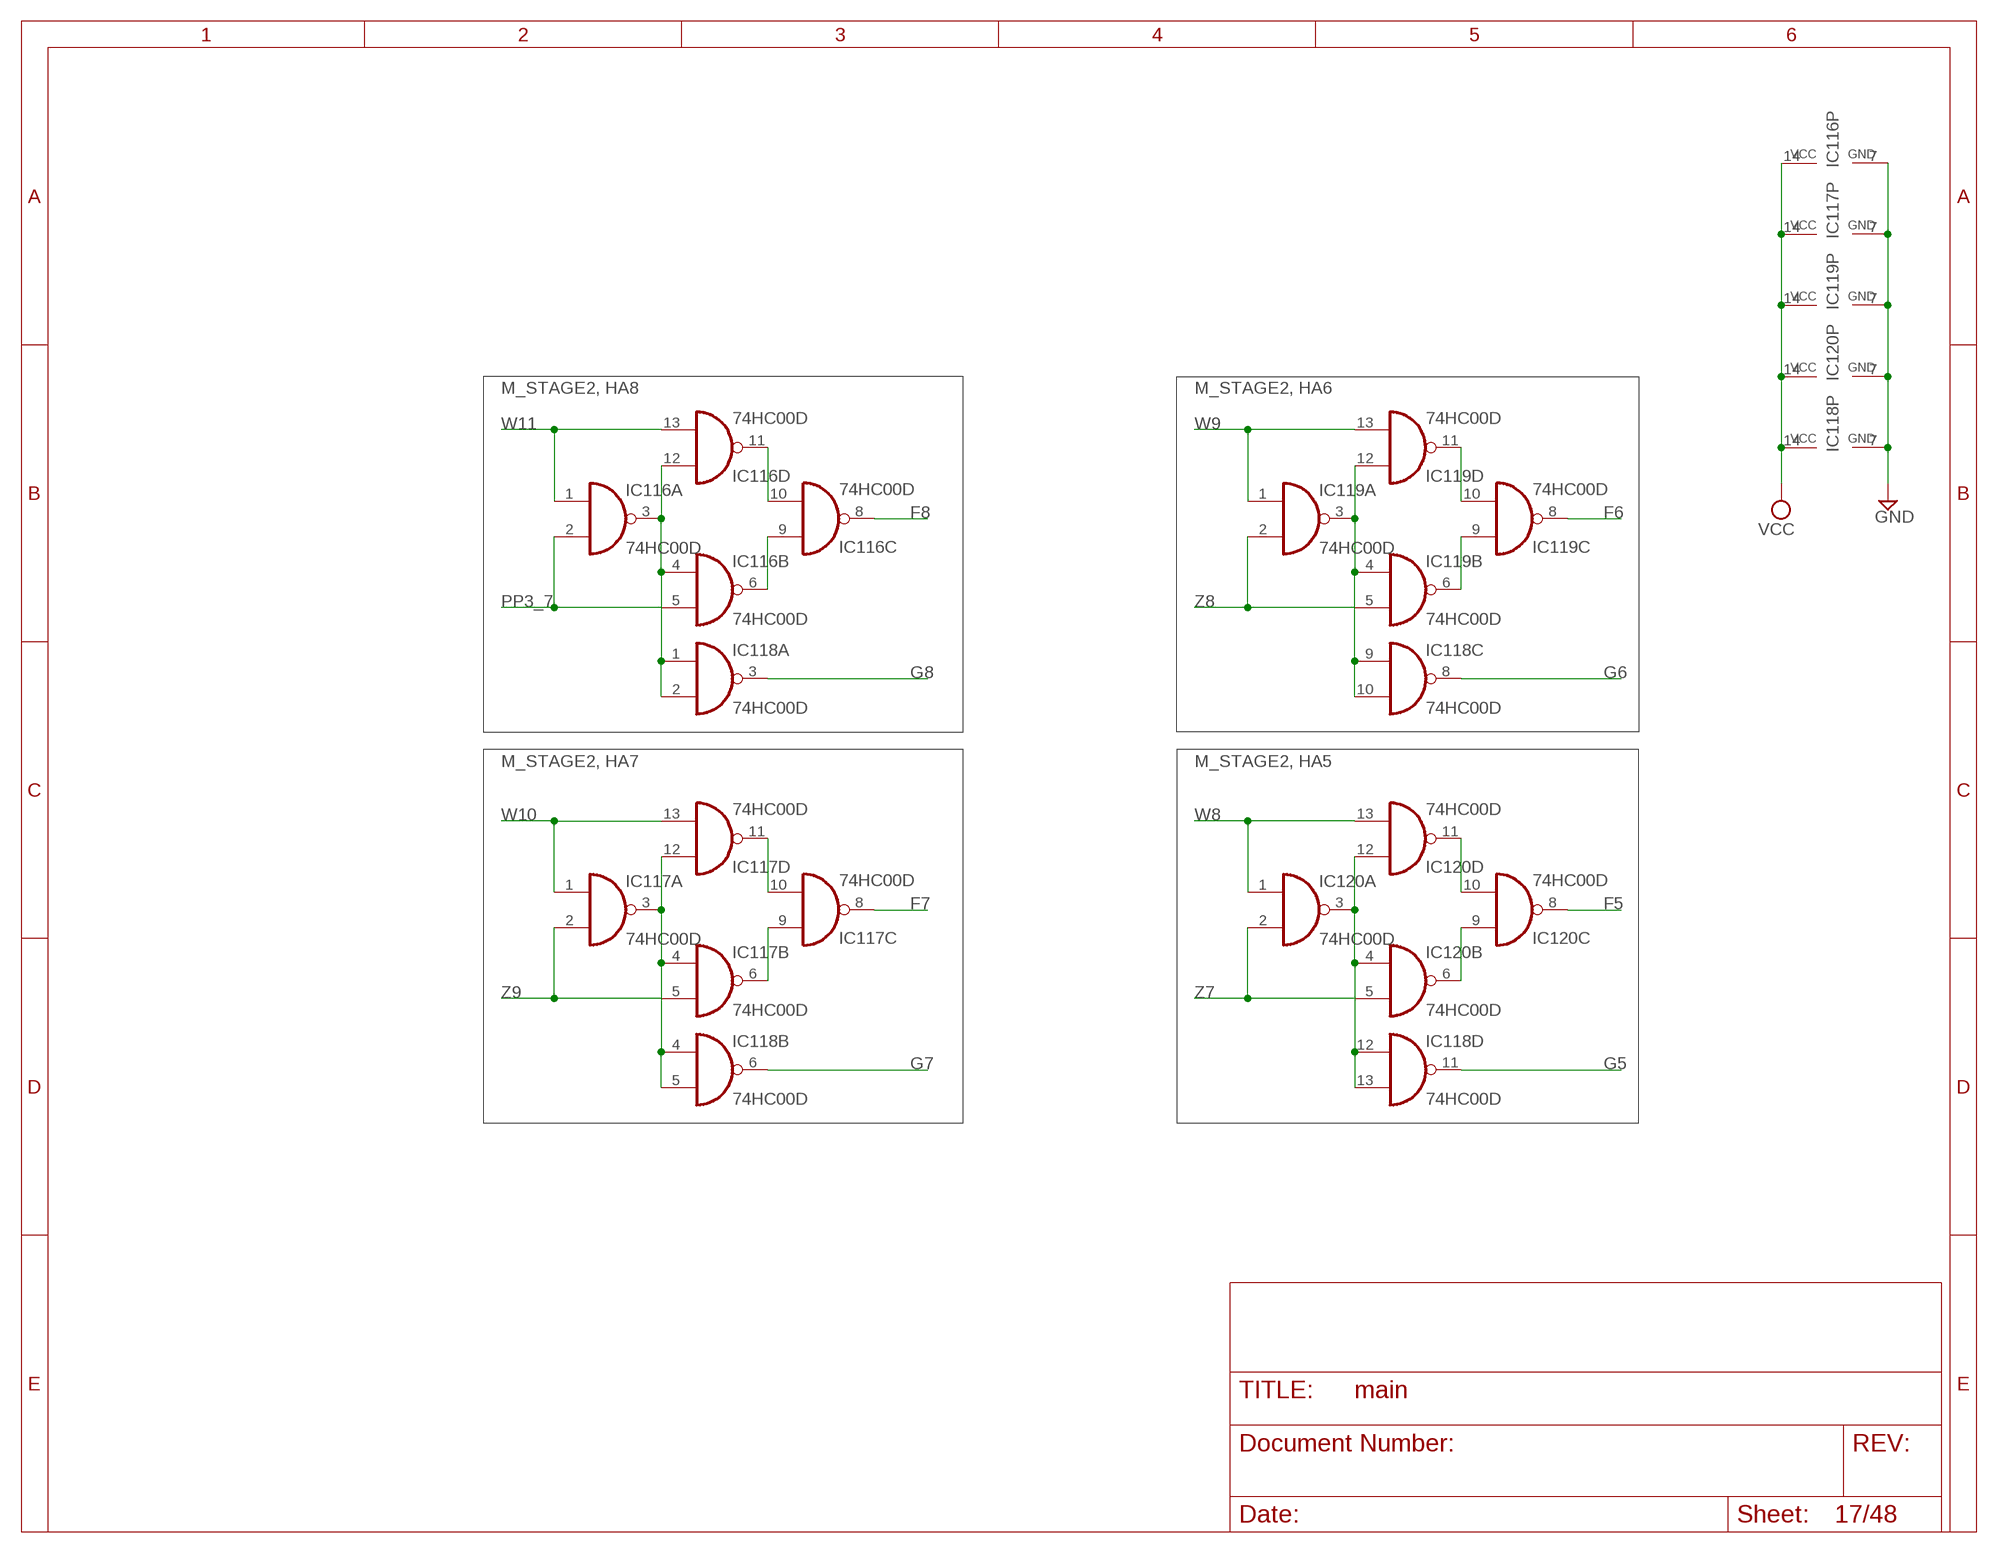
[diagram p16: schematic, sheet 17]

### Parts
IC116  74HC00D  [SO14]
IC117  74HC00D  [SO14]
IC118  74HC00D  [SO14]
IC119  74HC00D  [SO14]
IC120  74HC00D  [SO14]

### Nets
F5: IC120.8(C:O) ; also sheet 20
F6: IC119.8(C:O) ; also sheet 20
F7: IC117.8(C:O) ; also sheet 20
F8: IC116.8(C:O) ; also sheet 20
G5: IC118.11(D:O) ; also sheet 20
G6: IC118.8(C:O) ; also sheet 20
G7: IC118.6(B:O) ; also sheet 20
G8: IC118.3(A:O) ; also sheet 23
GND: IC116.7(P:GND) IC117.7(P:GND) IC118.7(P:GND) IC119.7(P:GND) IC120.7(P:GND) ; also sheet 1,2,3,4,5,6,7,8,9,10,11,12,13,14,15,16,18,19,20,21,22,23,24,25,26,27,28,29,30,31,32,33,34,37,38,39,40,41,42,43,44,45,46,47
N$376: IC116.3(A:O) IC116.4(B:I0) IC116.12(D:I0) IC118.1(A:I0) IC118.2(A:I1)
N$378: IC116.10(C:I1) IC116.11(D:O)
N$379: IC116.6(B:O) IC116.9(C:I0)
N$380: IC117.10(C:I1) IC117.11(D:O)
N$381: IC117.6(B:O) IC117.9(C:I0)
N$385: IC117.3(A:O) IC117.4(B:I0) IC117.12(D:I0) IC118.4(B:I0) IC118.5(B:I1)
N$386: IC118.12(D:I0) IC118.13(D:I1) IC120.3(A:O) IC120.4(B:I0) IC120.12(D:I0)
N$389: IC120.6(B:O) IC120.9(C:I0)
N$390: IC120.10(C:I1) IC120.11(D:O)
N$394: IC119.6(B:O) IC119.9(C:I0)
N$395: IC119.10(C:I1) IC119.11(D:O)
N$396: IC118.9(C:I0) IC118.10(C:I1) IC119.3(A:O) IC119.4(B:I0) IC119.12(D:I0)
PP3_7: IC116.2(A:I1) IC116.5(B:I1) ; also sheet 9,12
VCC: IC116.14(P:VCC) IC117.14(P:VCC) IC118.14(P:VCC) IC119.14(P:VCC) IC120.14(P:VCC) ; also sheet 1,2,3,4,5,6,7,8,9,10,11,12,13,14,15,16,18,19,20,21,22,23,24,25,26,27,28,29,30,31,32,33,34,37,38,39,40,41,42,43,44,45,46,47
W8: IC120.1(A:I0) IC120.13(D:I1) ; also sheet 14
W9: IC119.1(A:I0) IC119.13(D:I1) ; also sheet 14
W10: IC117.1(A:I0) IC117.13(D:I1) ; also sheet 12
W11: IC116.1(A:I0) IC116.13(D:I1) ; also sheet 12
Z7: IC120.2(A:I1) IC120.5(B:I1) ; also sheet 14
Z8: IC119.2(A:I1) IC119.5(B:I1) ; also sheet 14
Z9: IC117.2(A:I1) IC117.5(B:I1) ; also sheet 14

### Notes on the sheet
- M_STAGE2, HA8 | M_STAGE2, HA6
- M_STAGE2, HA7 | M_STAGE2, HA5

## Sheet 18 of 48: M_STAGE2, 4-1
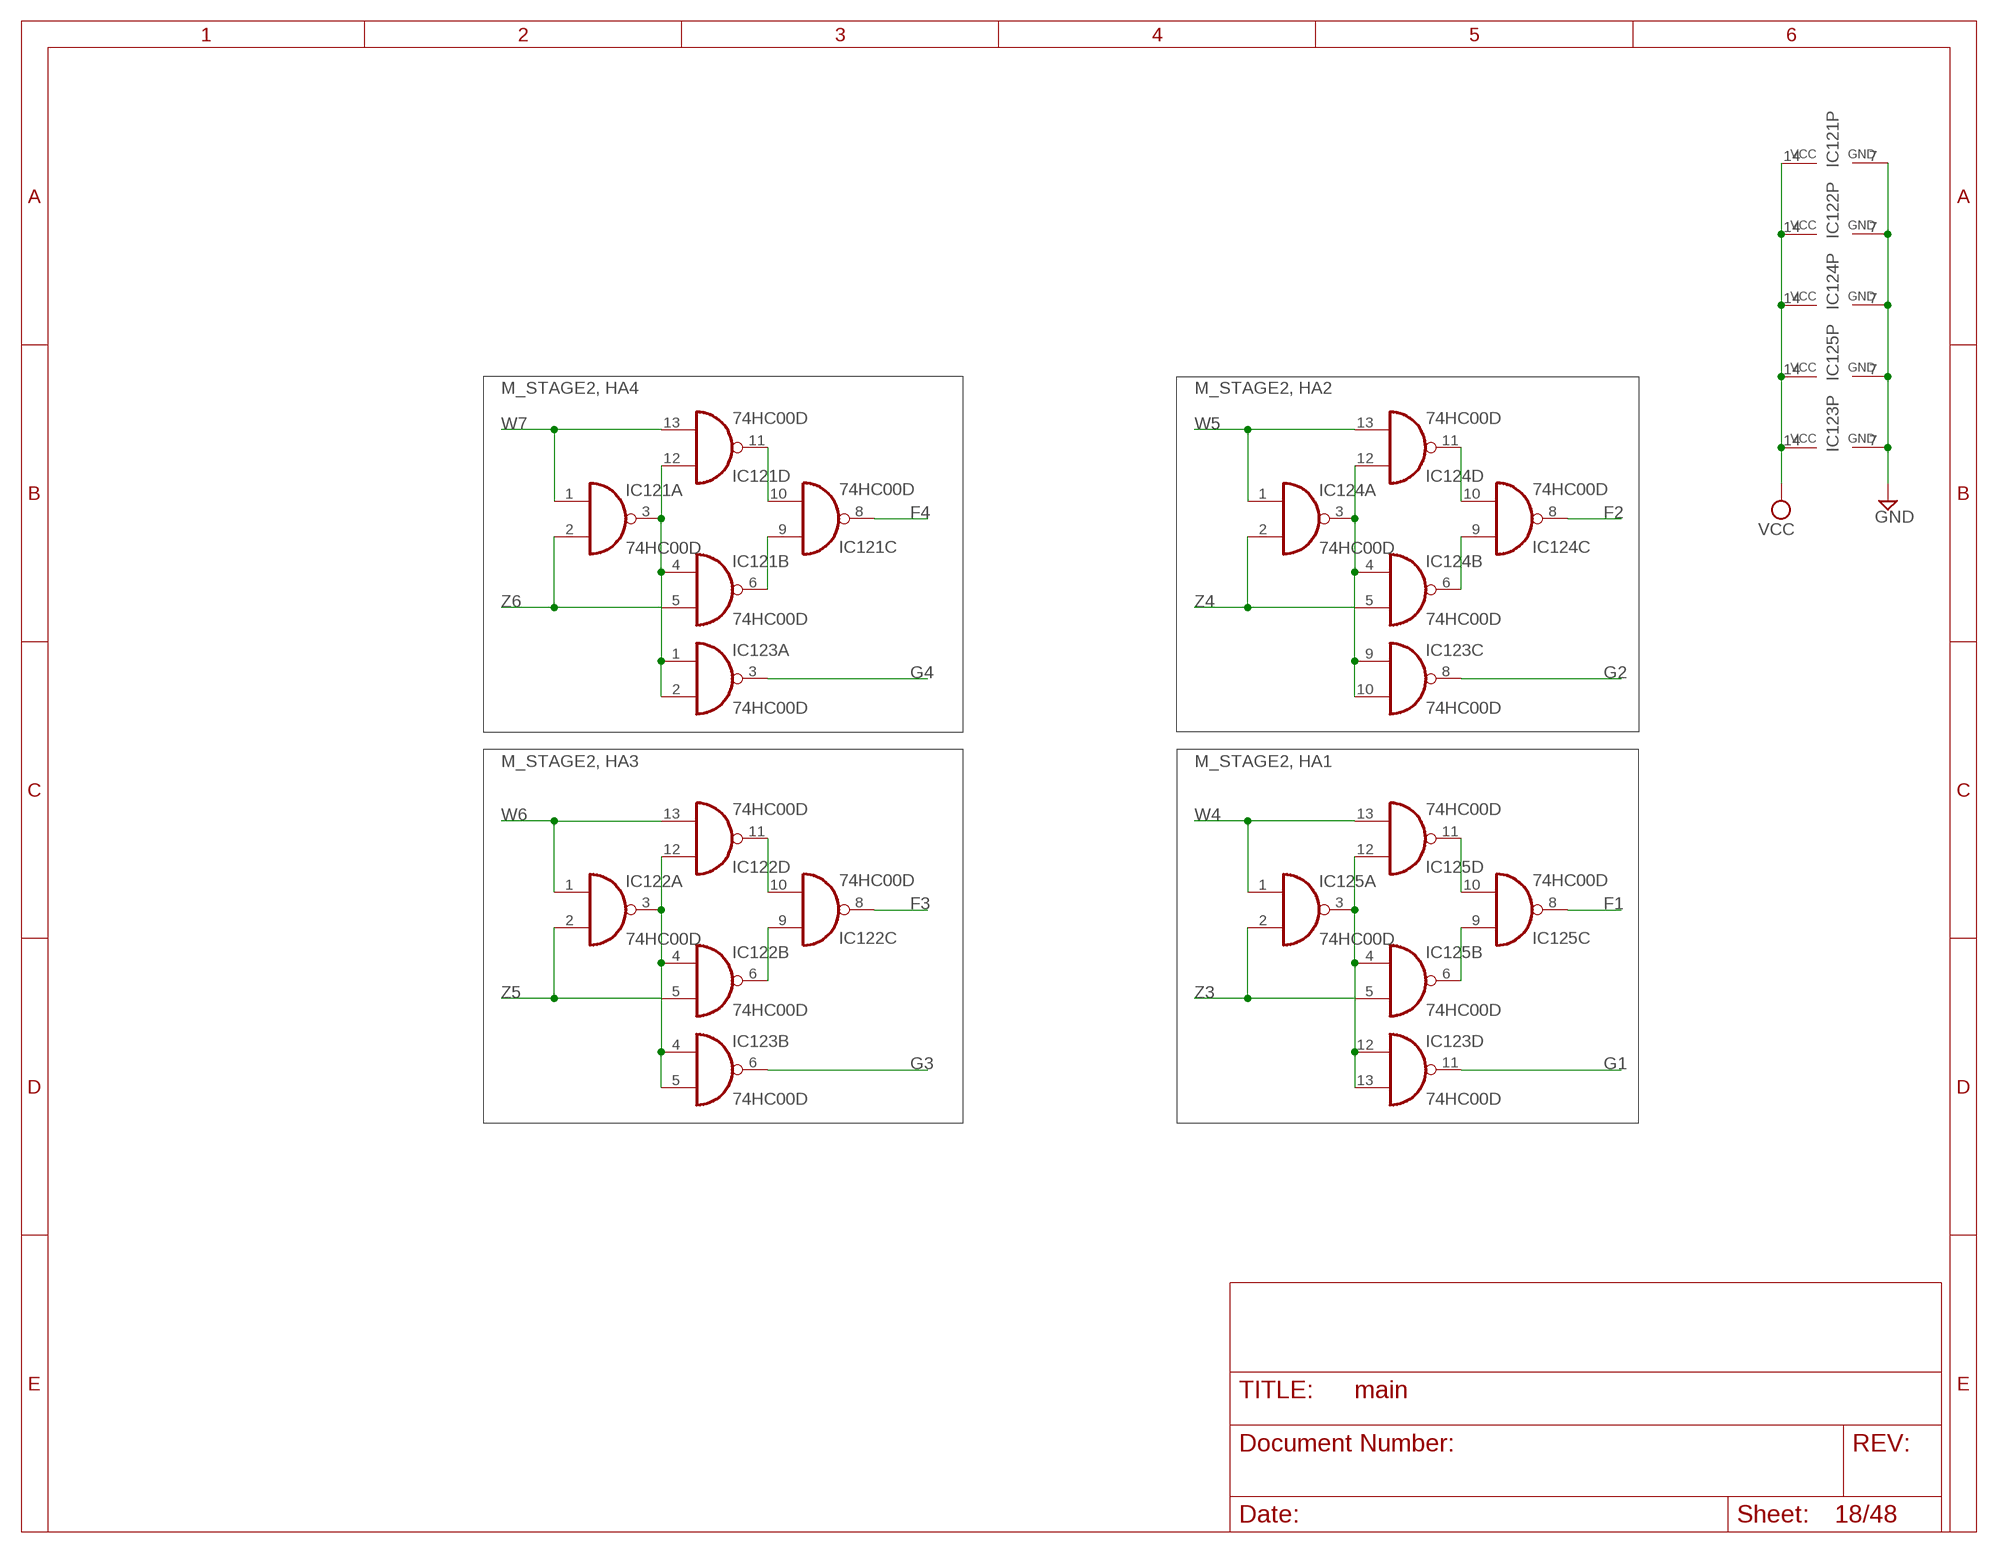
[diagram p17: schematic, sheet 18]

### Parts
IC121  74HC00D  [SO14]
IC122  74HC00D  [SO14]
IC123  74HC00D  [SO14]
IC124  74HC00D  [SO14]
IC125  74HC00D  [SO14]

### Nets
F1: IC125.8(C:O) ; also sheet 21
F2: IC124.8(C:O) ; also sheet 21
F3: IC122.8(C:O) ; also sheet 21
F4: IC121.8(C:O) ; also sheet 21
G1: IC123.11(D:O) ; also sheet 21
G2: IC123.8(C:O) ; also sheet 21
G3: IC123.6(B:O) ; also sheet 21
G4: IC123.3(A:O) ; also sheet 20
GND: IC121.7(P:GND) IC122.7(P:GND) IC123.7(P:GND) IC124.7(P:GND) IC125.7(P:GND) ; also sheet 1,2,3,4,5,6,7,8,9,10,11,12,13,14,15,16,17,19,20,21,22,23,24,25,26,27,28,29,30,31,32,33,34,37,38,39,40,41,42,43,44,45,46,47
N$393: IC121.3(A:O) IC121.4(B:I0) IC121.12(D:I0) IC123.1(A:I0) IC123.2(A:I1)
N$397: IC121.10(C:I1) IC121.11(D:O)
N$398: IC121.6(B:O) IC121.9(C:I0)
N$399: IC122.10(C:I1) IC122.11(D:O)
N$400: IC122.6(B:O) IC122.9(C:I0)
N$401: IC122.3(A:O) IC122.4(B:I0) IC122.12(D:I0) IC123.4(B:I0) IC123.5(B:I1)
N$402: IC123.12(D:I0) IC123.13(D:I1) IC125.3(A:O) IC125.4(B:I0) IC125.12(D:I0)
N$403: IC125.6(B:O) IC125.9(C:I0)
N$404: IC125.10(C:I1) IC125.11(D:O)
N$405: IC124.6(B:O) IC124.9(C:I0)
N$406: IC124.10(C:I1) IC124.11(D:O)
N$407: IC123.9(C:I0) IC123.10(C:I1) IC124.3(A:O) IC124.4(B:I0) IC124.12(D:I0)
VCC: IC121.14(P:VCC) IC122.14(P:VCC) IC123.14(P:VCC) IC124.14(P:VCC) IC125.14(P:VCC) ; also sheet 1,2,3,4,5,6,7,8,9,10,11,12,13,14,15,16,17,19,20,21,22,23,24,25,26,27,28,29,30,31,32,33,34,37,38,39,40,41,42,43,44,45,46,47
W4: IC125.1(A:I0) IC125.13(D:I1) ; also sheet 15
W5: IC124.1(A:I0) IC124.13(D:I1) ; also sheet 15
W6: IC122.1(A:I0) IC122.13(D:I1) ; also sheet 15
W7: IC121.1(A:I0) IC121.13(D:I1) ; also sheet 14
Z3: IC125.2(A:I1) IC125.5(B:I1) ; also sheet 15
Z4: IC124.2(A:I1) IC124.5(B:I1) ; also sheet 15
Z5: IC122.2(A:I1) IC122.5(B:I1) ; also sheet 15
Z6: IC121.2(A:I1) IC121.5(B:I1) ; also sheet 15

### Notes on the sheet
- M_STAGE2, HA4 | M_STAGE2, HA2
- M_STAGE2, HA3 | M_STAGE2, HA1

## Sheet 19 of 48: CLA_MULT 0, 1, 6
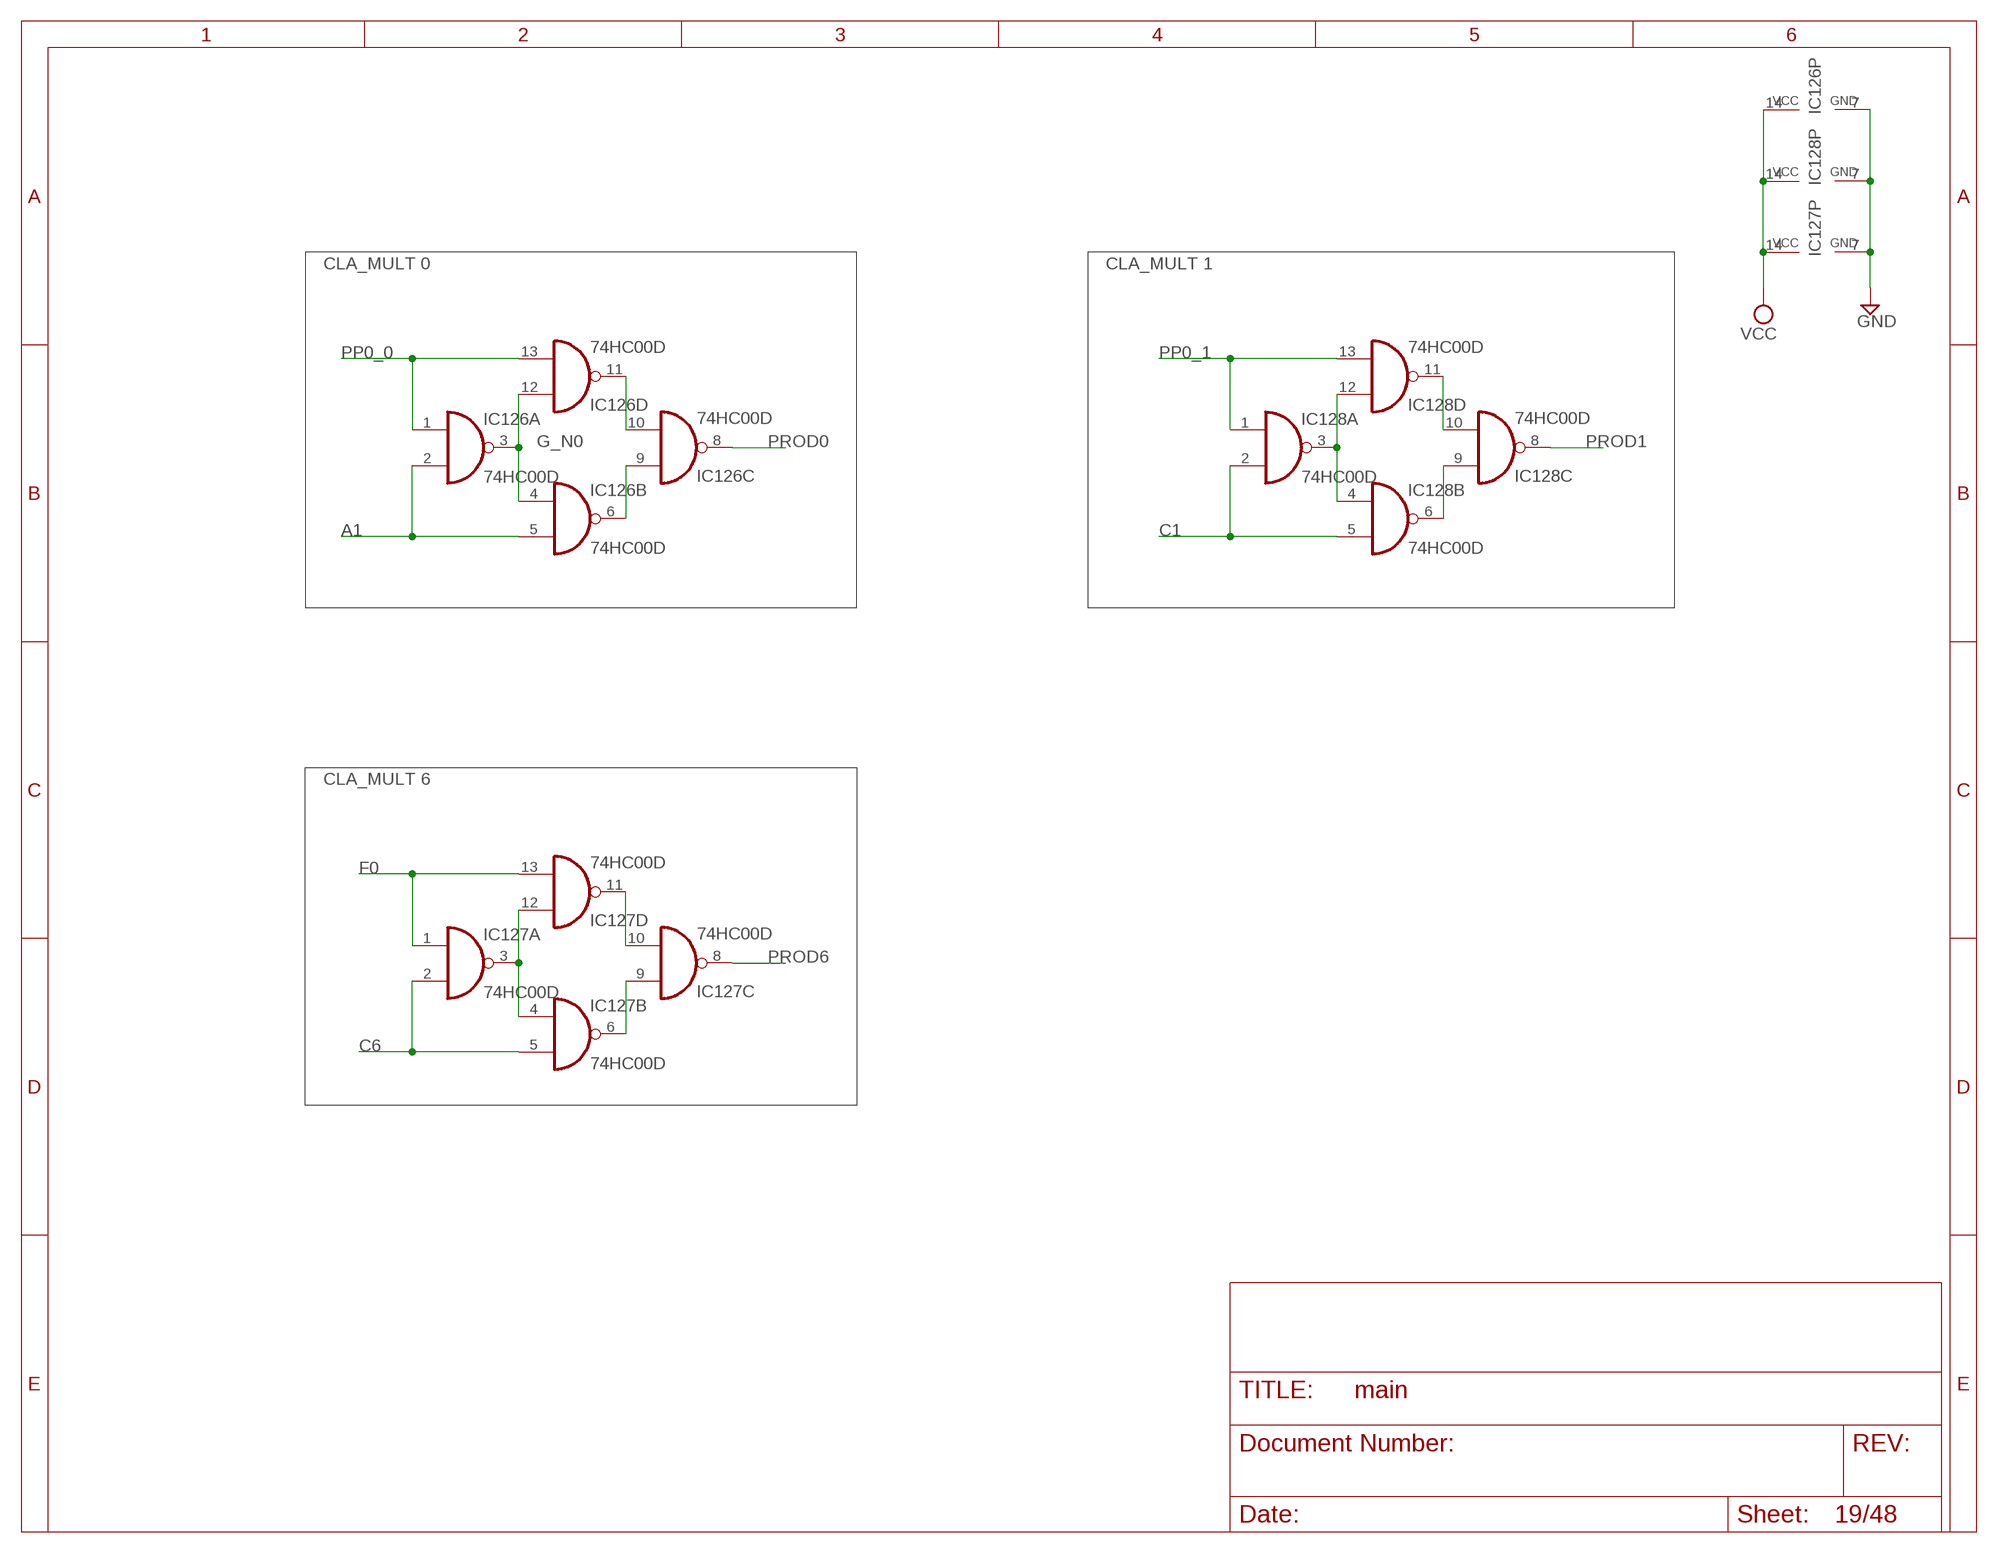
[diagram p18: schematic, sheet 19]

### Parts
IC126  74HC00D  [SO14]
IC127  74HC00D  [SO14]
IC128  74HC00D  [SO14]

### Nets
A1: IC126.2(A:I1) IC126.5(B:I1) ; also sheet 1,3,4,11,24,25,26,30,34,41
C1: IC128.2(A:I1) IC128.5(B:I1) ; also sheet 23
C6: IC127.2(A:I1) IC127.5(B:I1) ; also sheet 23
F0: IC127.1(A:I0) IC127.13(D:I1) ; also sheet 14,23
G_N0: IC126.3(A:O) IC126.4(B:I0) IC126.12(D:I0) ; also sheet 23
GND: IC126.7(P:GND) IC127.7(P:GND) IC128.7(P:GND) ; also sheet 1,2,3,4,5,6,7,8,9,10,11,12,13,14,15,16,17,18,20,21,22,23,24,25,26,27,28,29,30,31,32,33,34,37,38,39,40,41,42,43,44,45,46,47
N$340: IC127.10(C:I1) IC127.11(D:O)
N$341: IC126.10(C:I1) IC126.11(D:O)
N$353: IC126.6(B:O) IC126.9(C:I0)
N$357: IC128.3(A:O) IC128.4(B:I0) IC128.12(D:I0)
N$377: IC127.6(B:O) IC127.9(C:I0)
N$382: IC128.6(B:O) IC128.9(C:I0)
N$383: IC128.10(C:I1) IC128.11(D:O)
N$384: IC127.3(A:O) IC127.4(B:I0) IC127.12(D:I0)
PP0_0: IC126.1(A:I0) IC126.13(D:I1) ; also sheet 11
PP0_1: IC128.1(A:I0) IC128.13(D:I1) ; also sheet 4,23
PROD0: IC126.8(C:O) ; also sheet 45
PROD1: IC128.8(C:O) ; also sheet 45
PROD6: IC127.8(C:O) ; also sheet 44
VCC: IC126.14(P:VCC) IC127.14(P:VCC) IC128.14(P:VCC) ; also sheet 1,2,3,4,5,6,7,8,9,10,11,12,13,14,15,16,17,18,20,21,22,23,24,25,26,27,28,29,30,31,32,33,34,37,38,39,40,41,42,43,44,45,46,47

### Notes on the sheet
- CLA_MULT 0 | CLA_MULT 1
- CLA_MULT 6

## Sheet 20 of 48: CLA_MULT 14-11
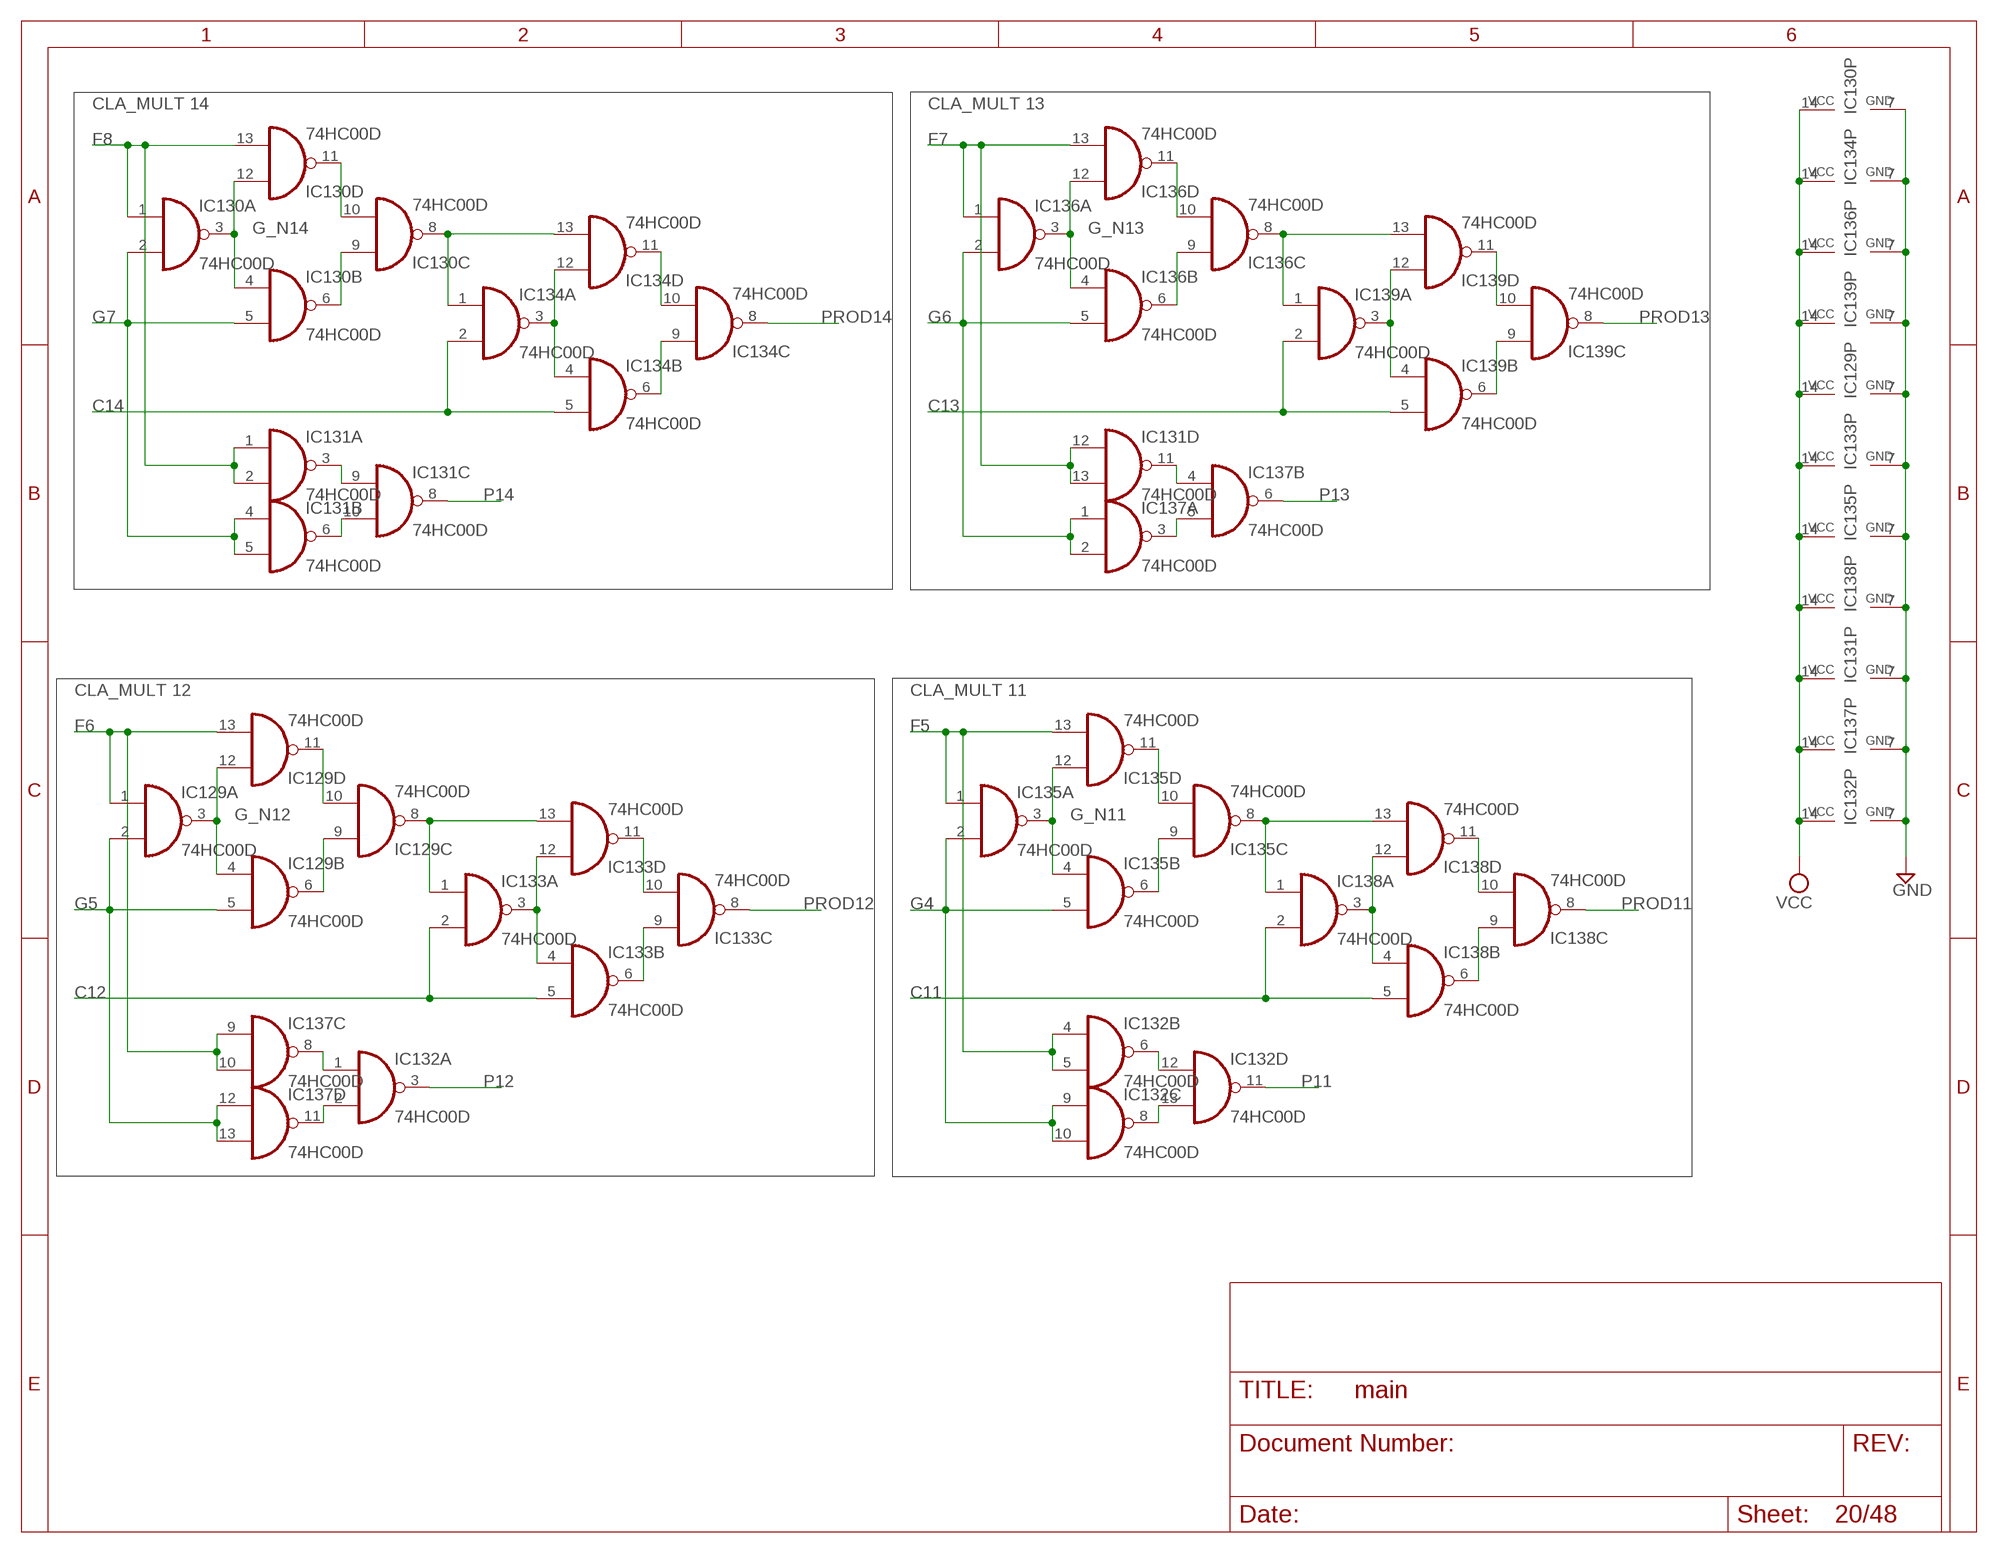
[diagram p19: schematic, sheet 20]

### Parts
IC129  74HC00D  [SO14]
IC130  74HC00D  [SO14]
IC131  74HC00D  [SO14]
IC132  74HC00D  [SO14]
IC133  74HC00D  [SO14]
IC134  74HC00D  [SO14]
IC135  74HC00D  [SO14]
IC136  74HC00D  [SO14]
IC137  74HC00D  [SO14]
IC138  74HC00D  [SO14]
IC139  74HC00D  [SO14]

### Nets
C11: IC138.2(A:I1) IC138.5(B:I1) ; also sheet 23
C12: IC133.2(A:I1) IC133.5(B:I1) ; also sheet 23
C13: IC139.2(A:I1) IC139.5(B:I1) ; also sheet 23
C14: IC134.2(A:I1) IC134.5(B:I1) ; also sheet 23
F5: IC132.4(B:I0) IC132.5(B:I1) IC135.1(A:I0) IC135.13(D:I1) ; also sheet 17
F6: IC129.1(A:I0) IC129.13(D:I1) IC137.9(C:I0) IC137.10(C:I1) ; also sheet 17
F7: IC131.12(D:I0) IC131.13(D:I1) IC136.1(A:I0) IC136.13(D:I1) ; also sheet 17
F8: IC130.1(A:I0) IC130.13(D:I1) IC131.1(A:I0) IC131.2(A:I1) ; also sheet 17
G4: IC132.9(C:I0) IC132.10(C:I1) IC135.2(A:I1) IC135.5(B:I1) ; also sheet 18
G5: IC129.2(A:I1) IC129.5(B:I1) IC137.12(D:I0) IC137.13(D:I1) ; also sheet 17
G6: IC136.2(A:I1) IC136.5(B:I1) IC137.1(A:I0) IC137.2(A:I1) ; also sheet 17
G7: IC130.2(A:I1) IC130.5(B:I1) IC131.4(B:I0) IC131.5(B:I1) ; also sheet 17
G_N11: IC135.3(A:O) IC135.4(B:I0) IC135.12(D:I0) ; also sheet 23
G_N12: IC129.3(A:O) IC129.4(B:I0) IC129.12(D:I0) ; also sheet 23
G_N13: IC136.3(A:O) IC136.4(B:I0) IC136.12(D:I0) ; also sheet 23
G_N14: IC130.3(A:O) IC130.4(B:I0) IC130.12(D:I0) ; also sheet 23
GND: IC129.7(P:GND) IC130.7(P:GND) IC131.7(P:GND) IC132.7(P:GND) IC133.7(P:GND) IC134.7(P:GND) IC135.7(P:GND) IC136.7(P:GND) IC137.7(P:GND) IC138.7(P:GND) IC139.7(P:GND) ; also sheet 1,2,3,4,5,6,7,8,9,10,11,12,13,14,15,16,17,18,19,21,22,23,24,25,26,27,28,29,30,31,32,33,34,37,38,39,40,41,42,43,44,45,46,47
N$408: IC134.6(B:O) IC134.9(C:I0)
N$409: IC134.10(C:I1) IC134.11(D:O)
N$410: IC134.3(A:O) IC134.4(B:I0) IC134.12(D:I0)
N$412: IC130.8(C:O) IC134.1(A:I0) IC134.13(D:I1)
N$413: IC130.6(B:O) IC130.9(C:I0)
N$414: IC130.10(C:I1) IC130.11(D:O)
N$419: IC136.10(C:I1) IC136.11(D:O)
N$420: IC136.6(B:O) IC136.9(C:I0)
N$421: IC136.8(C:O) IC139.1(A:I0) IC139.13(D:I1)
N$422: IC139.3(A:O) IC139.4(B:I0) IC139.12(D:I0)
N$424: IC139.6(B:O) IC139.9(C:I0)
N$425: IC139.10(C:I1) IC139.11(D:O)
N$429: IC133.3(A:O) IC133.4(B:I0) IC133.12(D:I0)
N$431: IC129.8(C:O) IC133.1(A:I0) IC133.13(D:I1)
N$432: IC133.10(C:I1) IC133.11(D:O)
N$433: IC133.6(B:O) IC133.9(C:I0)
N$434: IC129.10(C:I1) IC129.11(D:O)
N$435: IC129.6(B:O) IC129.9(C:I0)
N$440: IC135.6(B:O) IC135.9(C:I0)
N$441: IC135.10(C:I1) IC135.11(D:O)
N$444: IC131.3(A:O) IC131.9(C:I0)
N$445: IC135.8(C:O) IC138.1(A:I0) IC138.13(D:I1)
N$446: IC138.3(A:O) IC138.4(B:I0) IC138.12(D:I0)
N$448: IC138.6(B:O) IC138.9(C:I0)
N$449: IC138.10(C:I1) IC138.11(D:O)
N$453: IC131.6(B:O) IC131.10(C:I1)
N$457: IC137.3(A:O) IC137.5(B:I1)
N$458: IC131.11(D:O) IC137.4(B:I0)
N$461: IC132.2(A:I1) IC137.11(D:O)
N$462: IC132.1(A:I0) IC137.8(C:O)
N$467: IC132.8(C:O) IC132.13(D:I1)
N$468: IC132.6(B:O) IC132.12(D:I0)
P11: IC132.11(D:O) ; also sheet 23
P12: IC132.3(A:O) ; also sheet 23
P13: IC137.6(B:O) ; also sheet 23
P14: IC131.8(C:O) ; also sheet 23
PROD11: IC138.8(C:O)
PROD12: IC133.8(C:O)
PROD13: IC139.8(C:O)
PROD14: IC134.8(C:O)
VCC: IC129.14(P:VCC) IC130.14(P:VCC) IC131.14(P:VCC) IC132.14(P:VCC) IC133.14(P:VCC) IC134.14(P:VCC) IC135.14(P:VCC) IC136.14(P:VCC) IC137.14(P:VCC) IC138.14(P:VCC) IC139.14(P:VCC) ; also sheet 1,2,3,4,5,6,7,8,9,10,11,12,13,14,15,16,17,18,19,21,22,23,24,25,26,27,28,29,30,31,32,33,34,37,38,39,40,41,42,43,44,45,46,47

### Notes on the sheet
- CLA_MULT 14 | CLA_MULT 13
- CLA_MULT 12 | CLA_MULT 11